# EAGLE schematic HFT-Core-Module_1V1 (EAGLE 7.7.0), part 1 of 2
Assembly variants: BAT-Charger_by_MCU

## Sheet 1 of 37: MCU
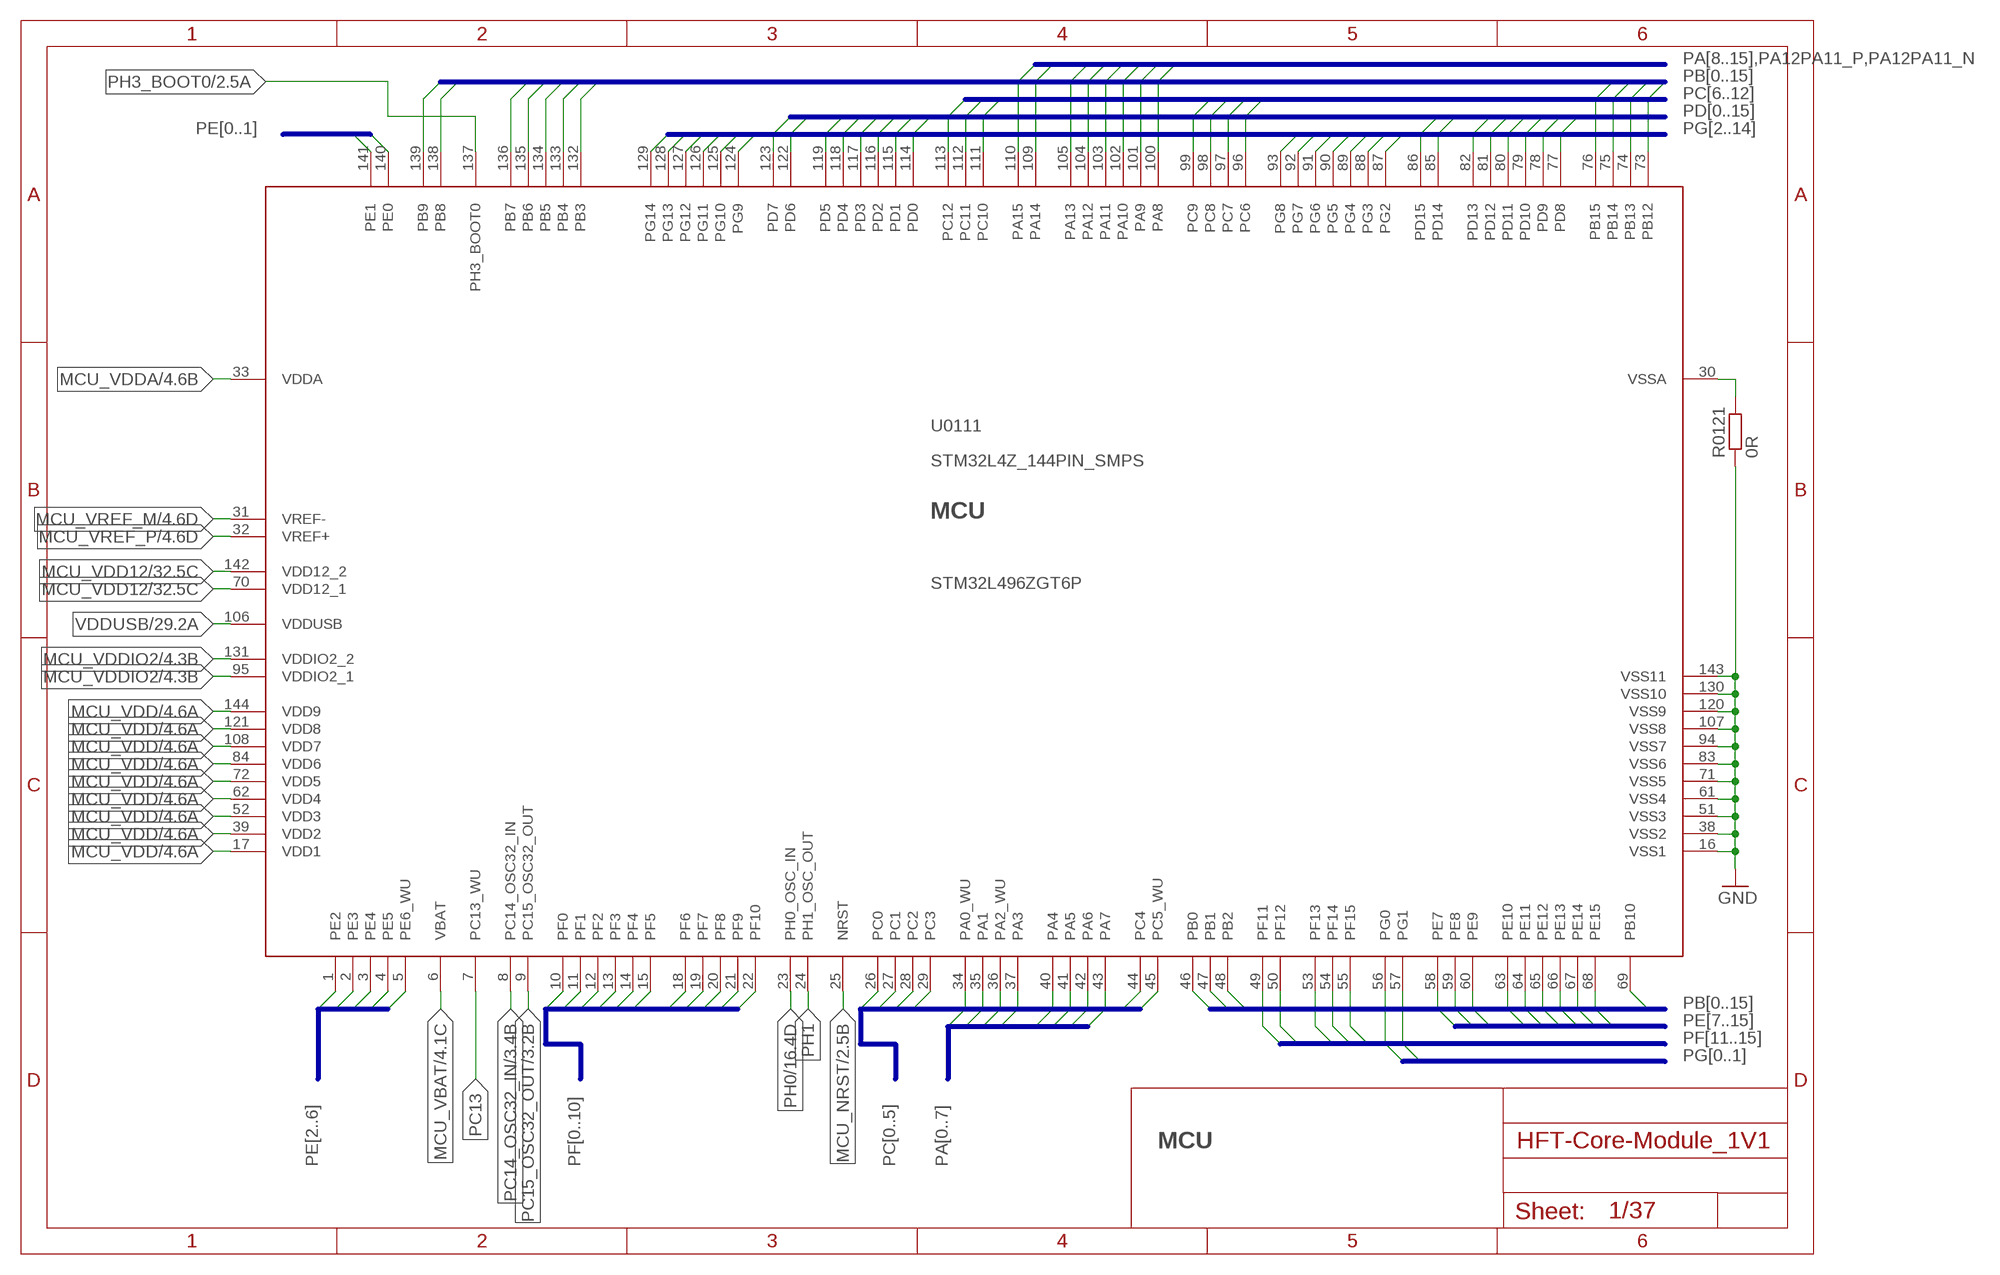
[diagram p0: schematic, sheet 1]

### Parts
R0121  0R  R-EU_R0402  [R0402]
U0111  STM32L4Z_144PIN_SMPS  [LQFP144]

### Nets
GND: R0121.1 U0111.16(VSS1) U0111.38(VSS2) U0111.51(VSS3) U0111.61(VSS4) U0111.71(VSS5) U0111.83(VSS6) U0111.94(VSS7) U0111.107(VSS8) U0111.120(VSS9) U0111.130(VSS10) U0111.143(VSS11) ; also sheet 2,3,4,5,6,7,8,9,10,11,12,13,14,15,16,17,18,19,21,22,23,24,25,26,27,28,29,30,31,32,33,34,35,36,37
MCU_NRST: U0111.25(NRST) ; also sheet 2
MCU_VBAT: U0111.6(VBAT) ; also sheet 4,19
MCU_VDD: U0111.17(VDD1) U0111.39(VDD2) U0111.52(VDD3) U0111.62(VDD4) U0111.72(VDD5) U0111.84(VDD6) U0111.108(VDD7) U0111.121(VDD8) U0111.144(VDD9) ; also sheet 4
MCU_VDD12: U0111.70(VDD12_1) U0111.142(VDD12_2) ; also sheet 32
MCU_VDDA: U0111.33(VDDA) ; also sheet 4
MCU_VDDIO2: U0111.95(VDDIO2_1) U0111.131(VDDIO2_2) ; also sheet 4
MCU_VREF_M: U0111.31(VREF-) ; also sheet 4
MCU_VREF_P: U0111.32(VREF+) ; also sheet 4
MCU_VSSA: R0121.2 U0111.30(VSSA)
PA0: U0111.34(PA0_WU) ; also sheet 26
PA1: U0111.35(PA1) ; also sheet 15
PA2: U0111.36(PA2_WU) ; also sheet 21
PA3: U0111.37(PA3) ; also sheet 25
PA4: U0111.40(PA4)
PA5: U0111.41(PA5) ; also sheet 25
PA6: U0111.42(PA6) ; also sheet 20
PA7: U0111.43(PA7) ; also sheet 11
PA8: U0111.100(PA8) ; also sheet 16
PA9: U0111.101(PA9) ; also sheet 33
PA10: U0111.102(PA10) ; also sheet 33
PA12PA11_N [usb_pair]: U0111.103(PA11) ; also sheet 33
PA12PA11_P [usb_pair]: U0111.104(PA12) ; also sheet 33
PA13: U0111.105(PA13) ; also sheet 2
PA14: U0111.109(PA14) ; also sheet 2
PA15: U0111.110(PA15)
PB0: U0111.46(PB0) ; also sheet 11
PB1: U0111.47(PB1) ; also sheet 21
PB2: U0111.48(PB2)
PB3: U0111.132(PB3) ; also sheet 36
PB4: U0111.133(PB4)
PB5: U0111.134(PB5) ; also sheet 36
PB6: U0111.135(PB6) ; also sheet 36
PB7: U0111.136(PB7) ; also sheet 36
PB8: U0111.138(PB8)
PB9: U0111.139(PB9)
PB10: U0111.69(PB10)
PB12: U0111.73(PB12)
PB13: U0111.74(PB13) ; also sheet 17,36
PB14: U0111.75(PB14)
PB15: U0111.76(PB15) ; also sheet 36
PC0: U0111.26(PC0) ; also sheet 20
PC1: U0111.27(PC1) ; also sheet 7
PC2: U0111.28(PC2) ; also sheet 7
PC3: U0111.29(PC3) ; also sheet 7
PC4: U0111.44(PC4)
PC5: U0111.45(PC5_WU) ; also sheet 13
PC6: U0111.96(PC6) ; also sheet 11
PC7: U0111.97(PC7) ; also sheet 20
PC8: U0111.98(PC8) ; also sheet 9
PC9: U0111.99(PC9) ; also sheet 16
PC10: U0111.111(PC10) ; also sheet 9
PC11: U0111.112(PC11) ; also sheet 13,22,23
PC12: U0111.113(PC12) ; also sheet 9
PC13: U0111.7(PC13_WU) ; also sheet 36
PC14_OSC32_IN: U0111.8(PC14_OSC32_IN) ; also sheet 3
PC15_OSC32_OUT: U0111.9(PC15_OSC32_OUT) ; also sheet 3
PD0: U0111.114(PD0)
PD1: U0111.115(PD1) ; also sheet 36
PD2: U0111.116(PD2) ; also sheet 17
PD3: U0111.117(PD3) ; also sheet 36
PD4: U0111.118(PD4)
PD5: U0111.119(PD5)
PD6: U0111.122(PD6)
PD7: U0111.123(PD7) ; also sheet 7
PD8: U0111.77(PD8) ; also sheet 22
PD9: U0111.78(PD9) ; also sheet 36
PD10: U0111.79(PD10) ; also sheet 36
PD11: U0111.80(PD11) ; also sheet 17,36
PD12: U0111.81(PD12) ; also sheet 17,36
PD13: U0111.82(PD13)
PD14: U0111.85(PD14) ; also sheet 36
PD15: U0111.86(PD15) ; also sheet 36
PE0: U0111.140(PE0)
PE1: U0111.141(PE1)
PE2: U0111.1(PE2)
PE3: U0111.2(PE3) ; also sheet 18,36
PE4: U0111.3(PE4) ; also sheet 26
PE5: U0111.4(PE5) ; also sheet 27
PE6: U0111.5(PE6_WU) ; also sheet 10
PE7: U0111.58(PE7) ; also sheet 23
PE8: U0111.59(PE8) ; also sheet 18,36
PE9: U0111.60(PE9) ; also sheet 18,36
PE10: U0111.63(PE10) ; also sheet 18,36
PE11: U0111.64(PE11) ; also sheet 7
PE12: U0111.65(PE12) ; also sheet 7
PE13: U0111.66(PE13) ; also sheet 7
PE14: U0111.67(PE14) ; also sheet 7
PE15: U0111.68(PE15) ; also sheet 7
PF0: U0111.10(PF0) ; also sheet 36
PF1: U0111.11(PF1) ; also sheet 36
PF2: U0111.12(PF2)
PF3: U0111.13(PF3) ; also sheet 5
PF4: U0111.14(PF4) ; also sheet 6
PF5: U0111.15(PF5) ; also sheet 29
PF6: U0111.18(PF6) ; also sheet 36
PF7: U0111.19(PF7) ; also sheet 26
PF8: U0111.20(PF8) ; also sheet 36
PF9: U0111.21(PF9) ; also sheet 20
PF10: U0111.22(PF10) ; also sheet 7
PF11: U0111.49(PF11) ; also sheet 13
PF12: U0111.50(PF12) ; also sheet 22
PF13: U0111.53(PF13) ; also sheet 13
PF14: U0111.54(PF14) ; also sheet 23
PF15: U0111.55(PF15) ; also sheet 22
PG0: U0111.56(PG0) ; also sheet 22
PG1: U0111.57(PG1) ; also sheet 22
PG2: U0111.87(PG2)
PG3: U0111.88(PG3) ; also sheet 9
PG4: U0111.89(PG4) ; also sheet 36
PG5: U0111.90(PG5) ; also sheet 9
PG6: U0111.91(PG6) ; also sheet 20
PG7: U0111.92(PG7) ; also sheet 21
PG8: U0111.93(PG8) ; also sheet 20
PG9: U0111.124(PG9) ; also sheet 36
PG10: U0111.125(PG10) ; also sheet 36
PG11: U0111.126(PG11) ; also sheet 36
PG12: U0111.127(PG12) ; also sheet 36
PG13: U0111.128(PG13) ; also sheet 8
PG14: U0111.129(PG14) ; also sheet 8
PH0: U0111.23(PH0_OSC_IN) ; also sheet 16
PH1: U0111.24(PH1_OSC_OUT)
PH3_BOOT0: U0111.137(PH3_BOOT0) ; also sheet 2
VDDUSB: U0111.106(VDDUSB) ; also sheet 29,33

### Buses
PF[0..10]
PE[2..6]
PC[0..5]
PA[0..7]
PE[7..15]
PF[11..15]
PG[0..1]
PB[0..15]
PA[8..15],PA12PA11_P,PA12PA11_N
PC[6..12]
PD[0..15]
PE[0..1]
PG[2..14]

### Notes on the sheet
- MCU
- STM32L496ZGT6P
- MCU

## Sheet 2 of 37: MCU Debug
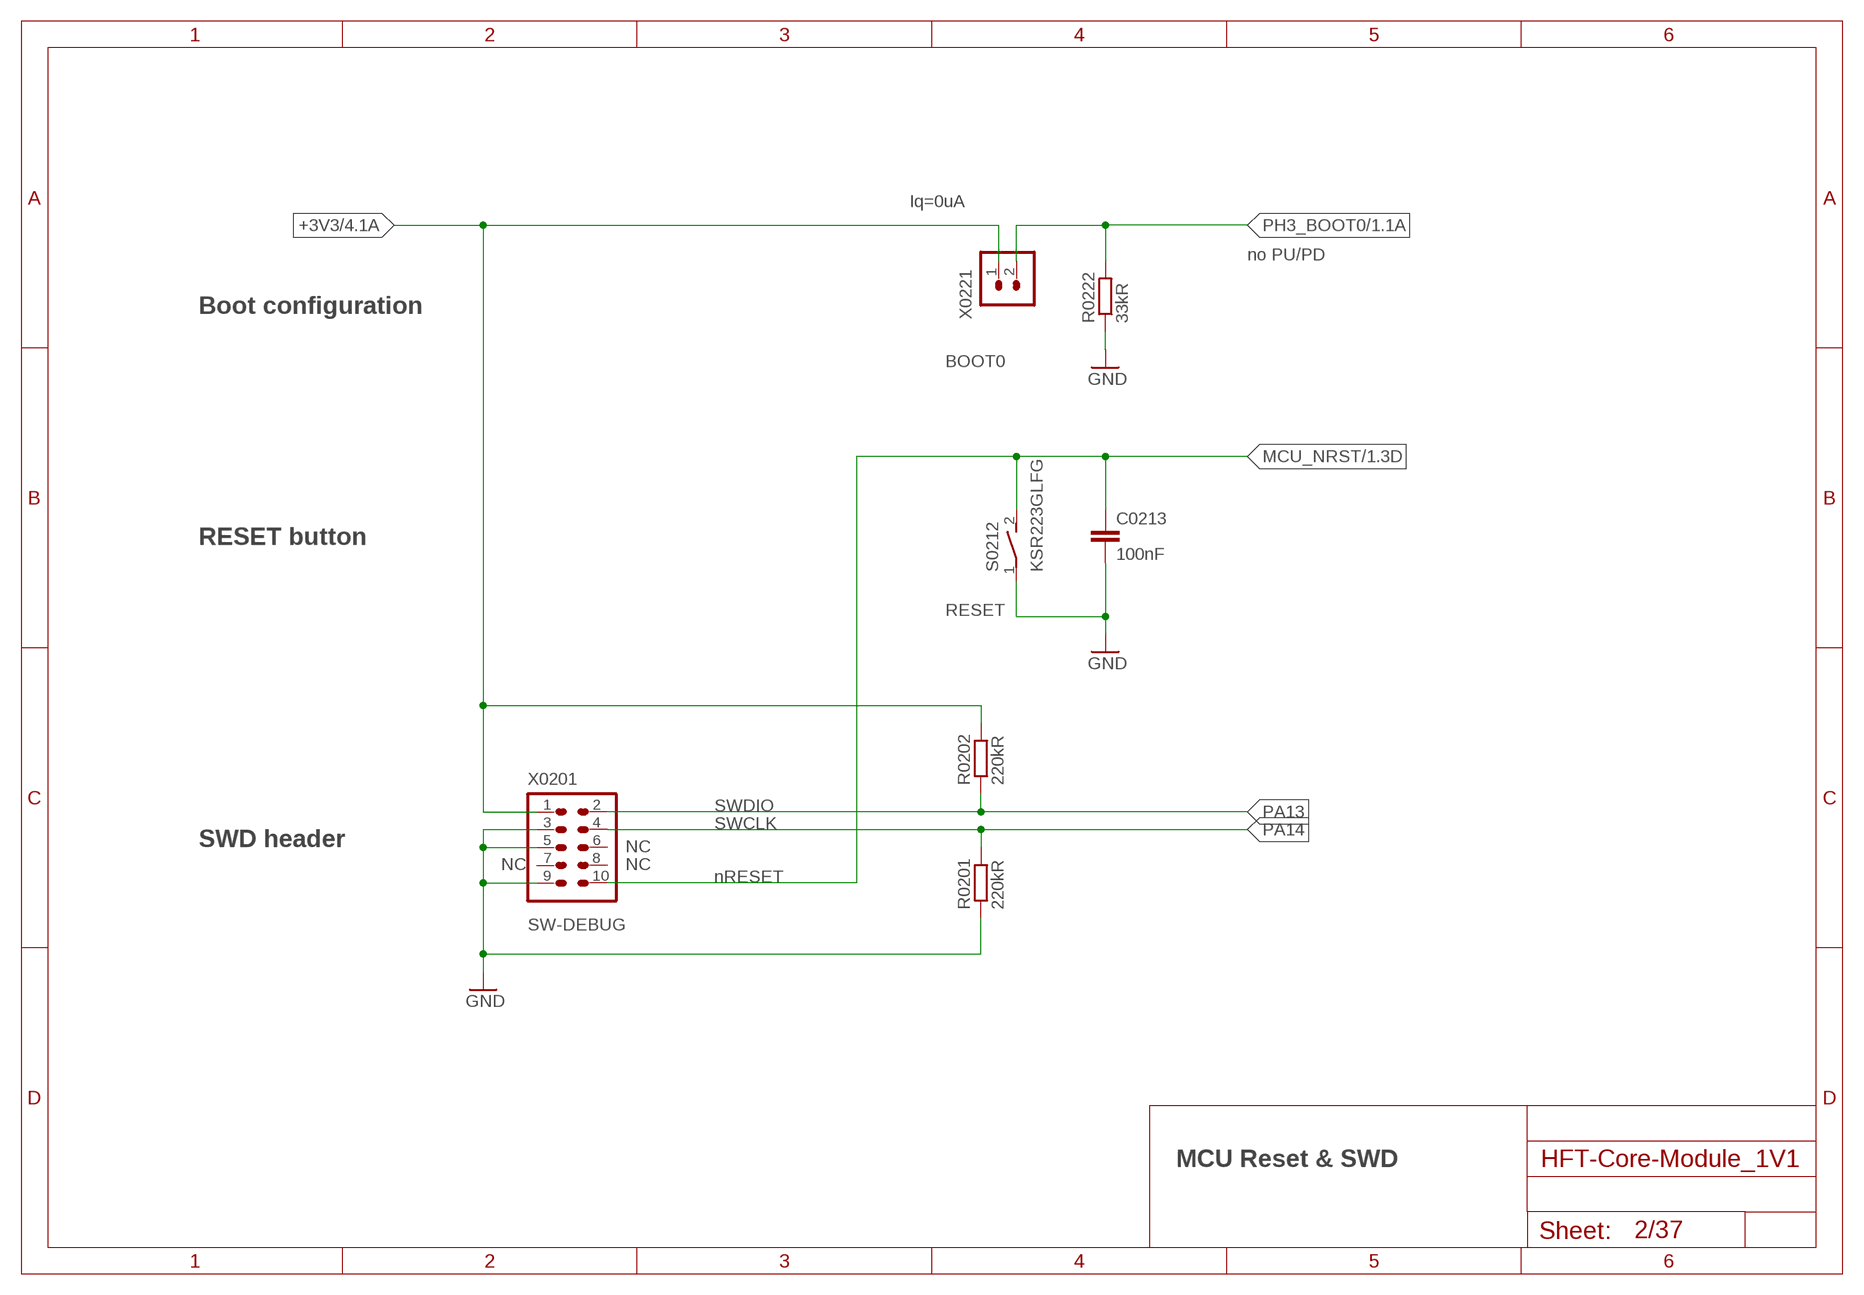
[diagram p1: schematic, sheet 2]

### Parts
C0213  100nF  C-EUC0402  [C0402]
R0201  220kR  R-EU_R0402  [R0402]
R0202  220kR  R-EU_R0402  [R0402]
R0222  33kR  R-EU_R0402  [R0402]
S0212  KSR223GLFG  KSR223G_SMD_1POL  [KSR223G_SMD_1POL]
X0201  2X05_1MM27_SHROUDED_CORTEX_JTAG_SWD"  [2X05_1MM27_SHROUDED_CORTEX_JTAG_SWD]
X0221  HEADER-1X2  [1X02]

### Nets
+3V3: R0202.2 X0201.1 X0221.1 ; also sheet 4,5,6,7,8,9,10,11,13,14,15,22,23,25,26,27,28,30,31,34,36
GND: C0213.2 R0201.1 R0222.1 S0212.1(P) X0201.3 X0201.5 X0201.9 ; also sheet 1,3,4,5,6,7,8,9,10,11,12,13,14,15,16,17,18,19,21,22,23,24,25,26,27,28,29,30,31,32,33,34,35,36,37
MCU_NRST: C0213.1 S0212.2(S) X0201.10 ; also sheet 1
PA13: R0202.1 X0201.2 ; also sheet 1
PA14: R0201.2 X0201.4 ; also sheet 1
PH3_BOOT0: R0222.2 X0221.2 ; also sheet 1
Unconnected: X0201.6 X0201.7 X0201.8

### Notes on the sheet
- Iq=0uA
- no PU/PD
- Boot configuration
- BOOT0
- RESET button
- RESET
- SWDIO
- SWCLK
- SWD header
- NC
- NC | NC
- nRESET
- SW-DEBUG
- MCU Reset & SWD

## Sheet 3 of 37: MCU LSE 32.768 kHz
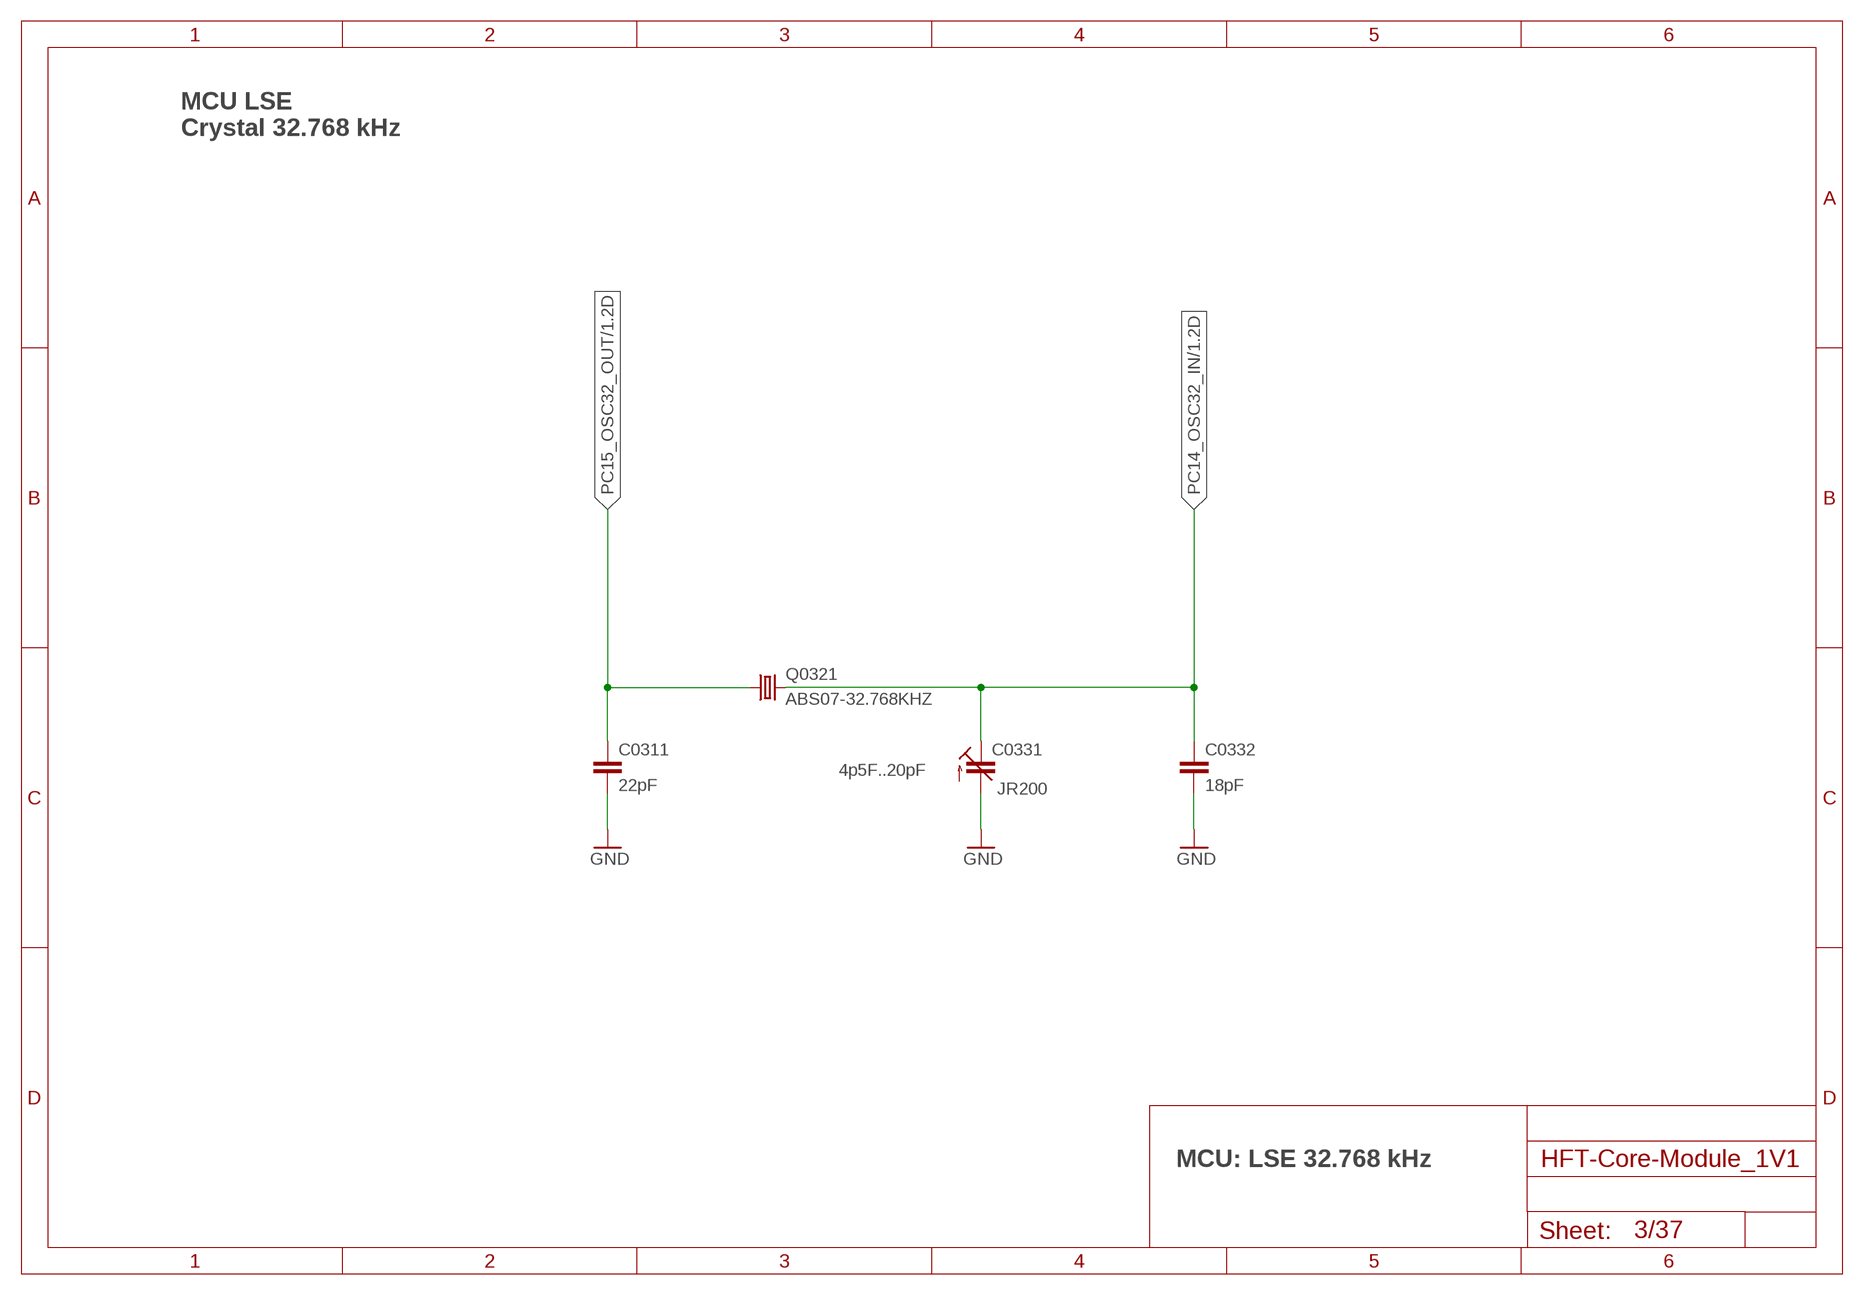
[diagram p2: schematic, sheet 3]

### Parts
C0311  22pF  C-EUC0402  [C0402]
C0331  JR200  C-TRIMM3MM2_2MM5  [3MM2_X_2MM5]
C0332  18pF  C-EUC0402  [C0402]
Q0321  ABS07-32.768KHZ  [ABS07]

### Nets
GND: C0311.2 C0331.+(A) C0332.2 ; also sheet 1,2,4,5,6,7,8,9,10,11,12,13,14,15,16,17,18,19,21,22,23,24,25,26,27,28,29,30,31,32,33,34,35,36,37
PC14_OSC32_IN: C0331.-(E) C0332.1 Q0321.2 ; also sheet 1
PC15_OSC32_OUT: C0311.1 Q0321.1 ; also sheet 1

### Notes on the sheet
- MCU LSE
  Crystal 32.768 kHz
- 4p5F..20pF
- MCU: LSE 32.768 kHz

## Sheet 4 of 37: MCU Power Distribution
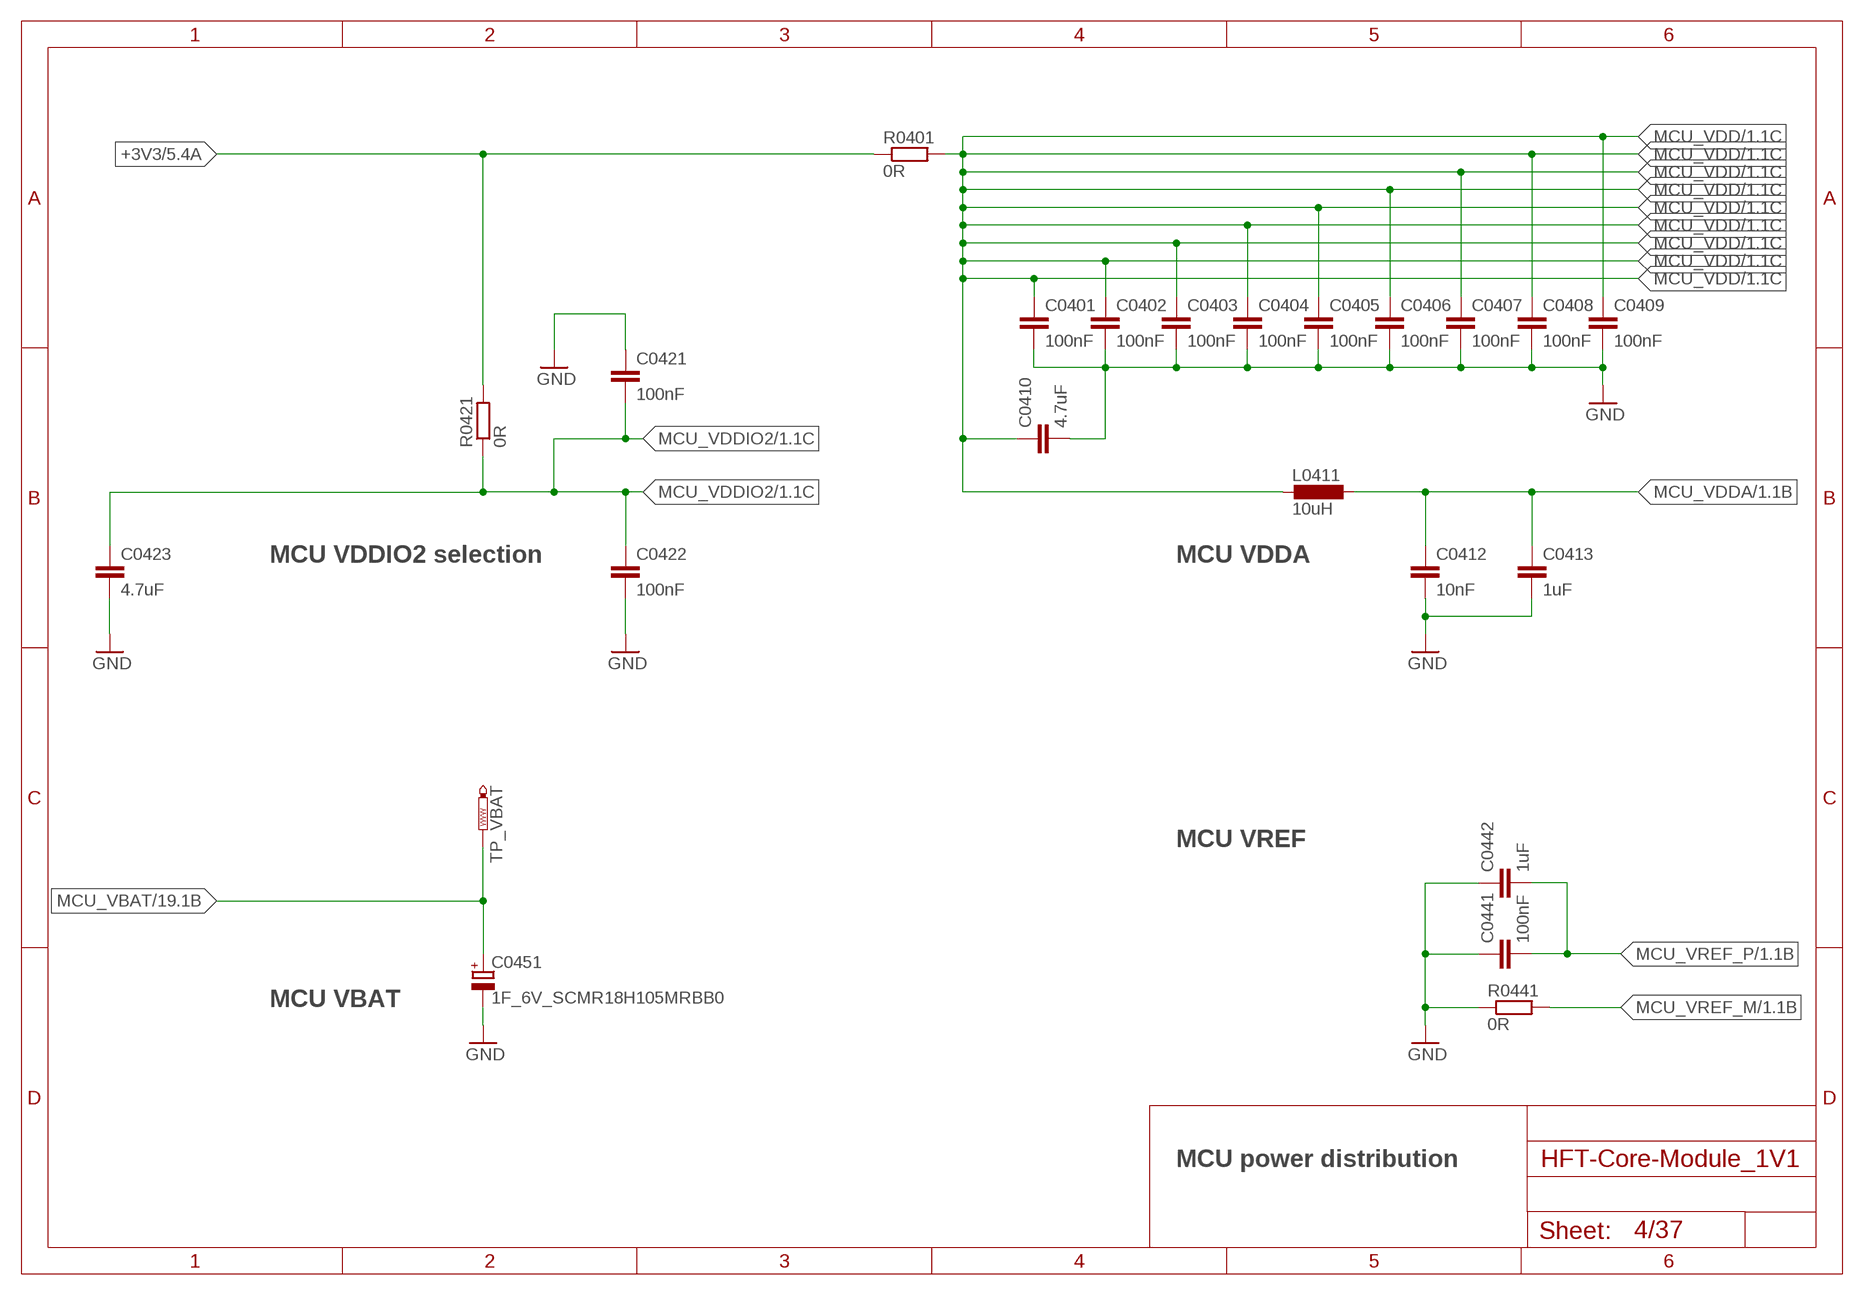
[diagram p3: schematic, sheet 4]

### Parts
C0401  100nF  C-EUC0402  [C0402]
C0402  100nF  C-EUC0402  [C0402]
C0403  100nF  C-EUC0402  [C0402]
C0404  100nF  C-EUC0402  [C0402]
C0405  100nF  C-EUC0402  [C0402]
C0406  100nF  C-EUC0402  [C0402]
C0407  100nF  C-EUC0402  [C0402]
C0408  100nF  C-EUC0402  [C0402]
C0409  100nF  C-EUC0402  [C0402]
C0410  4.7uF  C-EUC0402  [C0402]
C0412  10nF  C-EUC0402  [C0402]
C0413  1uF  C-EUC0402  [C0402]
C0421  100nF  C-EUC0402  [C0402]
C0422  100nF  C-EUC0402  [C0402]
C0423  4.7uF  C-EUC0402  [C0402]
C0441  100nF  C-EUC0402  [C0402]
C0442  1uF  C-EUC0402  [C0402]
C0451  1F_6V_SCMR18H105MRBB0  CPOL-EUC115-080X160_POL  [C115-080X160_POL]
L0411  10uH  L-EUL0603  [L0603]
R0401  0R  R-EU_R0402  [R0402]
R0421  0R  R-EU_R0402  [R0402]
R0441  0R  R-EU_R0402  [R0402]
TP_VBAT  PTR1B1,27  [B1,27]

### Nets
+3V3: R0401.1 R0421.2 ; also sheet 2,5,6,7,8,9,10,11,13,14,15,22,23,25,26,27,28,30,31,34,36
GND: C0401.2 C0402.2 C0403.2 C0404.2 C0405.2 C0406.2 C0407.2 C0408.2 C0409.2 C0410.2 C0412.2 C0413.2 C0421.1 C0422.2 C0423.2 C0441.1 C0442.1 C0451.- R0441.1 ; also sheet 1,2,3,5,6,7,8,9,10,11,12,13,14,15,16,17,18,19,21,22,23,24,25,26,27,28,29,30,31,32,33,34,35,36,37
MCU_VBAT: C0451.+ TP_VBAT.TP ; also sheet 1,19
MCU_VDD: C0401.1 C0402.1 C0403.1 C0404.1 C0405.1 C0406.1 C0407.1 C0408.1 C0409.1 C0410.1 L0411.1 R0401.2 ; also sheet 1
MCU_VDDA: C0412.1 C0413.1 L0411.2 ; also sheet 1
MCU_VDDIO2: C0421.2 C0422.1 C0423.1 R0421.1 ; also sheet 1
MCU_VREF_M: R0441.2 ; also sheet 1
MCU_VREF_P: C0441.2 C0442.2 ; also sheet 1

### Notes on the sheet
- MCU VDDIO2 selection | MCU VDDA
- MCU VREF
- MCU VBAT
- MCU power distribution

## Sheet 5 of 37: I2C1 - Port Expander-A
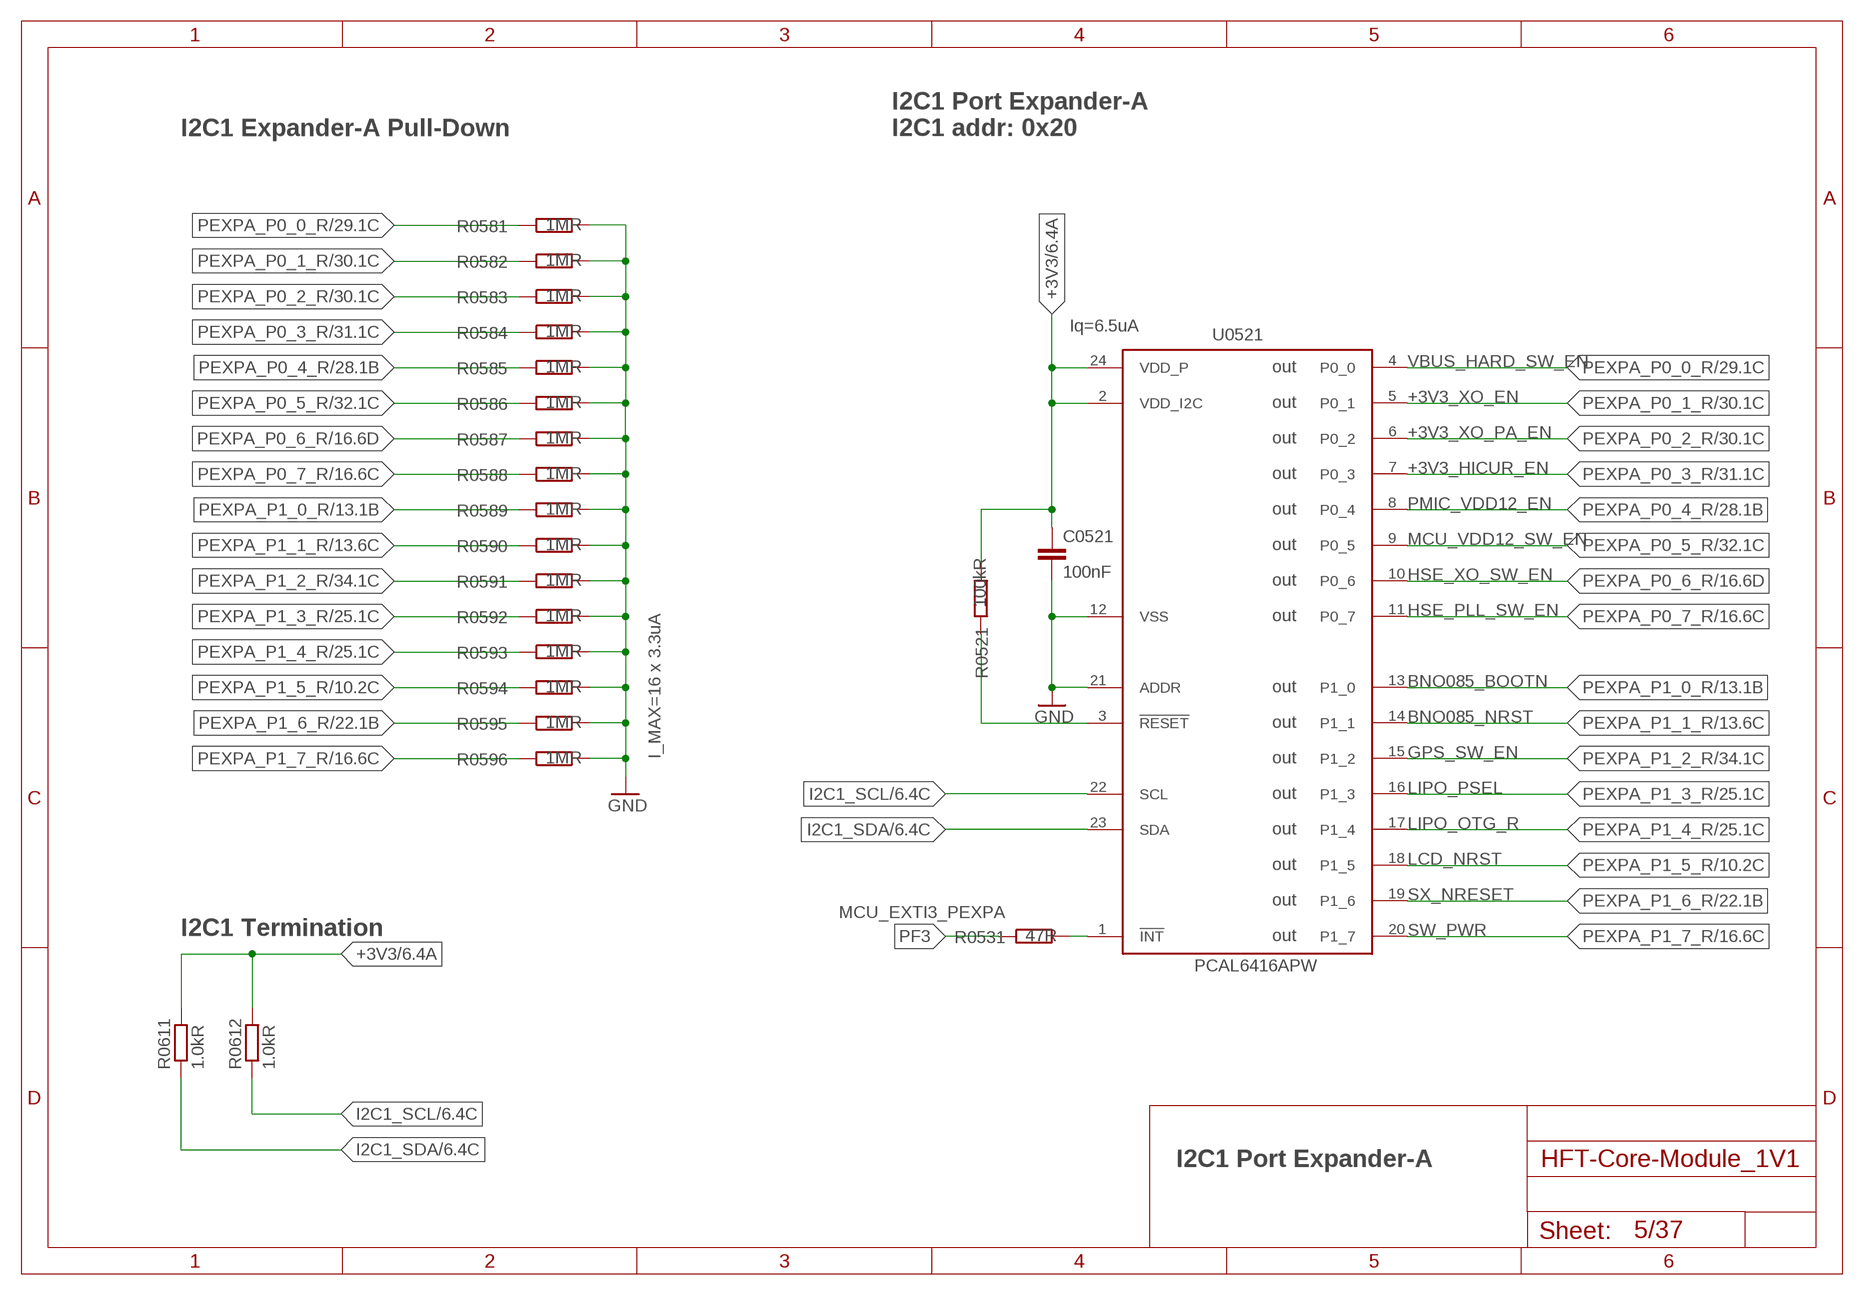
[diagram p4: schematic, sheet 5]

### Parts
C0521  100nF  C-EUC0402  [C0402]
R0521  100kR  R-EU_R0402  [R0402]
R0531  47R  R-EU_R0402  [R0402]
R0581  1MR  R-EU_R0402  [R0402]
R0582  1MR  R-EU_R0402  [R0402]
R0583  1MR  R-EU_R0402  [R0402]
R0584  1MR  R-EU_R0402  [R0402]
R0585  1MR  R-EU_R0402  [R0402]
R0586  1MR  R-EU_R0402  [R0402]
R0587  1MR  R-EU_R0402  [R0402]
R0588  1MR  R-EU_R0402  [R0402]
R0589  1MR  R-EU_R0402  [R0402]
R0590  1MR  R-EU_R0402  [R0402]
R0591  1MR  R-EU_R0402  [R0402]
R0592  1MR  R-EU_R0402  [R0402]
R0593  1MR  R-EU_R0402  [R0402]
R0594  1MR  R-EU_R0402  [R0402]
R0595  1MR  R-EU_R0402  [R0402]
R0596  1MR  R-EU_R0402  [R0402]
R0611  1.0kR  R-EU_R0402  [R0402]
R0612  1.0kR  R-EU_R0402  [R0402]
U0521  PCAL6416APW  [TSSOP24_SOT355-1]

### Nets
+3V3: C0521.1 R0521.2 R0611.2 R0612.2 U0521.2(VDD_I2C) U0521.24(VDD_P) ; also sheet 2,4,6,7,8,9,10,11,13,14,15,22,23,25,26,27,28,30,31,34,36
GND: C0521.2 R0581.2 R0582.2 R0583.2 R0584.2 R0585.2 R0586.2 R0587.2 R0588.2 R0589.2 R0590.2 R0591.2 R0592.2 R0593.2 R0594.2 R0595.2 R0596.2 U0521.12(VSS) U0521.21(ADDR) ; also sheet 1,2,3,4,6,7,8,9,10,11,12,13,14,15,16,17,18,19,21,22,23,24,25,26,27,28,29,30,31,32,33,34,35,36,37
I2C1_SCL: R0612.1 U0521.22(SCL) ; also sheet 6,8,10,14,15,16,17,18,25
I2C1_SDA: R0611.1 U0521.23(SDA) ; also sheet 6,8,10,14,15,16,17,18,25
PEXPA_INTN: R0531.2 U0521.1(!INT)
PEXPA_P0_0_R: R0581.1 U0521.4(P0_0) ; also sheet 29
PEXPA_P0_1_R: R0582.1 U0521.5(P0_1) ; also sheet 30
PEXPA_P0_2_R: R0583.1 U0521.6(P0_2) ; also sheet 30
PEXPA_P0_3_R: R0584.1 U0521.7(P0_3) ; also sheet 31
PEXPA_P0_4_R: R0585.1 U0521.8(P0_4) ; also sheet 28
PEXPA_P0_5_R: R0586.1 U0521.9(P0_5) ; also sheet 32
PEXPA_P0_6_R: R0587.1 U0521.10(P0_6) ; also sheet 16
PEXPA_P0_7_R: R0588.1 U0521.11(P0_7) ; also sheet 16
PEXPA_P1_0_R: R0589.1 U0521.13(P1_0) ; also sheet 13
PEXPA_P1_1_R: R0590.1 U0521.14(P1_1) ; also sheet 13
PEXPA_P1_2_R: R0591.1 U0521.15(P1_2) ; also sheet 34
PEXPA_P1_3_R: R0592.1 U0521.16(P1_3) ; also sheet 25
PEXPA_P1_4_R: R0593.1 U0521.17(P1_4) ; also sheet 25
PEXPA_P1_5_R: R0594.1 U0521.18(P1_5) ; also sheet 10
PEXPA_P1_6_R: R0595.1 U0521.19(P1_6) ; also sheet 22
PEXPA_P1_7_R: R0596.1 U0521.20(P1_7) ; also sheet 16,30,31,32,34
PEXPA_RESET: R0521.1 U0521.3(!RESET)
PF3: R0531.1 ; also sheet 1

### Notes on the sheet
- I2C1 Expander-A Pull-Down
- I2C1 Port Expander-A
  I2C1 addr: 0x20
- Iq=6.5uA
- VBUS_HARD_SW_EN
- out
- +3V3_XO_EN
- out
- +3V3_XO_PA_EN
- out
- +3V3_HICUR_EN
- out
- PMIC_VDD12_EN
- out
- MCU_VDD12_SW_EN
- out
- HSE_XO_SW_EN
- out
- HSE_PLL_SW_EN
- out
- BNO085_BOOTN
- out
- BNO085_NRST
- out
- I_MAX=16 x 3.3uA | GPS_SW_EN
- out
- LIPO_PSEL
- out
- LIPO_OTG_R
- out
- LCD_NRST
- out
- SX_NRESET
- out
- MCU_EXTI3_PEXPA
- I2C1 Termination | SW_PWR
- out
- I2C1 Port Expander-A

## Sheet 6 of 37: I2C1 - Port Expander-B
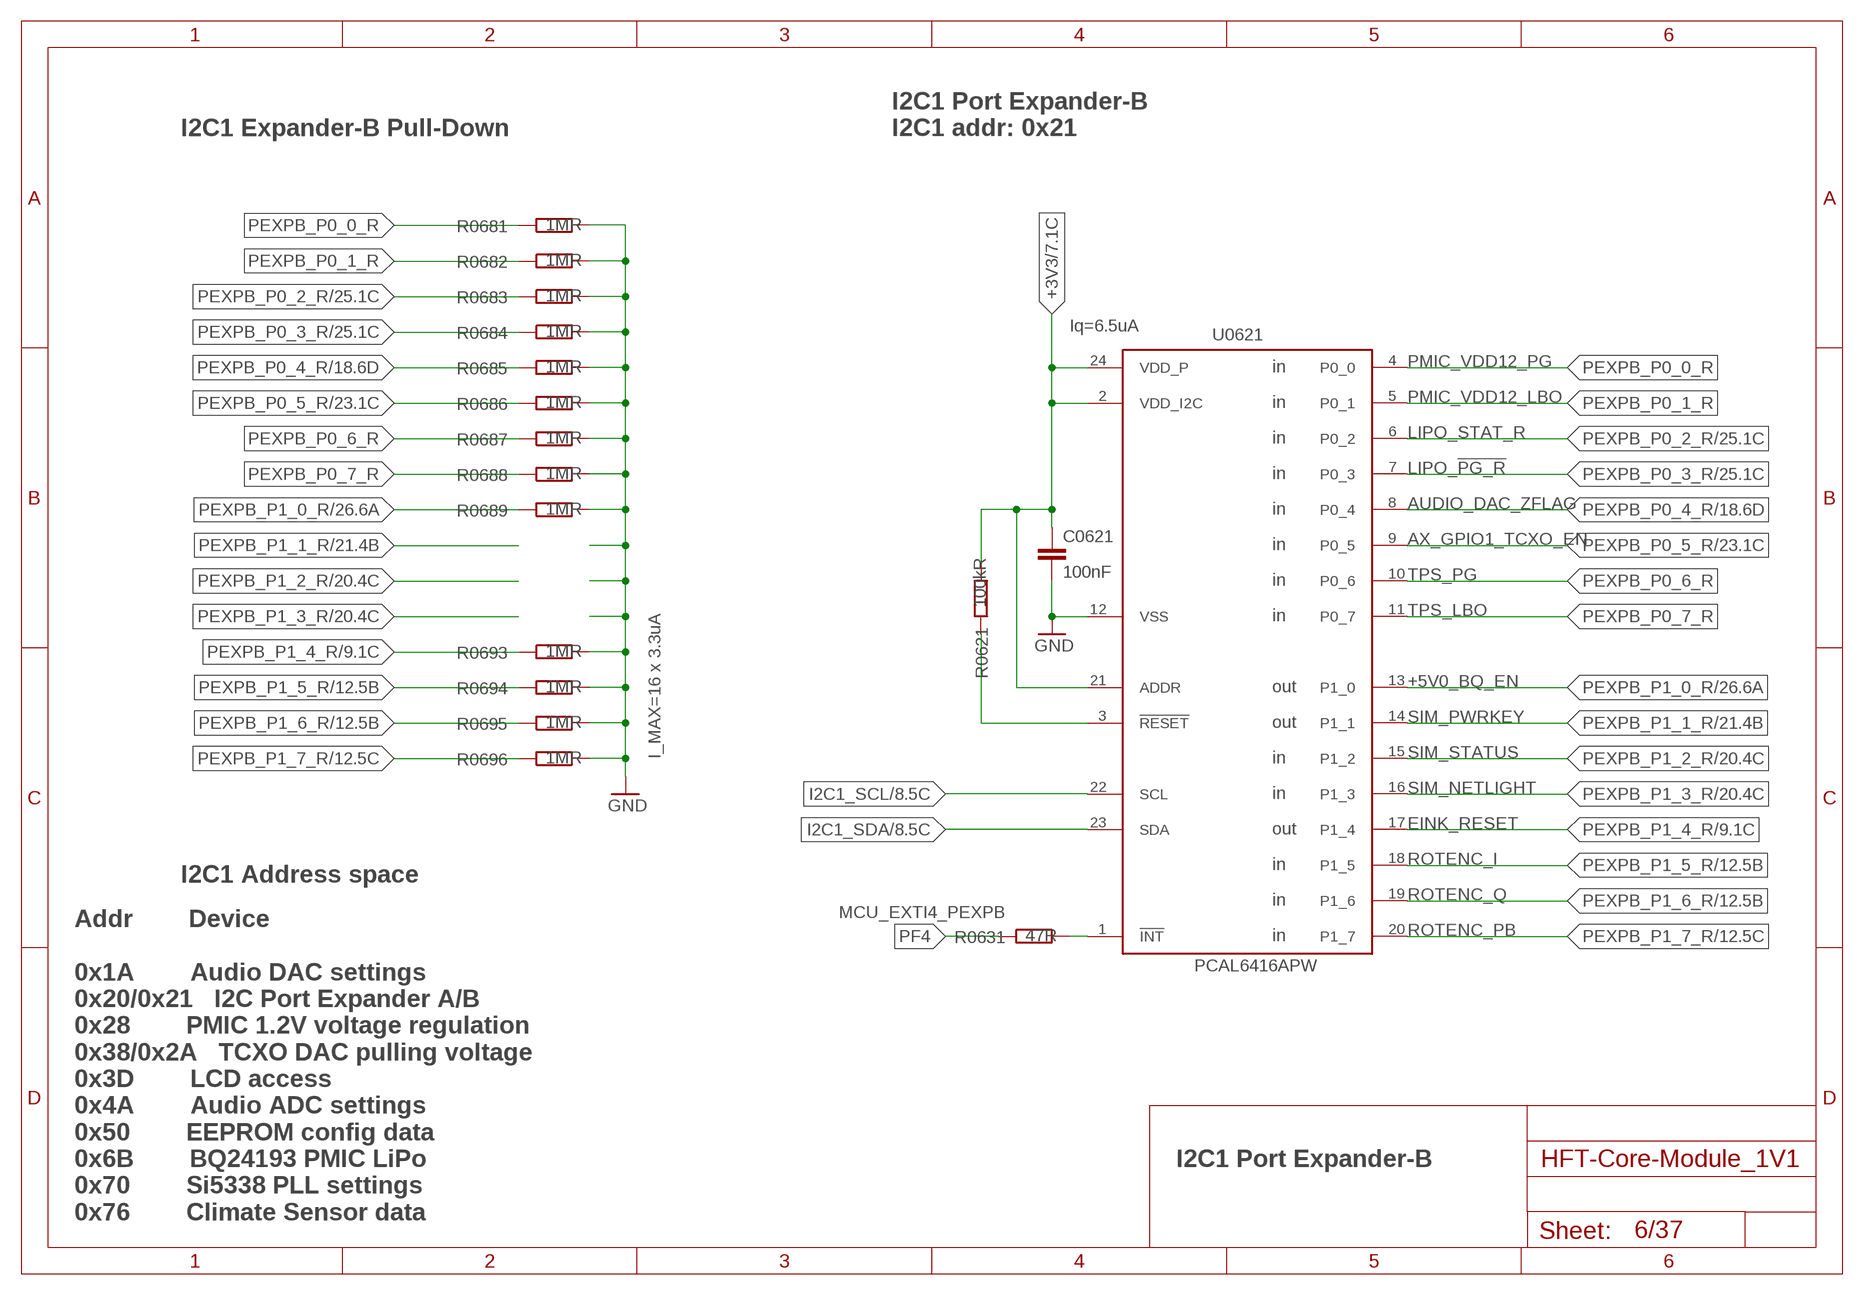
[diagram p5: schematic, sheet 6]

### Parts
C0621  100nF  C-EUC0402  [C0402]
R0621  100kR  R-EU_R0402  [R0402]
R0631  47R  R-EU_R0402  [R0402]
R0681  1MR  R-EU_R0402  [R0402]
R0682  1MR  R-EU_R0402  [R0402]
R0683  1MR  R-EU_R0402  [R0402]
R0684  1MR  R-EU_R0402  [R0402]
R0685  1MR  R-EU_R0402  [R0402]
R0686  1MR  R-EU_R0402  [R0402]
R0687  1MR  R-EU_R0402  [R0402]
R0688  1MR  R-EU_R0402  [R0402]
R0689  1MR  R-EU_R0402  [R0402]
R0693  1MR  R-EU_R0402  [R0402]
R0694  1MR  R-EU_R0402  [R0402]
R0695  1MR  R-EU_R0402  [R0402]
R0696  1MR  R-EU_R0402  [R0402]
U0621  PCAL6416APW  [TSSOP24_SOT355-1]

### Nets
+3V3: C0621.1 R0621.2 U0621.2(VDD_I2C) U0621.21(ADDR) U0621.24(VDD_P) ; also sheet 2,4,5,7,8,9,10,11,13,14,15,22,23,25,26,27,28,30,31,34,36
GND: C0621.2 R0681.2 R0682.2 R0683.2 R0684.2 R0685.2 R0686.2 R0687.2 R0688.2 R0689.2 R0693.2 R0694.2 R0695.2 R0696.2 U0621.12(VSS) ; also sheet 1,2,3,4,5,7,8,9,10,11,12,13,14,15,16,17,18,19,21,22,23,24,25,26,27,28,29,30,31,32,33,34,35,36,37
I2C1_SCL: U0621.22(SCL) ; also sheet 5,8,10,14,15,16,17,18,25
I2C1_SDA: U0621.23(SDA) ; also sheet 5,8,10,14,15,16,17,18,25
PEXPB_INTN: R0631.2 U0621.1(!INT)
PEXPB_P0_0_R: R0681.1 U0621.4(P0_0)
PEXPB_P0_1_R: R0682.1 U0621.5(P0_1)
PEXPB_P0_2_R: R0683.1 U0621.6(P0_2) ; also sheet 25
PEXPB_P0_3_R: R0684.1 U0621.7(P0_3) ; also sheet 25
PEXPB_P0_4_R: R0685.1 U0621.8(P0_4) ; also sheet 18
PEXPB_P0_5_R: R0686.1 U0621.9(P0_5) ; also sheet 23
PEXPB_P0_6_R: R0687.1 U0621.10(P0_6)
PEXPB_P0_7_R: R0688.1 U0621.11(P0_7)
PEXPB_P1_0_R: R0689.1 U0621.13(P1_0) ; also sheet 26
PEXPB_P1_1_R: U0621.14(P1_1) ; also sheet 21
PEXPB_P1_2_R: U0621.15(P1_2) ; also sheet 20
PEXPB_P1_3_R: U0621.16(P1_3) ; also sheet 20
PEXPB_P1_4_R: R0693.1 U0621.17(P1_4) ; also sheet 9
PEXPB_P1_5_R: R0694.1 U0621.18(P1_5) ; also sheet 12
PEXPB_P1_6_R: R0695.1 U0621.19(P1_6) ; also sheet 12
PEXPB_P1_7_R: R0696.1 U0621.20(P1_7) ; also sheet 12
PEXPB_RESET: R0621.1 U0621.3(!RESET)
PF4: R0631.1 ; also sheet 1

### Notes on the sheet
- I2C1 Expander-B Pull-Down
- I2C1 Port Expander-B
  I2C1 addr: 0x21
- Iq=6.5uA
- PMIC_VDD12_PG
- in
- PMIC_VDD12_LBO
- in
- LIPO_STAT_R
- in
- LIPO_!PG_R
- in
- AUDIO_DAC_ZFLAG
- in
- AX_GPIO1_TCXO_EN
- in
- TPS_PG
- in
- TPS_LBO
- in
- +5V0_BQ_EN
- out
- SIM_PWRKEY
- out
- I_MAX=16 x 3.3uA | SIM_STATUS
- in
- SIM_NETLIGHT
- in
- EINK_RESET
- out
- ROTENC_I
- in
- I2C1 Address space
- ROTENC_Q
- in
- MCU_EXTI4_PEXPB
- ROTENC_PB
- in
- I2C1 Port Expander-B
- Addr        Device
  
  0x1A        Audio DAC settings
  0x20/0x21   I2C Port Expander A/B
  0x28        PMIC 1.2V voltage regulation
  0x38/0x2A   TCXO DAC pulling voltage
  0x3D        LCD access
  0x4A        Audio ADC settings
  0x50        EEPROM config data
  0x6B        BQ24193 PMIC LiPo
  0x70        Si5338 PLL settings
  0x76        Climate Sensor data

## Sheet 7 of 37: SPIQ - MCU FLASH
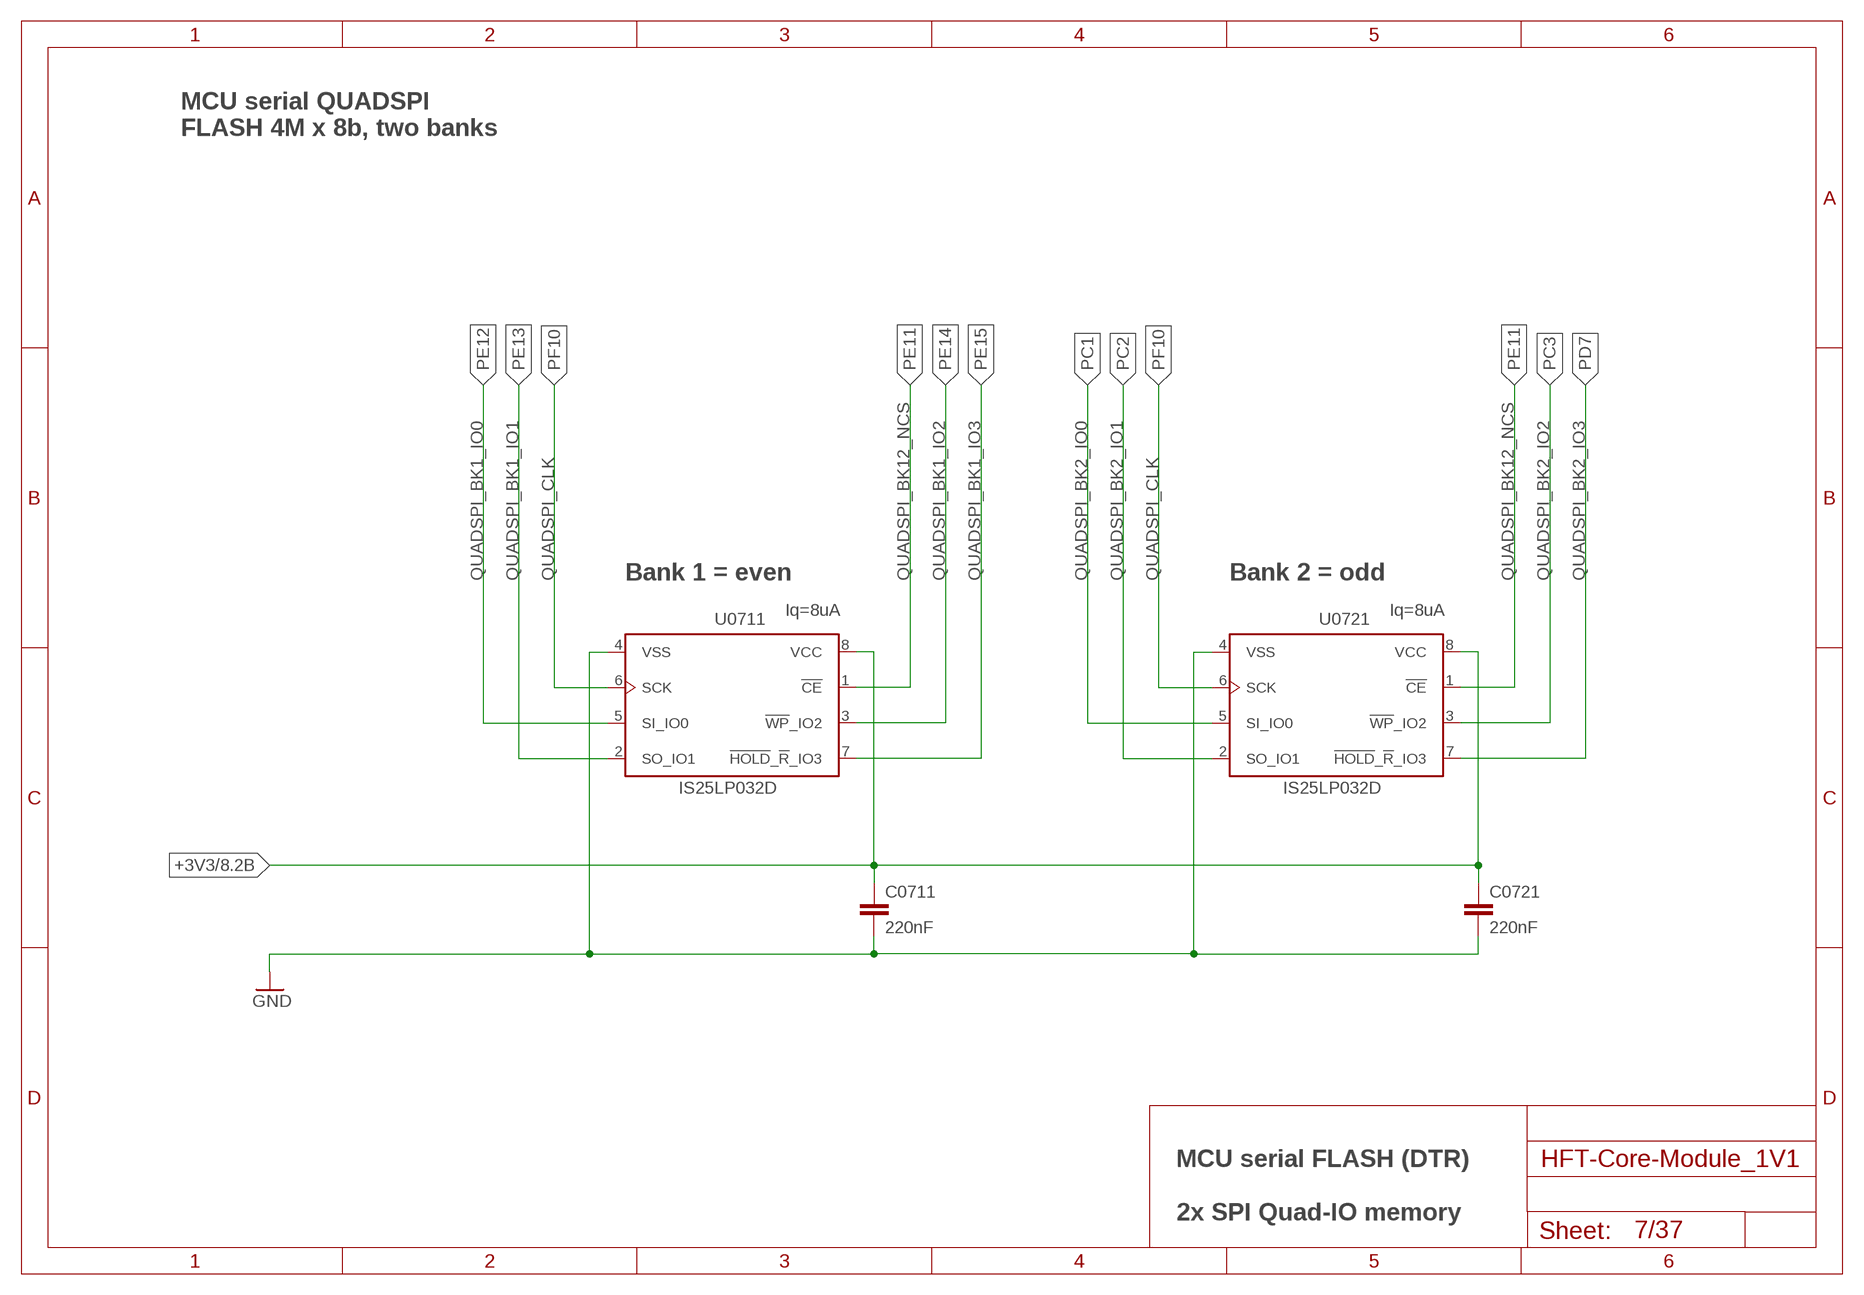
[diagram p6: schematic, sheet 7]

### Parts
C0711  220nF  C-EUC0402  [C0402]
C0721  220nF  C-EUC0402  [C0402]
U0711  IS25LP032D  [SOIC8_150MIL]
U0721  IS25LP032D  [SOIC8_150MIL]

### Nets
+3V3: C0711.1 C0721.1 U0711.8(VCC) U0721.8(VCC) ; also sheet 2,4,5,6,8,9,10,11,13,14,15,22,23,25,26,27,28,30,31,34,36
GND: C0711.2 C0721.2 U0711.4(VSS) U0721.4(VSS) ; also sheet 1,2,3,4,5,6,8,9,10,11,12,13,14,15,16,17,18,19,21,22,23,24,25,26,27,28,29,30,31,32,33,34,35,36,37
PC1: U0721.5(SI_IO0) ; also sheet 1
PC2: U0721.2(SO_IO1) ; also sheet 1
PC3: U0721.3(!WP!_IO2) ; also sheet 1
PD7: U0721.7(!HOLD!_!R!_IO3) ; also sheet 1
PE11: U0711.1(!CE) U0721.1(!CE) ; also sheet 1
PE12: U0711.5(SI_IO0) ; also sheet 1
PE13: U0711.2(SO_IO1) ; also sheet 1
PE14: U0711.3(!WP!_IO2) ; also sheet 1
PE15: U0711.7(!HOLD!_!R!_IO3) ; also sheet 1
PF10: U0711.6(SCK) U0721.6(SCK) ; also sheet 1

### Notes on the sheet
- MCU serial QUADSPI
  FLASH 4M x 8b, two banks
- QUADSPI_BK1_IO0 | QUADSPI_BK1_IO1 | QUADSPI_CLK | Bank 1 = even | QUADSPI_BK12_NCS | QUADSPI_BK1_IO2 | QUADSPI_BK1_IO3 | QUADSPI_BK2_IO0 | QUADSPI_BK2_IO1 | QUADSPI_CLK | Bank 2 = odd | QUADSPI_BK12_NCS | QUADSPI_BK2_IO2 | QUADSPI_BK2_IO3
- Iq=8uA | Iq=8uA
- MCU serial FLASH (DTR)
  
  2x SPI Quad-IO memory

## Sheet 8 of 37: I2C1 - MCU EEPROM 8k x 8Bit
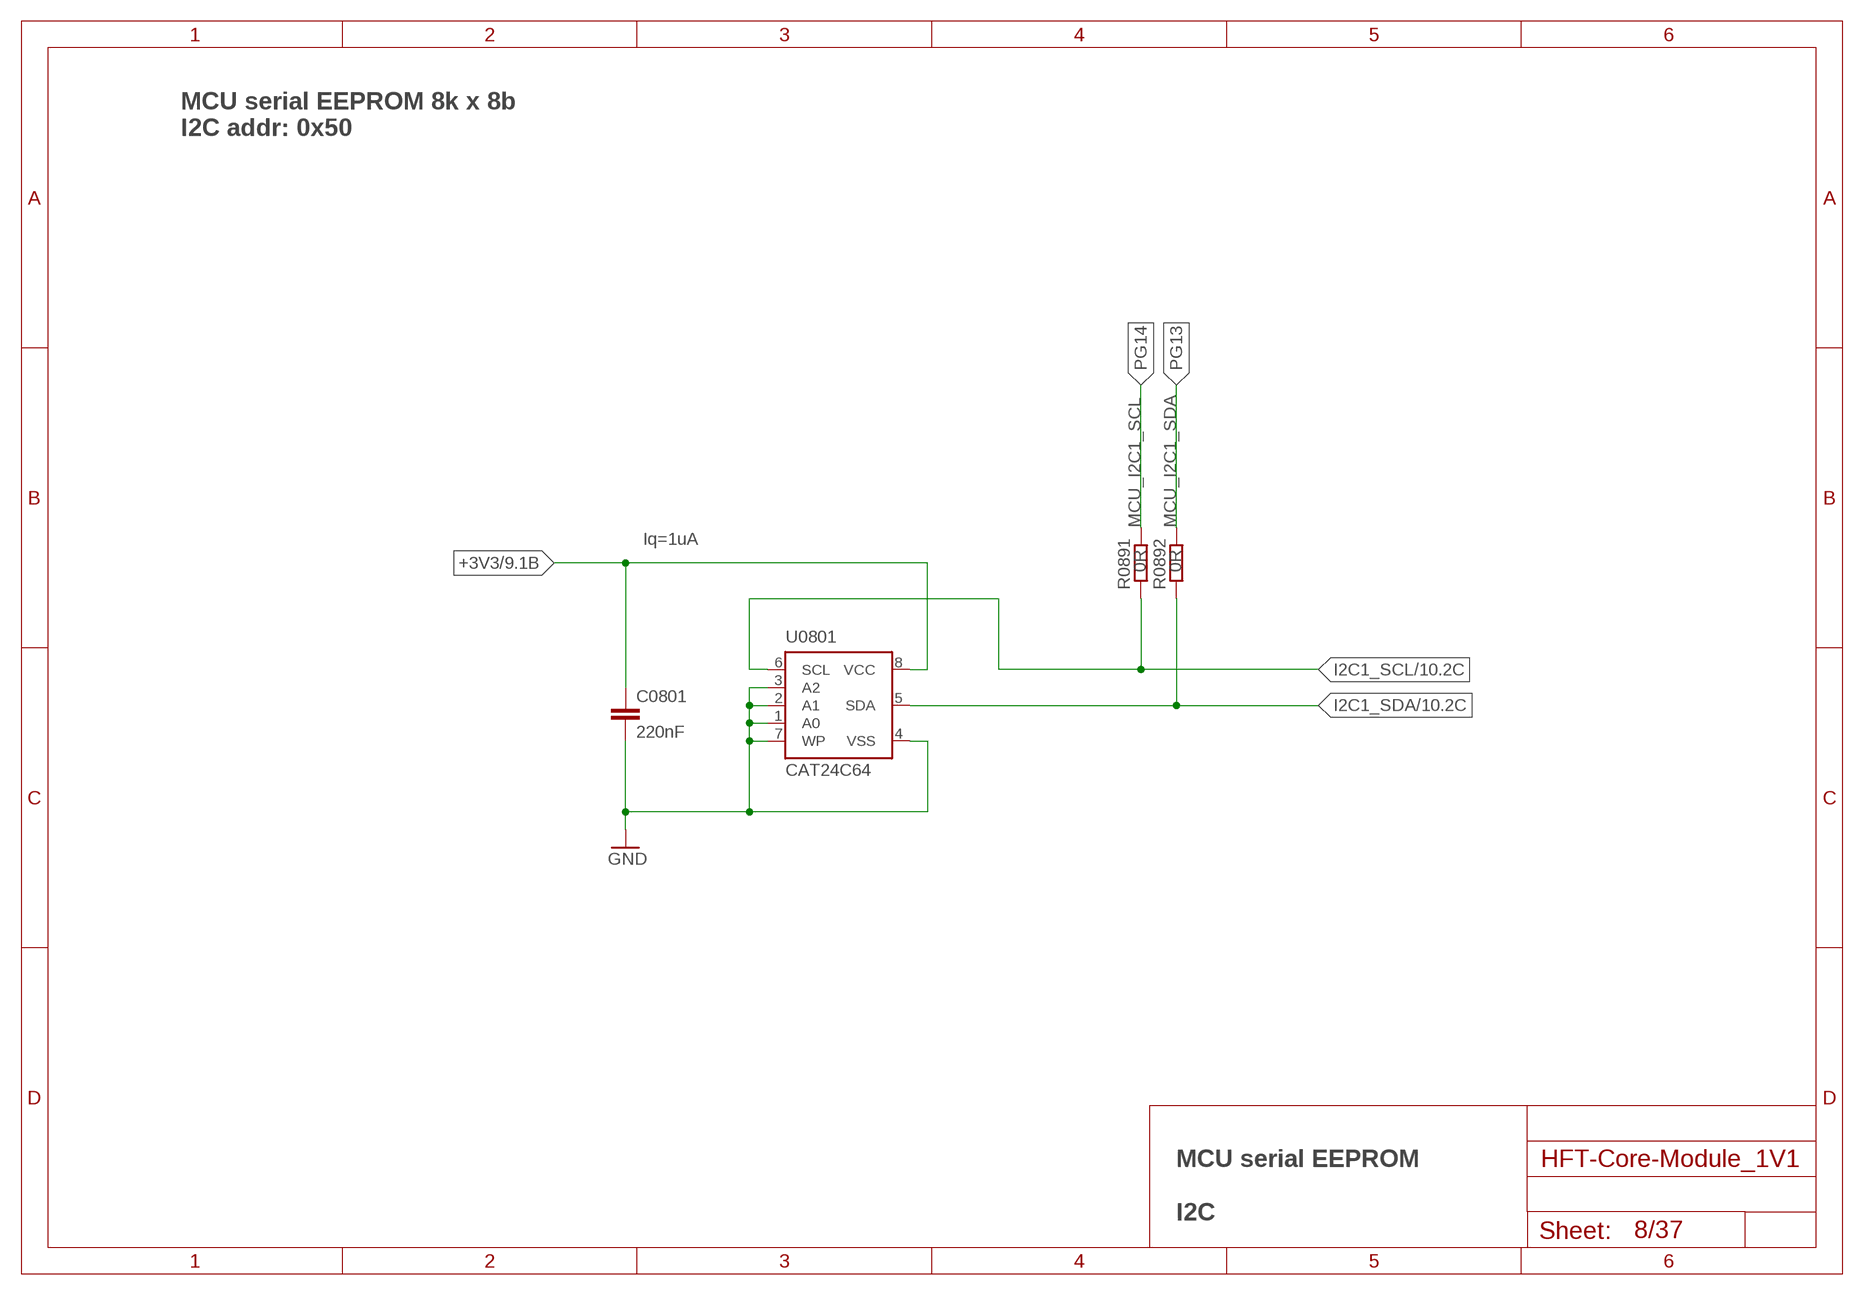
[diagram p7: schematic, sheet 8]

### Parts
C0801  220nF  C-EUC0402  [C0402]
R0891  0R  R-EU_R0402  [R0402]
R0892  0R  R-EU_R0402  [R0402]
U0801  CAT24C64  [SOIC8_150MIL]

### Nets
+3V3: C0801.1 U0801.8(VCC) ; also sheet 2,4,5,6,7,9,10,11,13,14,15,22,23,25,26,27,28,30,31,34,36
GND: C0801.2 U0801.1(A0) U0801.2(A1) U0801.3(A2) U0801.4(VSS) U0801.7(WP) ; also sheet 1,2,3,4,5,6,7,9,10,11,12,13,14,15,16,17,18,19,21,22,23,24,25,26,27,28,29,30,31,32,33,34,35,36,37
I2C1_SCL: R0891.1 U0801.6(SCL) ; also sheet 5,6,10,14,15,16,17,18,25
I2C1_SDA: R0892.1 U0801.5(SDA) ; also sheet 5,6,10,14,15,16,17,18,25
PG13: R0892.2 ; also sheet 1
PG14: R0891.2 ; also sheet 1

### Notes on the sheet
- MCU serial EEPROM 8k x 8b
  I2C addr: 0x50
- MCU_I2C1_SCL | MCU_I2C1_SDA
- Iq=1uA
- MCU serial EEPROM
  
  I2C

## Sheet 9 of 37: SPI3 - E-Ink-Display
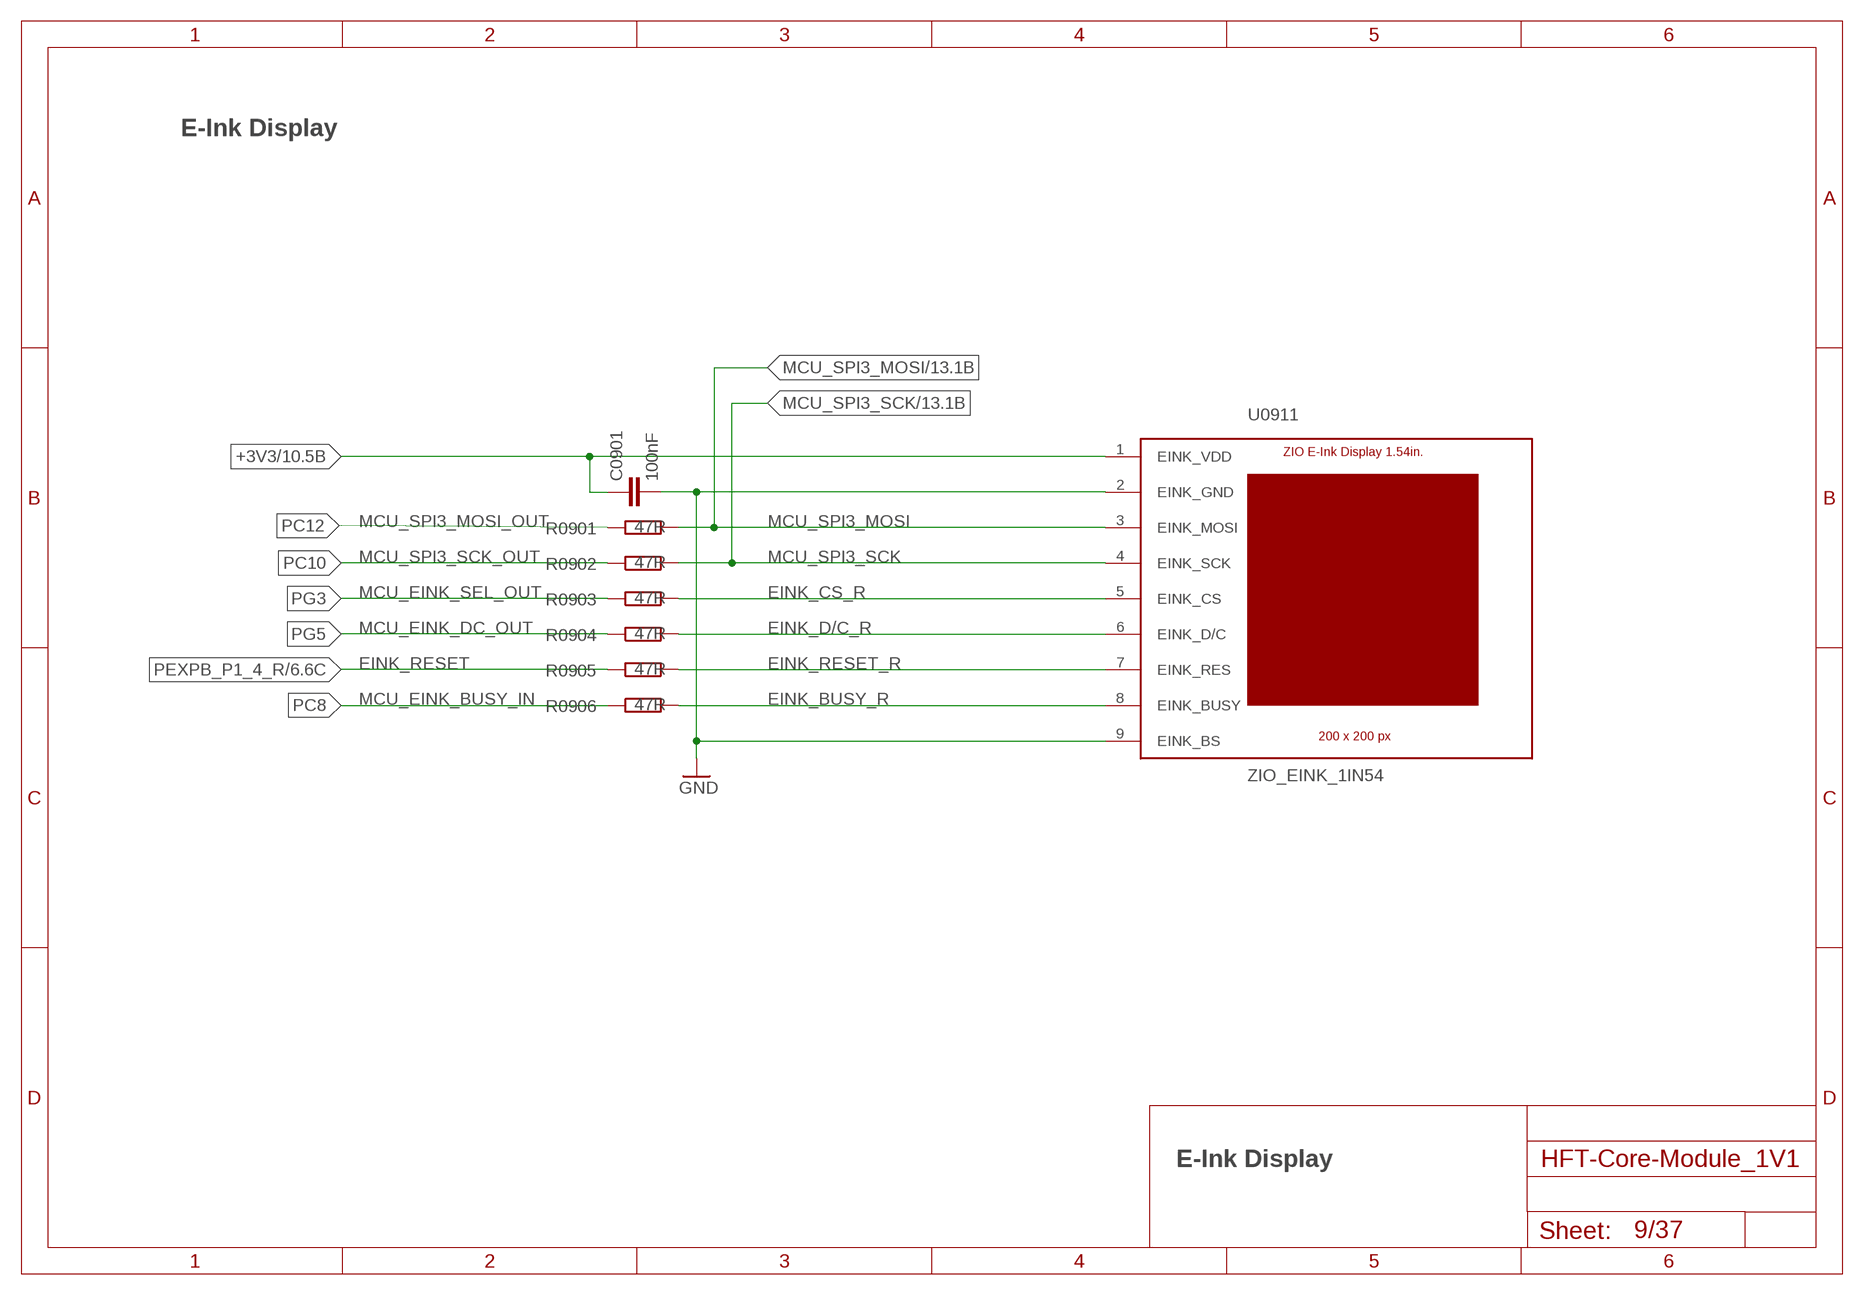
[diagram p8: schematic, sheet 9]

### Parts
C0901  100nF  C-EUC0402  [C0402]
R0901  47R  R-EU_R0402  [R0402]
R0902  47R  R-EU_R0402  [R0402]
R0903  47R  R-EU_R0402  [R0402]
R0904  47R  R-EU_R0402  [R0402]
R0905  47R  R-EU_R0402  [R0402]
R0906  47R  R-EU_R0402  [R0402]
U0911  ZIO_EINK_1IN54  [ZIO_EINK_1IN54]

### Nets
+3V3: C0901.1 U0911.1(EINK_VDD) ; also sheet 2,4,5,6,7,8,10,11,13,14,15,22,23,25,26,27,28,30,31,34,36
EINK_BUSY_R: R0906.2 U0911.8(EINK_BUSY)
EINK_CS_R: R0903.2 U0911.5(EINK_CS)
EINK_D/C_R: R0904.2 U0911.6(EINK_D/C)
EINK_RESET_R: R0905.2 U0911.7(EINK_RES)
GND: C0901.2 U0911.2(EINK_GND) U0911.9(EINK_BS) ; also sheet 1,2,3,4,5,6,7,8,10,11,12,13,14,15,16,17,18,19,21,22,23,24,25,26,27,28,29,30,31,32,33,34,35,36,37
MCU_SPI3_MOSI: R0901.2 U0911.3(EINK_MOSI) ; also sheet 13,22,23
MCU_SPI3_SCK: R0902.2 U0911.4(EINK_SCK) ; also sheet 13,22,23
PC8: R0906.1 ; also sheet 1
PC10: R0902.1 ; also sheet 1
PC12: R0901.1 ; also sheet 1
PEXPB_P1_4_R: R0905.1 ; also sheet 6
PG3: R0903.1 ; also sheet 1
PG5: R0904.1 ; also sheet 1

### Notes on the sheet
- E-Ink Display
- MCU_SPI3_MOSI_OUT | MCU_SPI3_MOSI
- MCU_SPI3_SCK_OUT | MCU_SPI3_SCK
- MCU_EINK_SEL_OUT
- MCU_EINK_DC_OUT
- EINK_RESET
- MCU_EINK_BUSY_IN
- E-Ink Display

## Sheet 10 of 37: I2C1 - LCD
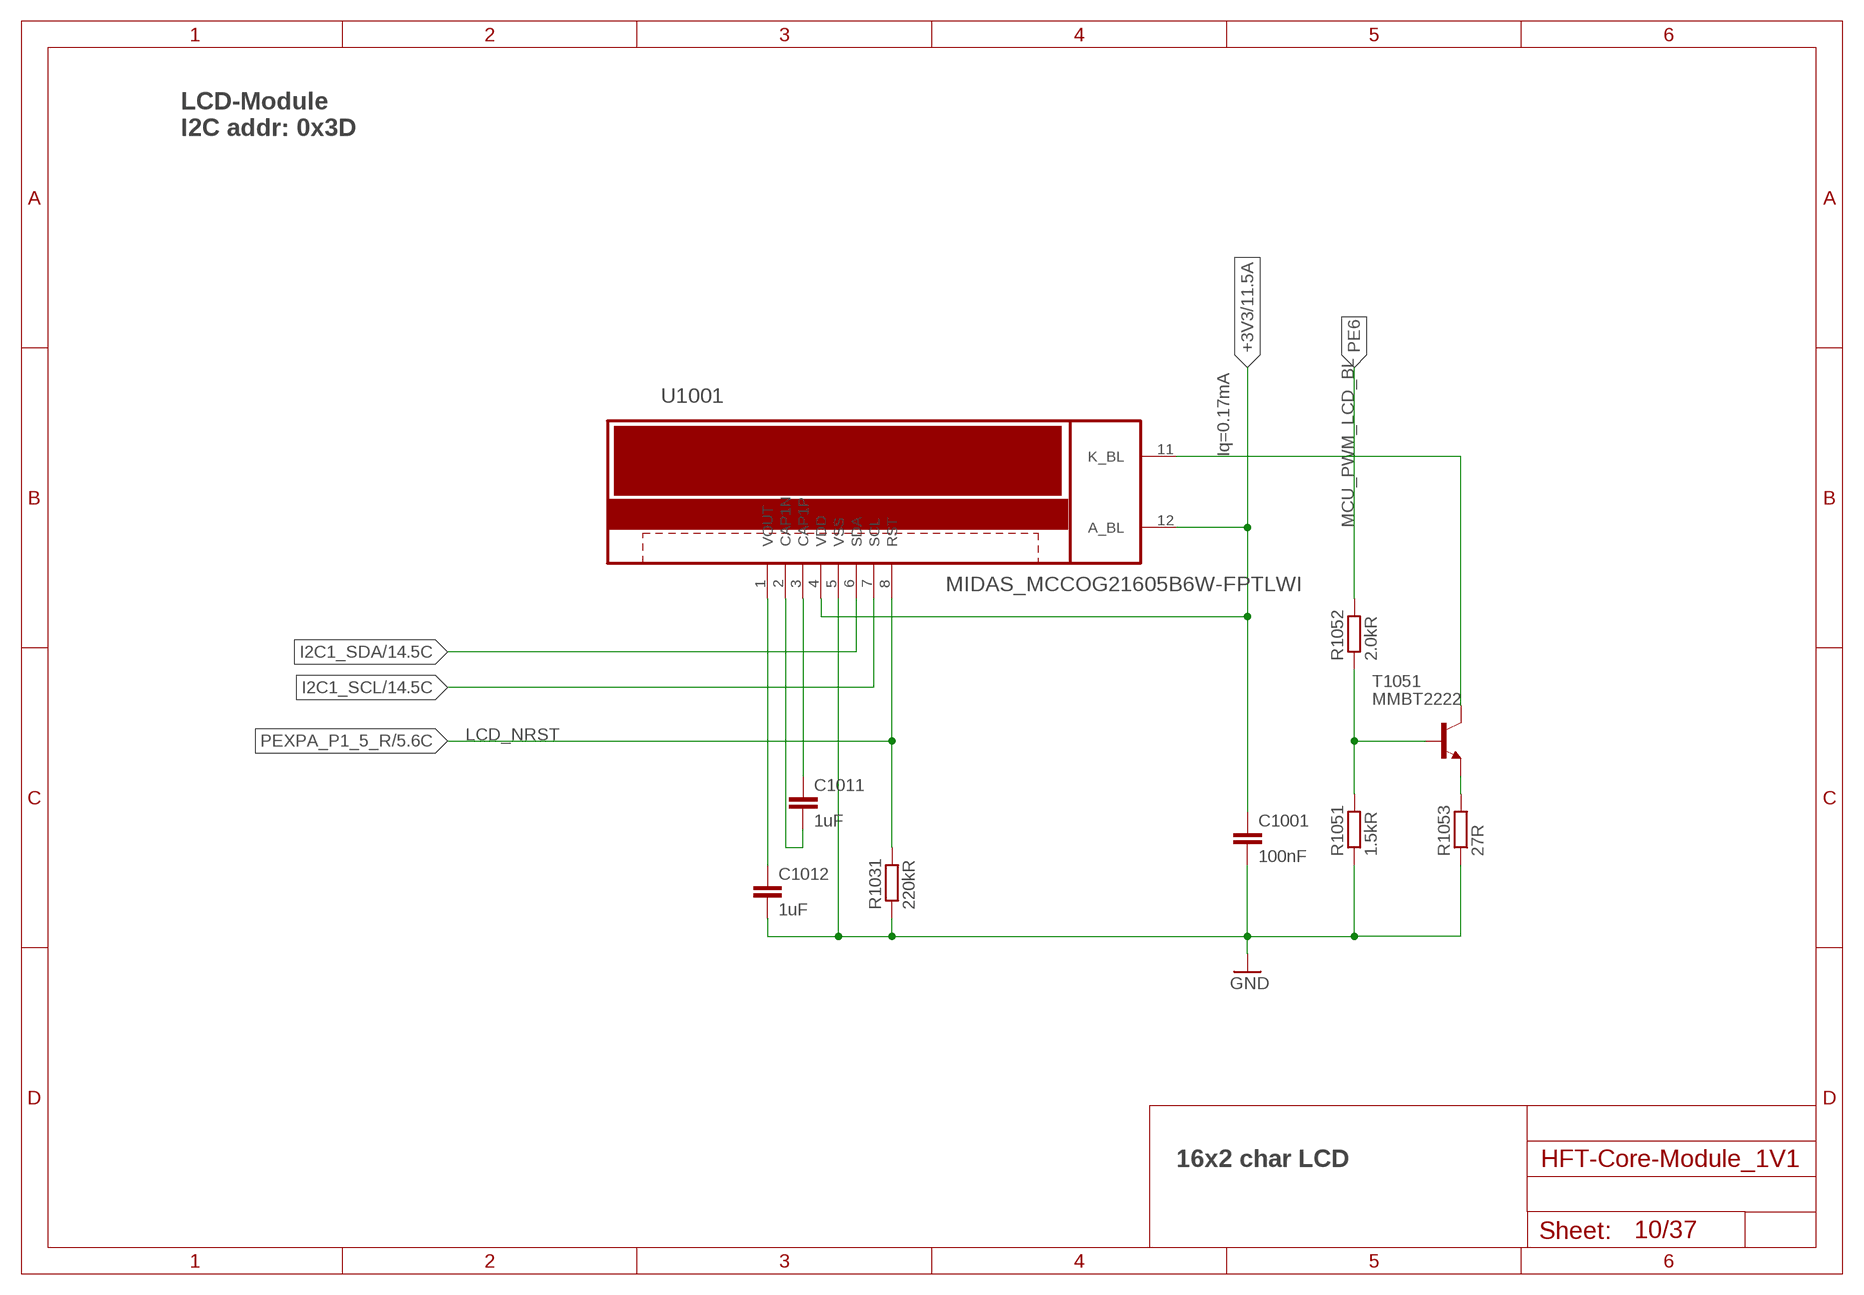
[diagram p9: schematic, sheet 10]

### Parts
C1001  100nF  C-EUC0402  [C0402]
C1011  1uF  C-EUC0402  [C0402]
C1012  1uF  C-EUC0402  [C0402]
R1031  220kR  R-EU_R0402  [R0402]
R1051  1.5kR  R-EU_R0402  [R0402]
R1052  2.0kR  R-EU_R0402  [R0402]
R1053  27R  R-EU_R0402  [R0402]
T1051  MMBT2222  BC846  [SOT23]
U1001  MIDAS_MCCOG21605B6W-FPTLWI  [MIDAS_MCCOG21605B6W-FPTLWI]

### Nets
+3V3: C1001.1 U1001.4(VDD) U1001.12(A_BL) ; also sheet 2,4,5,6,7,8,9,11,13,14,15,22,23,25,26,27,28,30,31,34,36
GND: C1001.2 C1012.2 R1031.1 R1051.1 R1053.1 U1001.5(VSS) ; also sheet 1,2,3,4,5,6,7,8,9,11,12,13,14,15,16,17,18,19,21,22,23,24,25,26,27,28,29,30,31,32,33,34,35,36,37
I2C1_SCL: U1001.7(SCL) ; also sheet 5,6,8,14,15,16,17,18,25
I2C1_SDA: U1001.6(SDA) ; also sheet 5,6,8,14,15,16,17,18,25
LCD_BL_K: T1051.3(C) U1001.11(K_BL)
LCD_CAP1N: C1011.2 U1001.2(CAP1N)
LCD_CAP1P: C1011.1 U1001.3(CAP1P)
LCD_VOUT: C1012.1 U1001.1(VOUT)
LED_B_B: R1051.2 R1052.1 T1051.1(B)
LED_B_E: R1053.2 T1051.2(E)
PE6: R1052.2 ; also sheet 1
PEXPA_P1_5_R: R1031.2 U1001.8(RST) ; also sheet 5

### Notes on the sheet
- LCD-Module
  I2C addr: 0x3D
- Iq=0.17mA
- MCU_PWM_LCD_BL
- LCD_NRST
- 16x2 char LCD

## Sheet 11 of 37: PWM - RGB-LED
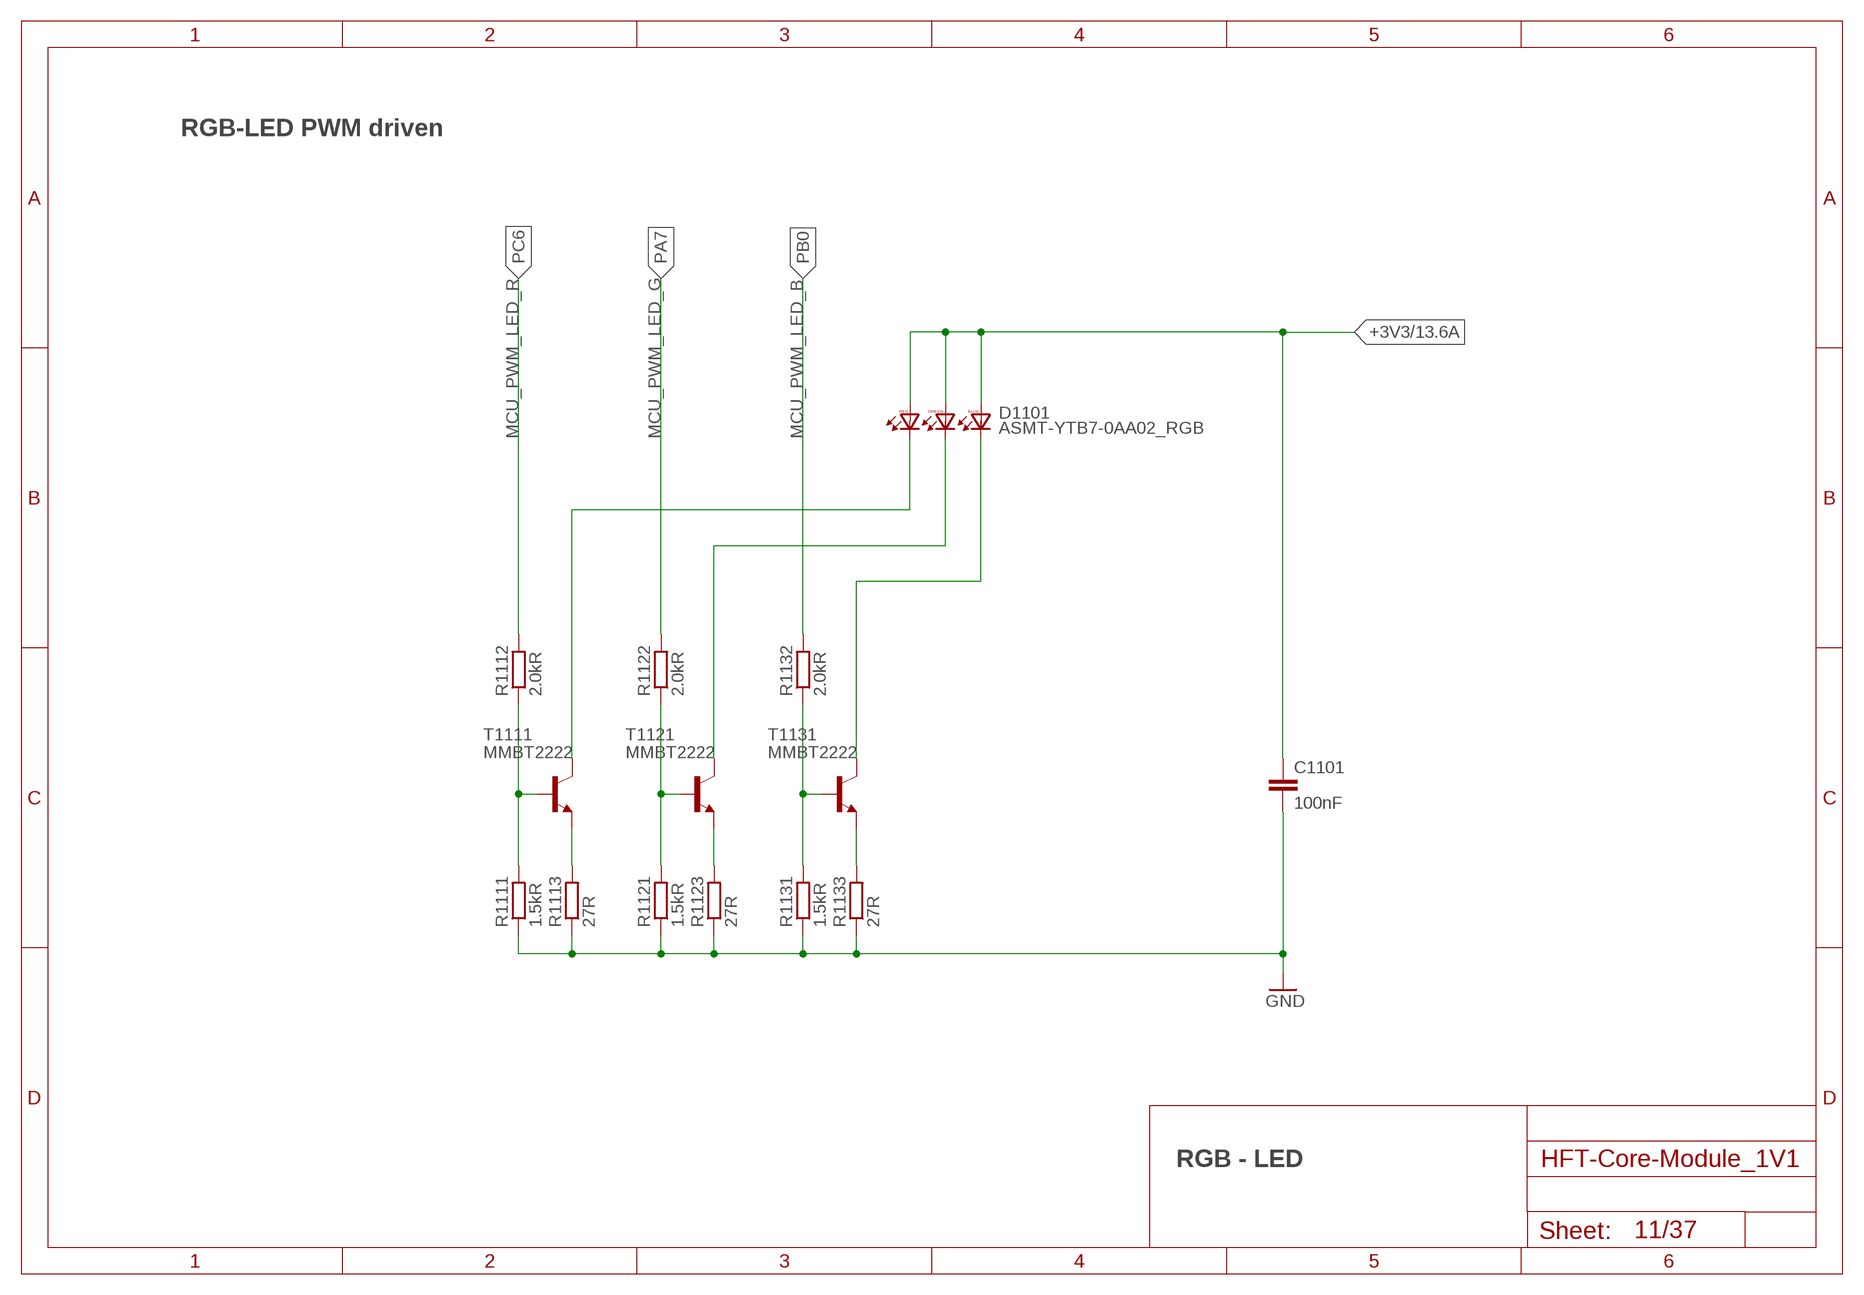
[diagram p10: schematic, sheet 11]

### Parts
C1101  100nF  C-EUC0402  [C0402]
D1101  ASMT-YTB7-0AA02_RGB  [ASMT-YTB7_0AA02_RGB]
R1111  1.5kR  R-EU_R0402  [R0402]
R1112  2.0kR  R-EU_R0402  [R0402]
R1113  27R  R-EU_R0805  [R0805]
R1121  1.5kR  R-EU_R0402  [R0402]
R1122  2.0kR  R-EU_R0402  [R0402]
R1123  27R  R-EU_R0805  [R0805]
R1131  1.5kR  R-EU_R0402  [R0402]
R1132  2.0kR  R-EU_R0402  [R0402]
R1133  27R  R-EU_R0805  [R0805]
T1111  MMBT2222  BC846  [SOT23]
T1121  MMBT2222  BC846  [SOT23]
T1131  MMBT2222  BC846  [SOT23]

### Nets
+3V3: C1101.1 D1101.4(RA) D1101.5(GA) D1101.6(BA) ; also sheet 2,4,5,6,7,8,9,10,13,14,15,22,23,25,26,27,28,30,31,34,36
GND: C1101.2 R1111.1 R1113.1 R1121.1 R1123.1 R1131.1 R1133.1 ; also sheet 1,2,3,4,5,6,7,8,9,10,12,13,14,15,16,17,18,19,21,22,23,24,25,26,27,28,29,30,31,32,33,34,35,36,37
LED_B_B1: R1131.2 R1132.1 T1131.1(B)
LED_B_E1: R1133.2 T1131.2(E)
LED_B_K1: D1101.1(BC) T1131.3(C)
LED_G_B1: R1121.2 R1122.1 T1121.1(B)
LED_G_E1: R1123.2 T1121.2(E)
LED_G_K1: D1101.2(GC) T1121.3(C)
LED_R_B1: R1111.2 R1112.1 T1111.1(B)
LED_R_E1: R1113.2 T1111.2(E)
LED_R_K1: D1101.3(RC) T1111.3(C)
PA7: R1122.2 ; also sheet 1
PB0: R1132.2 ; also sheet 1
PC6: R1112.2 ; also sheet 1

### Notes on the sheet
- RGB-LED PWM driven
- MCU_PWM_LED_R | MCU_PWM_LED_G | MCU_PWM_LED_B
- RGB - LED

## Sheet 12 of 37: Rotary encoder - I/Q
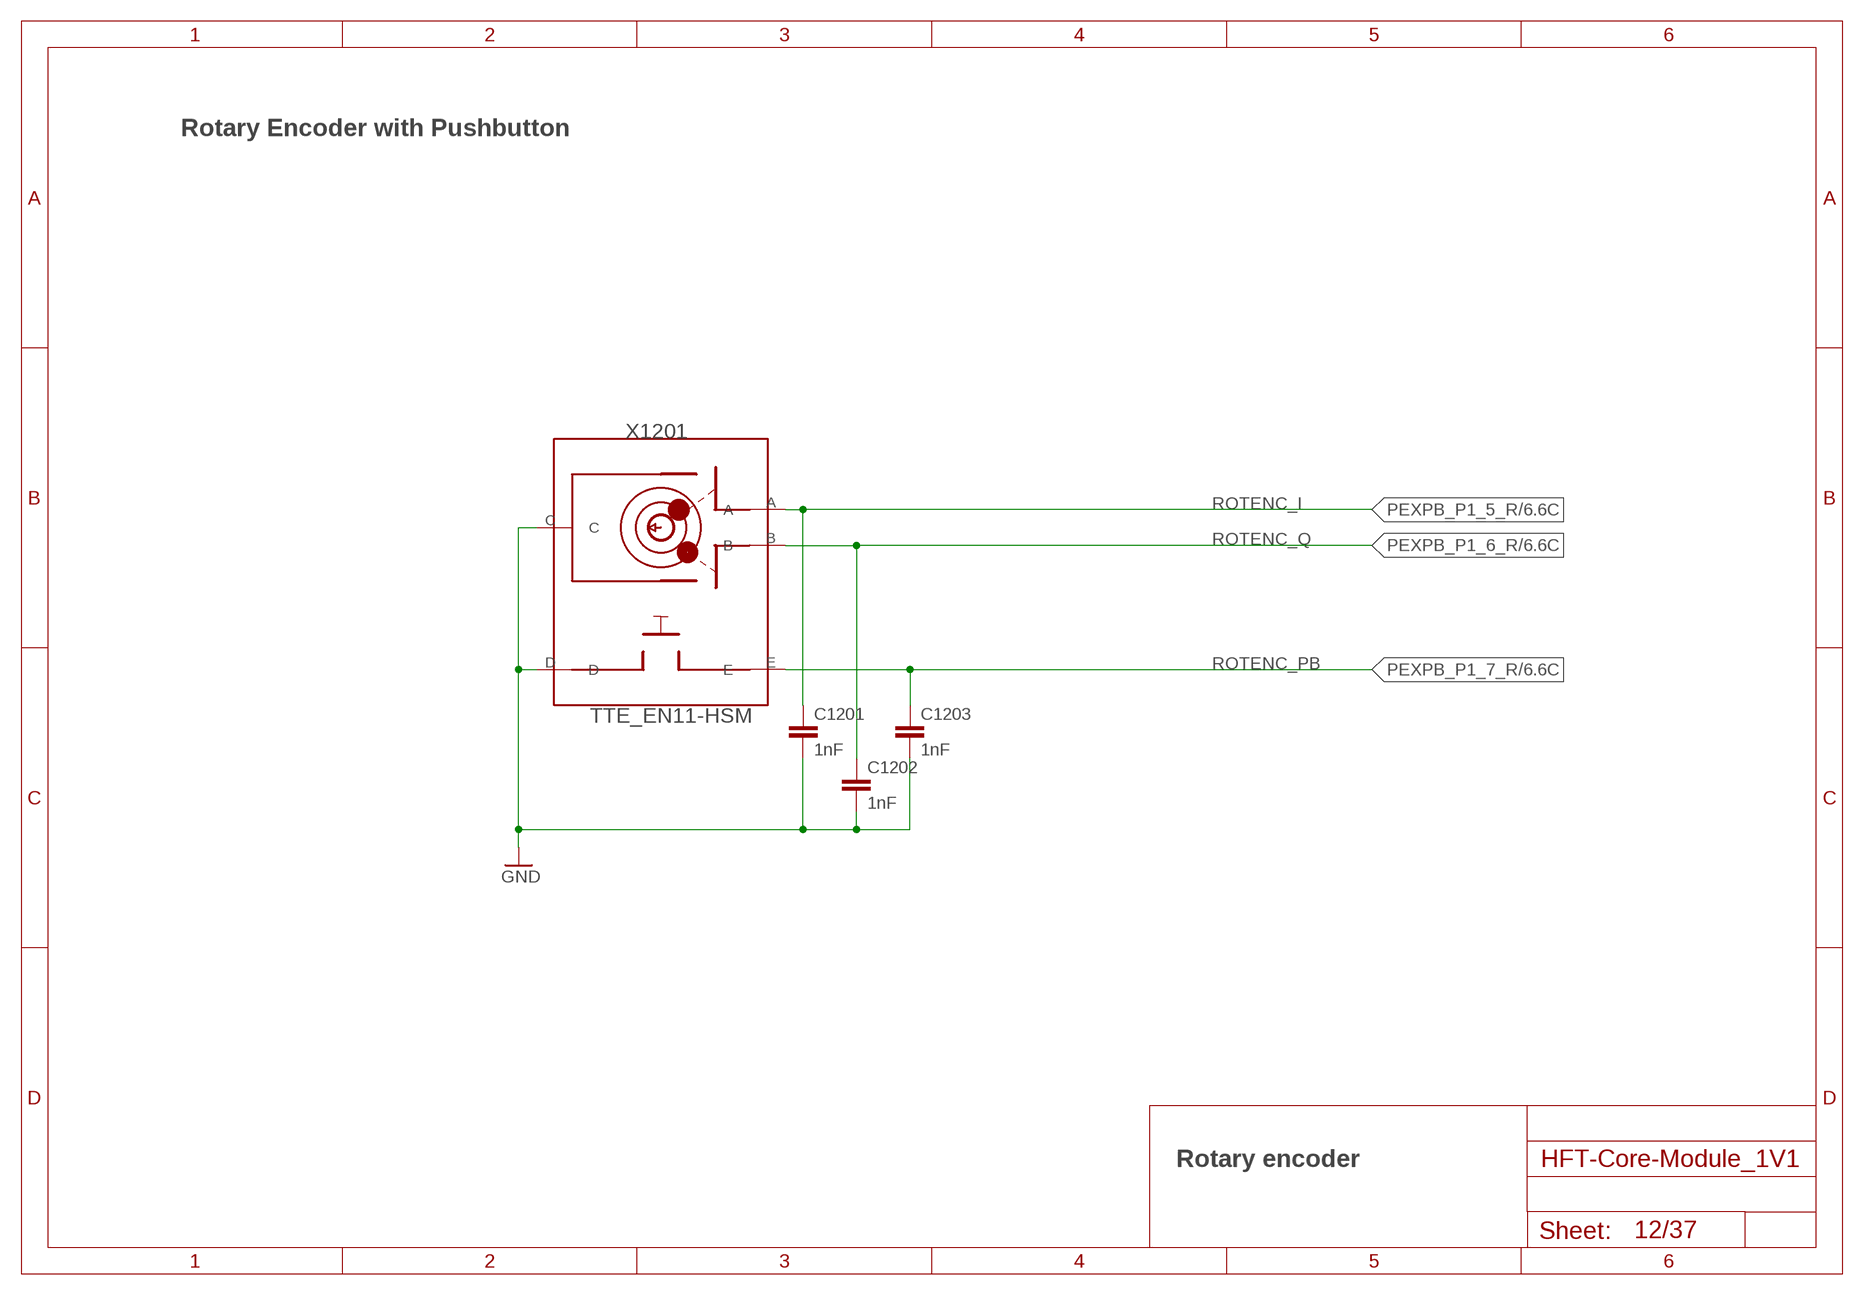
[diagram p11: schematic, sheet 12]

### Parts
C1201  1nF  C-EUC0402  [C0402]
C1202  1nF  C-EUC0402  [C0402]
C1203  1nF  C-EUC0402  [C0402]
X1201  TTE_EN11-HSM  [TTE_EN11-HSM]

### Nets
GND: C1201.2 C1202.2 C1203.2 X1201.C X1201.D ; also sheet 1,2,3,4,5,6,7,8,9,10,11,13,14,15,16,17,18,19,21,22,23,24,25,26,27,28,29,30,31,32,33,34,35,36,37
PEXPB_P1_5_R: C1201.1 X1201.A ; also sheet 6
PEXPB_P1_6_R: C1202.1 X1201.B ; also sheet 6
PEXPB_P1_7_R: C1203.1 X1201.E ; also sheet 6

### Notes on the sheet
- Rotary Encoder with Pushbutton
- ROTENC_I
- ROTENC_Q
- ROTENC_PB
- Rotary encoder

## Sheet 13 of 37: SPI3 - Position tracking
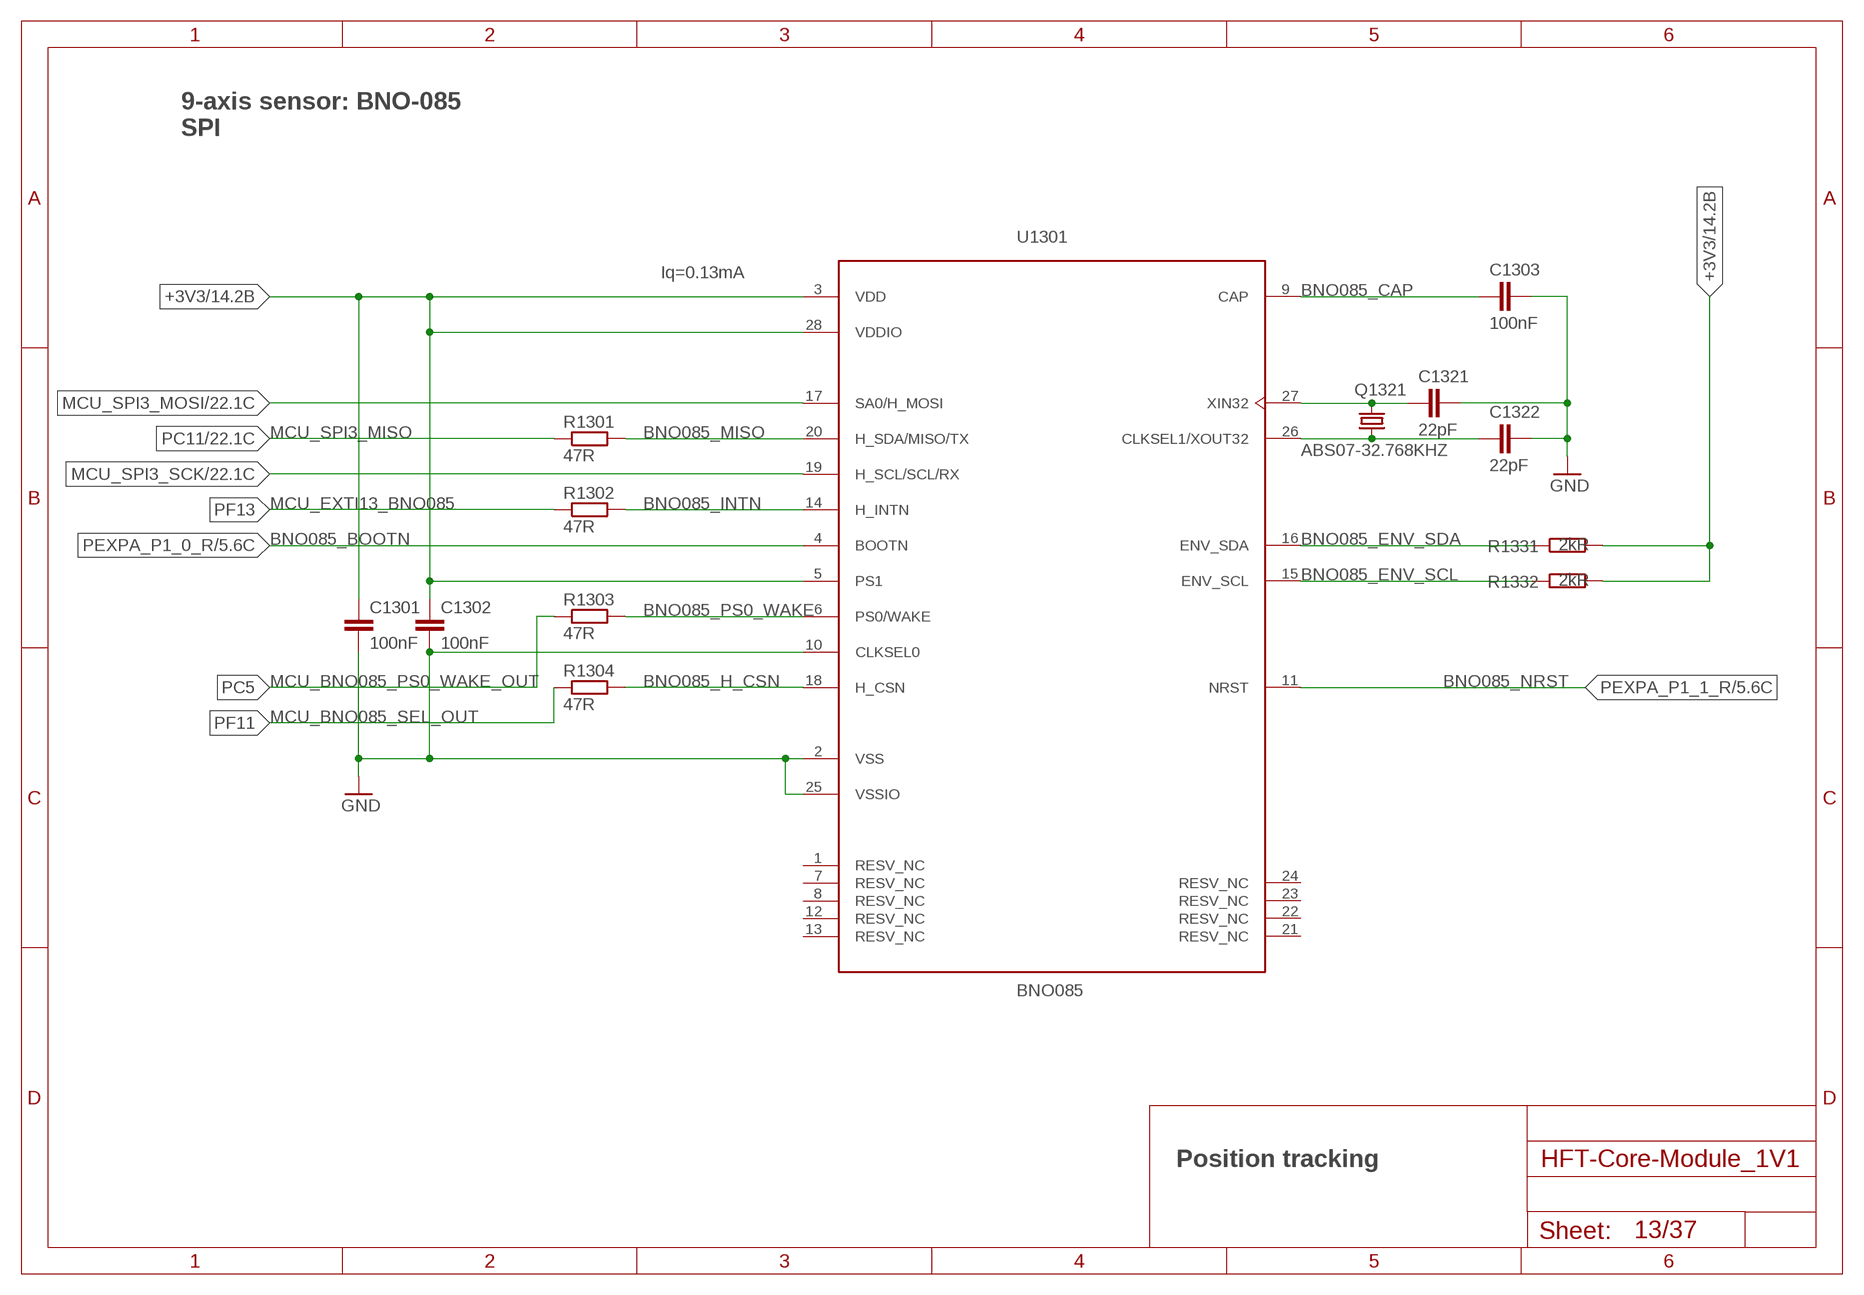
[diagram p12: schematic, sheet 13]

### Parts
C1301  100nF  C-EUC0402  [C0402]
C1302  100nF  C-EUC0402  [C0402]
C1303  100nF  C-EUC0402  [C0402]
C1321  22pF  C-EUC0402  [C0402]
C1322  22pF  C-EUC0402  [C0402]
Q1321  ABS07-32.768KHZ  [ABS07]
R1301  47R  R-EU_R0402  [R0402]
R1302  47R  R-EU_R0402  [R0402]
R1303  47R  R-EU_R0402  [R0402]
R1304  47R  R-EU_R0402  [R0402]
R1331  2kR  R-EU_R0402  [R0402]
R1332  2kR  R-EU_R0402  [R0402]
U1301  BNO085  [BNO085_LGA28]

### Nets
+3V3: C1301.1 C1302.1 R1331.2 R1332.2 U1301.3(VDD) U1301.5(PS1) U1301.28(VDDIO) ; also sheet 2,4,5,6,7,8,9,10,11,14,15,22,23,25,26,27,28,30,31,34,36
BNO085_CAP: C1303.1 U1301.9(CAP)
BNO085_CLKSEL1_XOUT32: C1322.1 Q1321.1 U1301.26(CLKSEL1/XOUT32)
BNO085_ENV_SCL: R1332.1 U1301.15(ENV_SCL)
BNO085_ENV_SDA: R1331.1 U1301.16(ENV_SDA)
BNO085_H_CSN: R1304.2 U1301.18(H_CSN)
BNO085_INTN: R1302.2 U1301.14(H_INTN)
BNO085_MISO: R1301.2 U1301.20(H_SDA/MISO/TX)
BNO085_PS0_WAKE: R1303.2 U1301.6(PS0/WAKE)
BNO085_XIN32: C1321.1 Q1321.2 U1301.27(XIN32)
GND: C1301.2 C1302.2 C1303.2 C1321.2 C1322.2 U1301.2(VSS) U1301.10(CLKSEL0) U1301.25(VSSIO) ; also sheet 1,2,3,4,5,6,7,8,9,10,11,12,14,15,16,17,18,19,21,22,23,24,25,26,27,28,29,30,31,32,33,34,35,36,37
MCU_SPI3_MOSI: U1301.17(SA0/H_MOSI) ; also sheet 9,22,23
MCU_SPI3_SCK: U1301.19(H_SCL/SCL/RX) ; also sheet 9,22,23
PC5: R1303.1 ; also sheet 1
PC11: R1301.1 ; also sheet 1,22,23
PEXPA_P1_0_R: U1301.4(BOOTN) ; also sheet 5
PEXPA_P1_1_R: U1301.11(NRST) ; also sheet 5
PF11: R1304.1 ; also sheet 1
PF13: R1302.1 ; also sheet 1
Unconnected: U1301.1(RESV_NC) U1301.7(RESV_NC) U1301.8(RESV_NC) U1301.12(RESV_NC) U1301.13(RESV_NC) U1301.21(RESV_NC) U1301.22(RESV_NC) U1301.23(RESV_NC) U1301.24(RESV_NC)

### Notes on the sheet
- 9-axis sensor: BNO-085
  SPI
- Iq=0.13mA
- MCU_SPI3_MISO
- MCU_EXTI13_BNO085
- BNO085_BOOTN
- MCU_BNO085_PS0_WAKE_OUT | BNO085_NRST
- MCU_BNO085_SEL_OUT
- Position tracking

## Sheet 14 of 37: I2C1 - Climate sensor
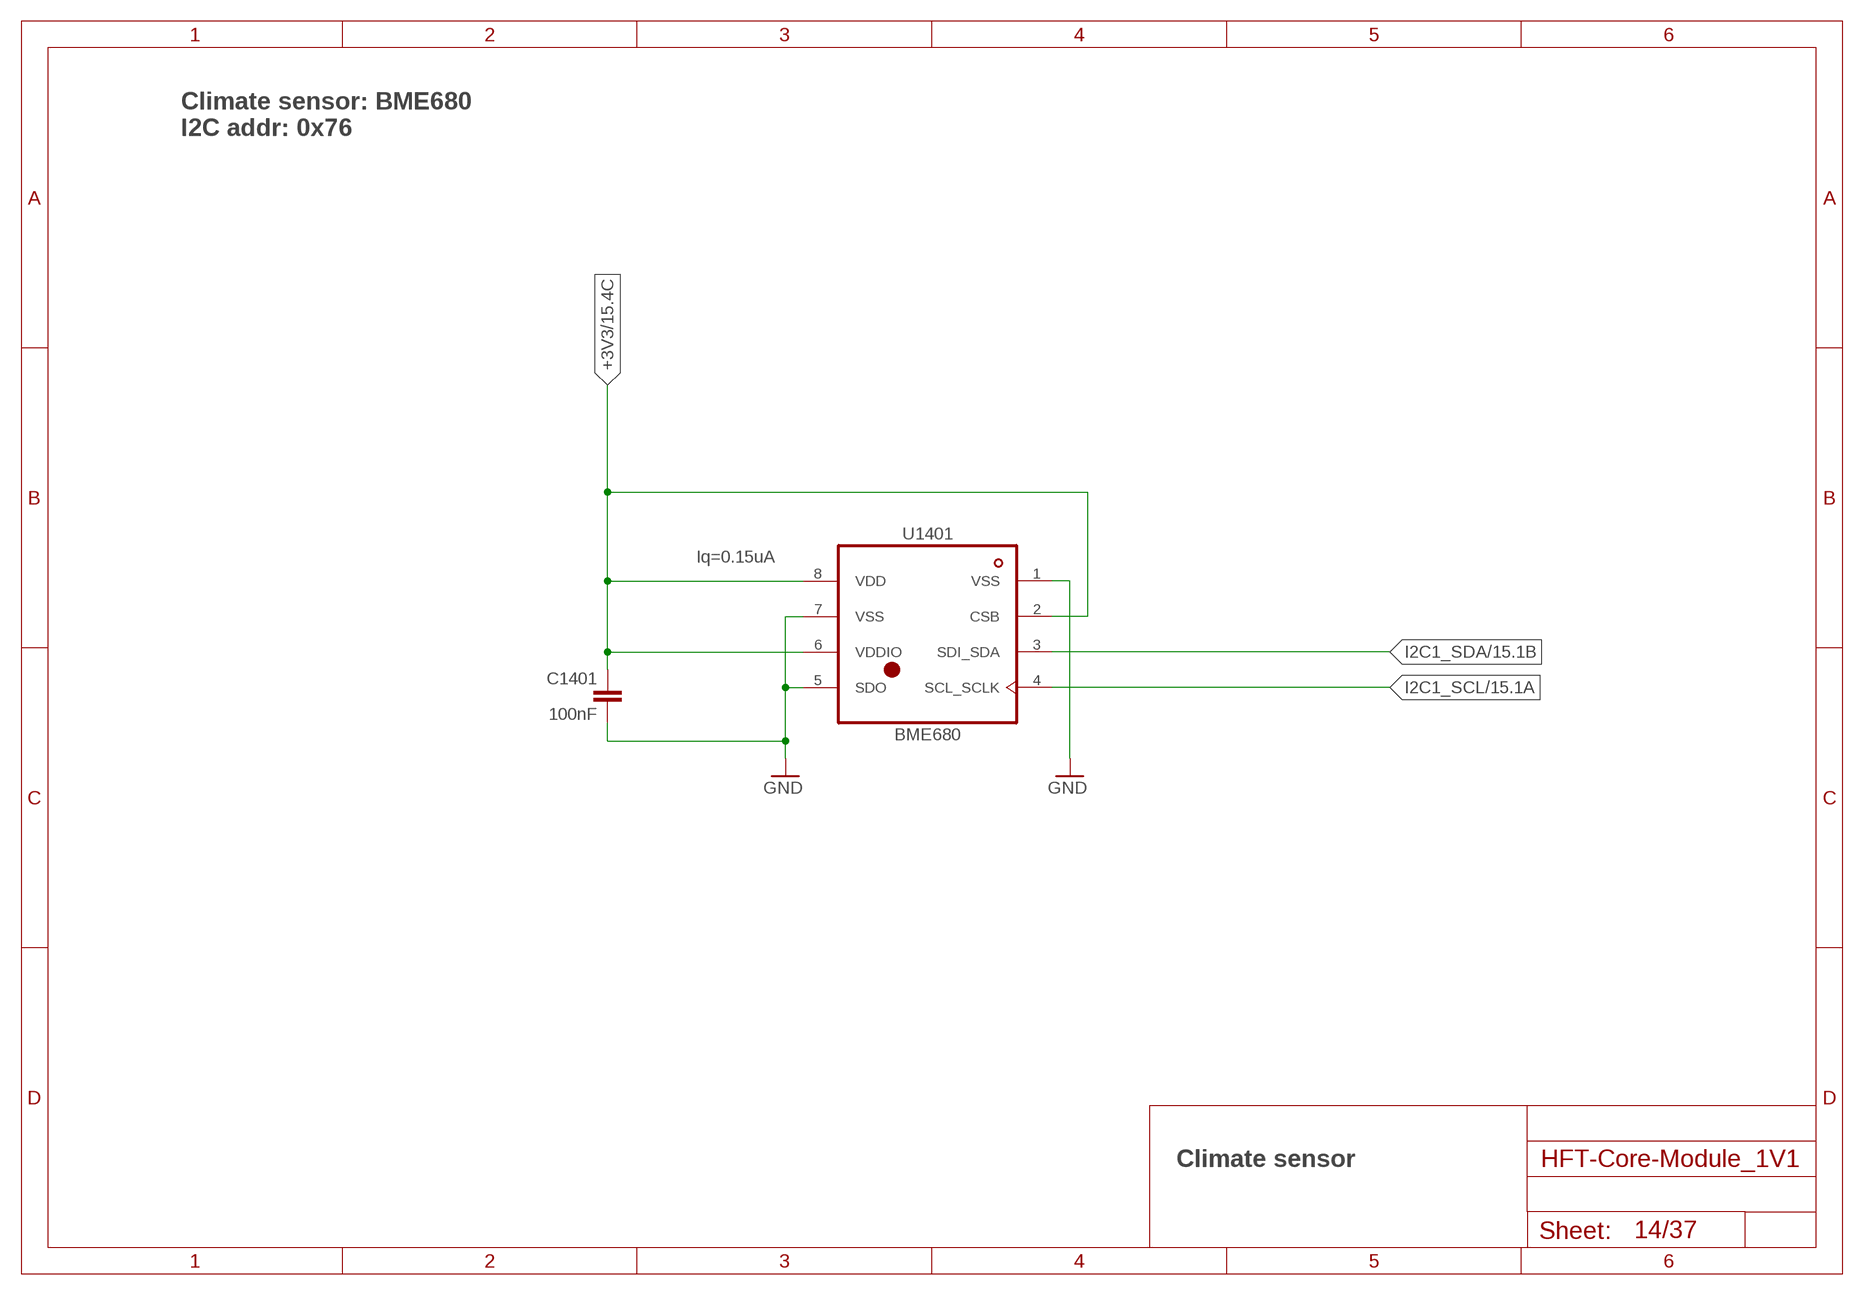
[diagram p13: schematic, sheet 14]

### Parts
C1401  100nF  C-EUC0402  [C0402]
U1401  BME680  [BME680]

### Nets
+3V3: C1401.1 U1401.2(CSB) U1401.6(VDDIO) U1401.8(VDD) ; also sheet 2,4,5,6,7,8,9,10,11,13,15,22,23,25,26,27,28,30,31,34,36
GND: C1401.2 U1401.1(VSS) U1401.5(SDO) U1401.7(VSS) ; also sheet 1,2,3,4,5,6,7,8,9,10,11,12,13,15,16,17,18,19,21,22,23,24,25,26,27,28,29,30,31,32,33,34,35,36,37
I2C1_SCL: U1401.4(SCL_SCLK) ; also sheet 5,6,8,10,15,16,17,18,25
I2C1_SDA: U1401.3(SDI_SDA) ; also sheet 5,6,8,10,15,16,17,18,25

### Notes on the sheet
- Climate sensor: BME680
  I2C addr: 0x76
- Iq=0.15uA
- Climate sensor

## Sheet 15 of 37: I2C1 - VCTCXO
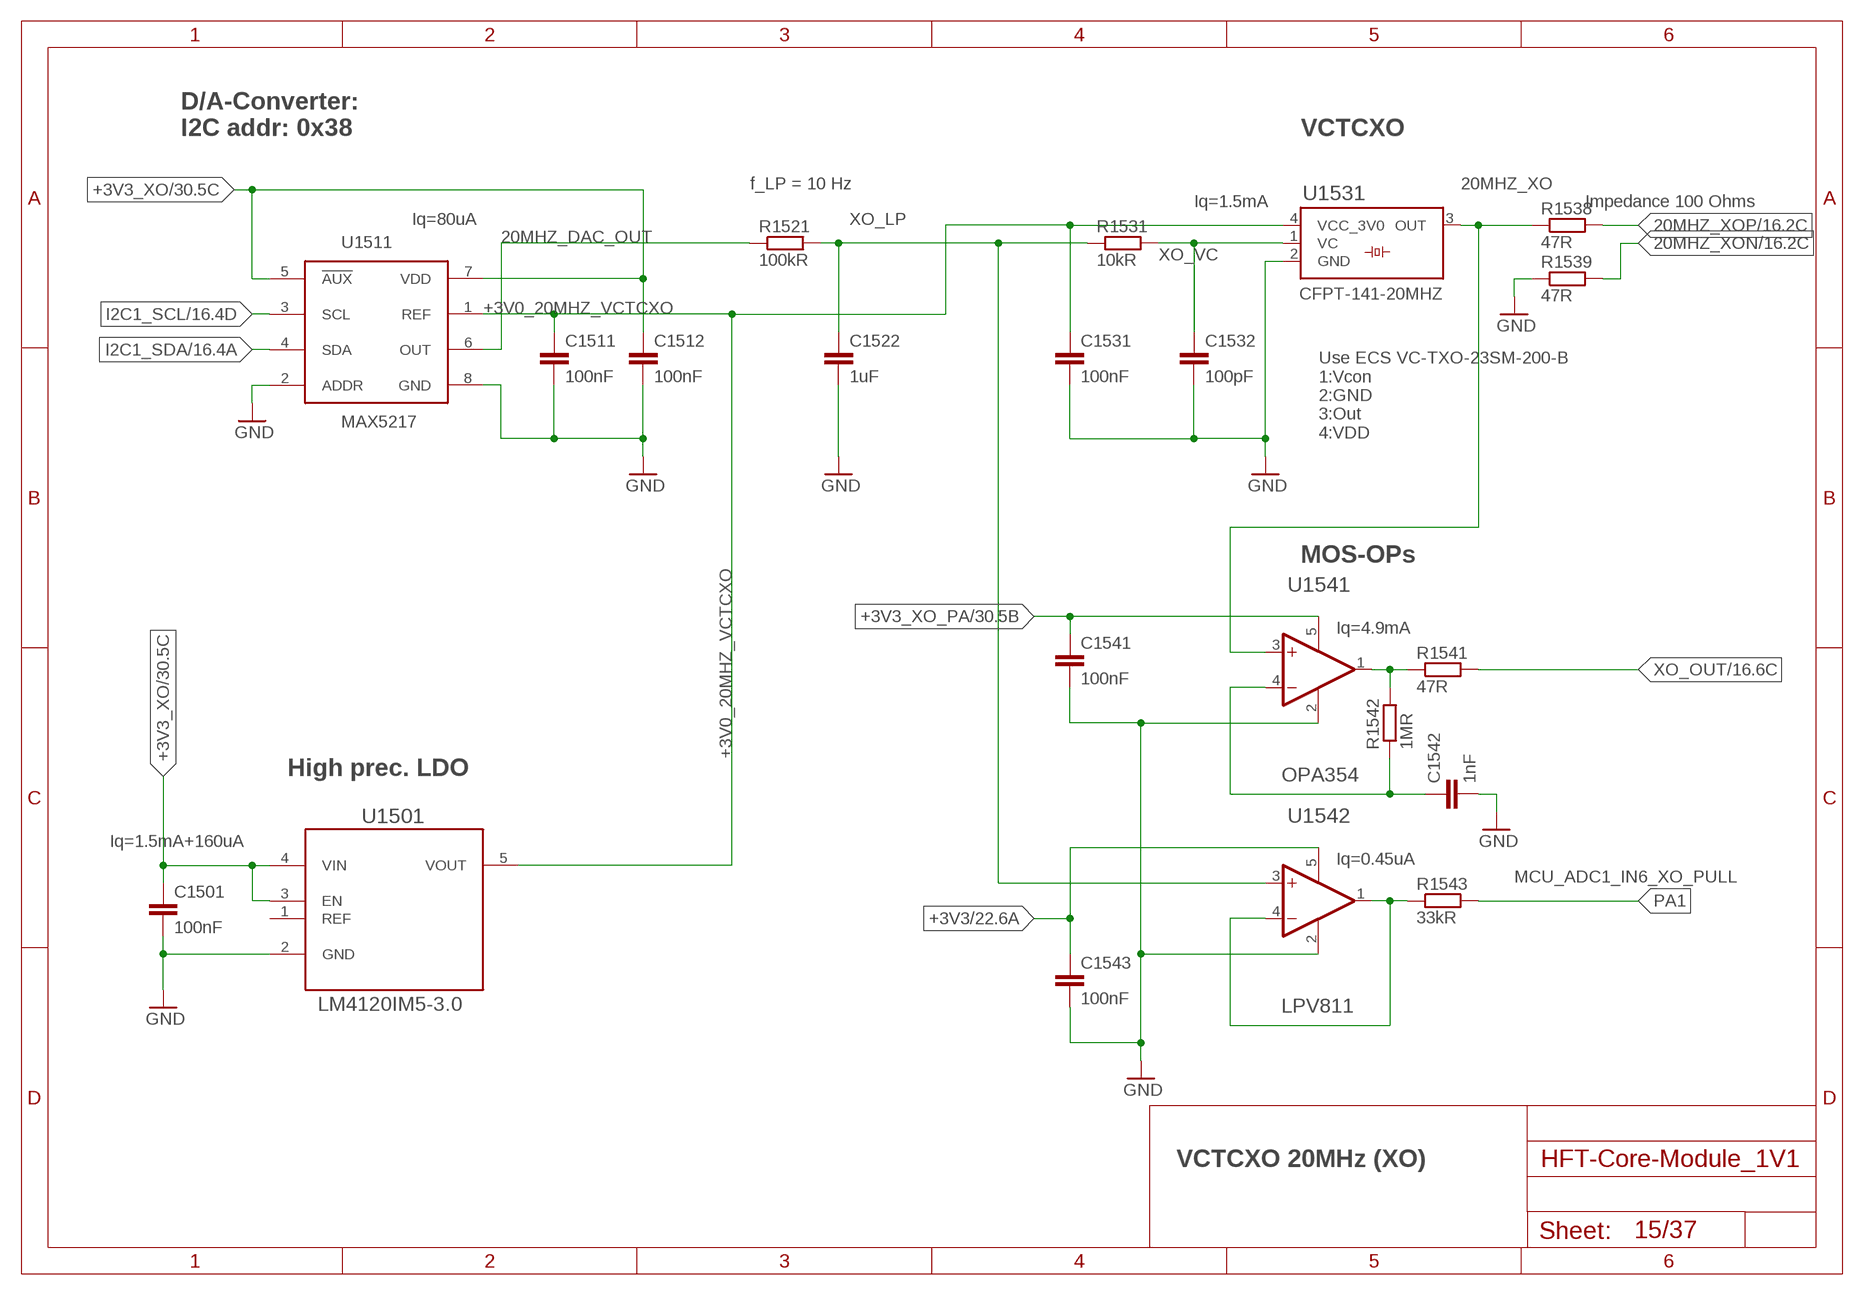
[diagram p14: schematic, sheet 15]

### Parts
C1501  100nF  C-EUC0402  [C0402]
C1511  100nF  C-EUC0402  [C0402]
C1512  100nF  C-EUC0402  [C0402]
C1522  1uF  C-EUC0402  [C0402]
C1531  100nF  C-EUC0402  [C0402]
C1532  100pF  C-EUC0402  [C0402]
C1541  100nF  C-EUC0402  [C0402]
C1542  1nF  C-EUC0402  [C0402]
C1543  100nF  C-EUC0402  [C0402]
R1521  100kR  R-EU_R0402  [R0402]
R1531  10kR  R-EU_R0402  [R0402]
R1538  47R  R-EU_R0402  [R0402]
R1539  47R  R-EU_R0402  [R0402]
R1541  47R  R-EU_R0402  [R0402]
R1542  1MR  R-EU_R0402  [R0402]
R1543  33kR  R-EU_R0402  [R0402]
U1501  LM4120IM5-3.0  [SOT95P285X120-5N]
U1511  MAX5217  [µMAX8]
U1531  CFPT-141-20MHZ  [CFPT-141]
U1541  OPA354  [SOT-23-5]
U1542  LPV811  [SOT-23-5]

### Nets
20MHZ_DAC_OUT: R1521.1 U1511.6(OUT)
20MHZ_XO: R1538.1 U1531.3(OUT) U1541.3(+IN)
20MHZ_XON: R1539.2 ; also sheet 16
20MHZ_XOP: R1538.2 ; also sheet 16
+3V0_20MHZ_VCTCXO: C1511.1 C1531.1 U1501.5(VOUT) U1511.1(REF) U1531.4(VCC_3V0)
+3V3: C1543.1 U1542.5(V+) ; also sheet 2,4,5,6,7,8,9,10,11,13,14,22,23,25,26,27,28,30,31,34,36
+3V3_XO: C1501.1 C1512.1 U1501.3(EN) U1501.4(VIN) U1511.5(!AUX) U1511.7(VDD) ; also sheet 30
+3V3_XO_PA: C1541.1 U1541.5(V+) ; also sheet 30
AD_VCTCXO1: R1543.1 U1542.1(OUT) U1542.4(-IN)
GND: C1501.2 C1511.2 C1512.2 C1522.2 C1531.2 C1532.2 C1541.2 C1542.2 C1543.2 R1539.1 U1501.2(GND) U1511.2(ADDR) U1511.8(GND) U1531.2(GND) U1541.2(V-) U1542.2(V-) ; also sheet 1,2,3,4,5,6,7,8,9,10,11,12,13,14,16,17,18,19,21,22,23,24,25,26,27,28,29,30,31,32,33,34,35,36,37
I2C1_SCL: U1511.3(SCL) ; also sheet 5,6,8,10,14,16,17,18,25
I2C1_SDA: U1511.4(SDA) ; also sheet 5,6,8,10,14,16,17,18,25
PA1: R1543.2 ; also sheet 1
VCTCXO_PA_N: C1542.1 R1542.1 U1541.4(-IN)
VCTCXO_PA_O: R1541.1 R1542.2 U1541.1(OUT)
XO_LP: C1522.1 R1521.2 R1531.1 U1542.3(+IN)
XO_OUT: R1541.2 ; also sheet 16
XO_VC: C1532.1 R1531.2 U1531.1(VC)
Unconnected: U1501.1(REF)

### Notes on the sheet
- D/A-Converter:
  I2C addr: 0x38
- VCTCXO
- f_LP = 10 Hz
- Iq=1.5mA | Impedance 100 Ohms
- Iq=80uA
- Use ECS VC-TXO-23SM-200-B
  1:Vcon
  2:GND
  3:Out
  4:VDD
- MOS-OPs
- Iq=4.9mA
- High prec. LDO
- Iq=1.5mA+160uA
- Iq=0.45uA
- MCU_ADC1_IN6_XO_PULL
- VCTCXO 20MHz (XO)

## Sheet 16 of 37: I2C1 - PLL Si5338
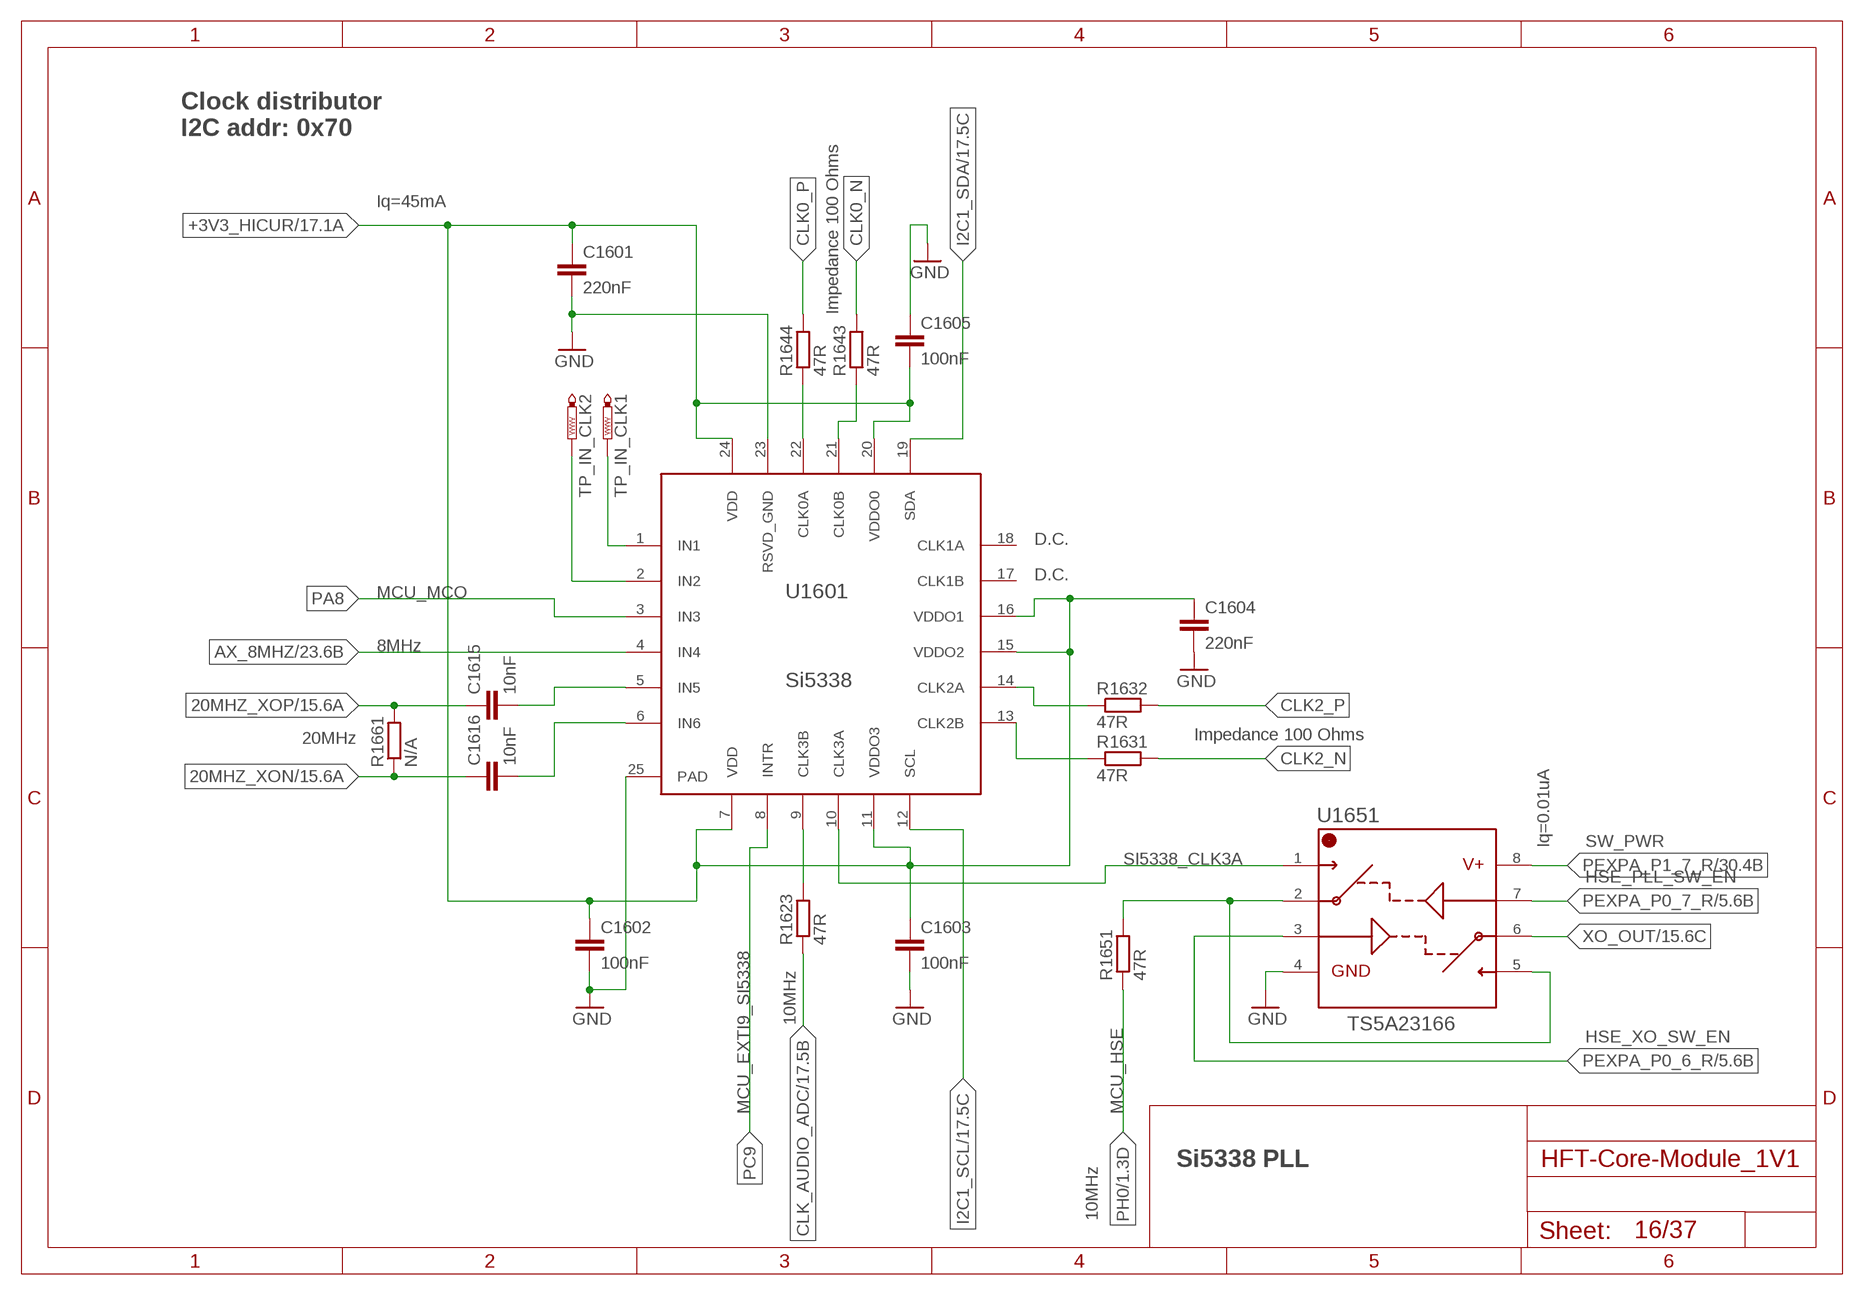
[diagram p15: schematic, sheet 16]

### Parts
C1601  220nF  C-EUC0402  [C0402]
C1602  100nF  C-EUC0402  [C0402]
C1603  100nF  C-EUC0402  [C0402]
C1604  220nF  C-EUC0402  [C0402]
C1605  100nF  C-EUC0402  [C0402]
C1615  10nF  C-EUC0402  [C0402]
C1616  10nF  C-EUC0402  [C0402]
R1623  47R  R-EU_R0402  [R0402]
R1631  47R  R-EU_R0402  [R0402]
R1632  47R  R-EU_R0402  [R0402]
R1643  47R  R-EU_R0402  [R0402]
R1644  47R  R-EU_R0402  [R0402]
R1651  47R  R-EU_R0402  [R0402]
R1661  N/A  R-EU_R0402  [R0402]
TP_IN_CLK1  PTR1B1,27  [B1,27]
TP_IN_CLK2  PTR1B1,27  [B1,27]
U1601  Si5338  SI5338  [QFN24_P0MM5_CTRPAD]
U1651  TS5A23166  [R-PDSO-G8]

### Nets
20MHZ_XON: C1616.1 R1661.1 ; also sheet 15
20MHZ_XOP: C1615.1 R1661.2 ; also sheet 15
+3V3_HICUR: C1601.1 C1602.1 C1603.1 C1604.1 C1605.2 U1601.7(VDD) U1601.11(VDDO3) U1601.15(VDDO2) U1601.16(VDDO1) U1601.20(VDDO0) U1601.24(VDD) ; also sheet 17,18,31
AX_8MHZ: U1601.4(IN4) ; also sheet 23
CLK0_N: R1643.2 ; also sheet 36
CLK0_P: R1644.2 ; also sheet 36
CLK2_N: R1631.2 ; also sheet 36
CLK2_P: R1632.2 ; also sheet 36
CLK_AUDIO_ADC: R1623.1 ; also sheet 17
GND: C1601.2 C1602.2 C1603.2 C1604.2 C1605.1 U1601.23(RSVD_GND) U1601.25(PAD) U1651.4 ; also sheet 1,2,3,4,5,6,7,8,9,10,11,12,13,14,15,17,18,19,21,22,23,24,25,26,27,28,29,30,31,32,33,34,35,36,37
I2C1_SCL: U1601.12(SCL) ; also sheet 5,6,8,10,14,15,17,18,25
I2C1_SDA: U1601.19(SDA) ; also sheet 5,6,8,10,14,15,17,18,25
MCU_HSE_R: R1651.2 U1651.2 U1651.5
PA8: U1601.3(IN3) ; also sheet 1
PC9: U1601.8(INTR) ; also sheet 1
PEXPA_P0_6_R: U1651.3 ; also sheet 5
PEXPA_P0_7_R: U1651.7 ; also sheet 5
PEXPA_P1_7_R: U1651.8 ; also sheet 5,30,31,32,34
PH0: R1651.1 ; also sheet 1
SI5338_CLK0A: R1644.1 U1601.22(CLK0A)
SI5338_CLK0B: R1643.1 U1601.21(CLK0B)
SI5338_CLK2A: R1632.1 U1601.14(CLK2A)
SI5338_CLK2B: R1631.1 U1601.13(CLK2B)
SI5338_CLK3A: U1601.10(CLK3A) U1651.1
SI5338_CLK3B: R1623.2 U1601.9(CLK3B)
SI5338_IN5: C1615.2 U1601.5(IN5)
SI5338_IN6: C1616.2 U1601.6(IN6)
SI5338_IN_CLK1_R: TP_IN_CLK1.TP U1601.1(IN1)
SI5338_IN_CLK2_R: TP_IN_CLK2.TP U1601.2(IN2)
XO_OUT: U1651.6 ; also sheet 15
Unconnected: U1601.17(CLK1B) U1601.18(CLK1A)

### Notes on the sheet
- Clock distributor
  I2C addr: 0x70
- Iq=45mA
- Impedance 100 Ohms
- D.C.
- D.C.
- MCU_MCO
- 8MHz
- 20MHz | Impedance 100 Ohms
- Iq=0.01uA | SW_PWR
- HSE_PLL_SW_EN
- 10MHz
- HSE_XO_SW_EN
- MCU_EXTI9_SI5338 | MCU_HSE
- Si5338 PLL
- 10MHz

## Sheet 17 of 37: I2C1 - I2S audio ADC
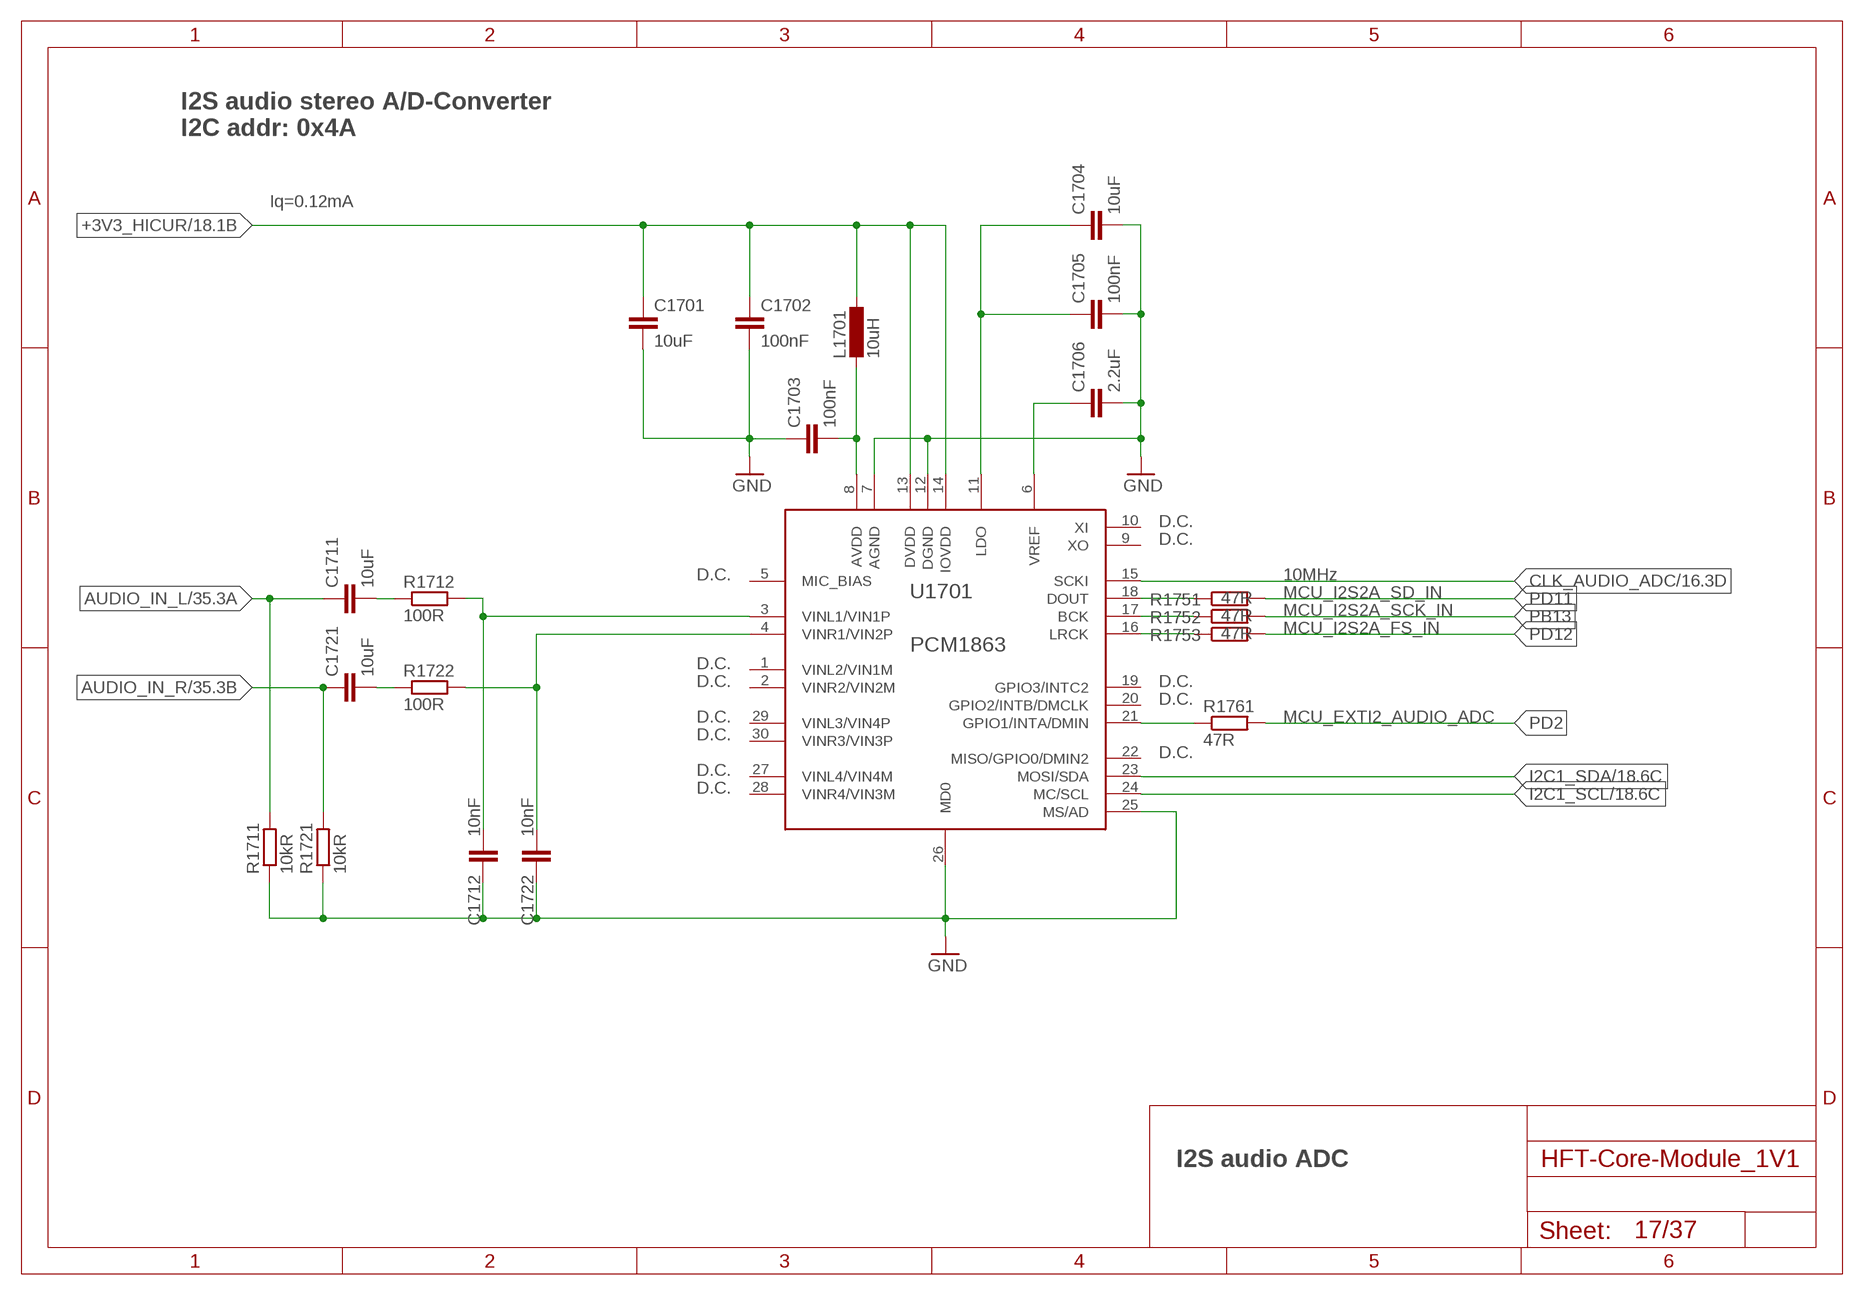
[diagram p16: schematic, sheet 17]

### Parts
C1701  10uF  C-EUC0402  [C0402]
C1702  100nF  C-EUC0402  [C0402]
C1703  100nF  C-EUC0402  [C0402]
C1704  10uF  C-EUC0402  [C0402]
C1705  100nF  C-EUC0402  [C0402]
C1706  2.2uF  C-EUC0402  [C0402]
C1711  10uF  C-EUC0402  [C0402]
C1712  10nF  C-EUC0402  [C0402]
C1721  10uF  C-EUC0402  [C0402]
C1722  10nF  C-EUC0402  [C0402]
L1701  10uH  L-EUL0603  [L0603]
R1711  10kR  R-EU_R0402  [R0402]
R1712  100R  R-EU_R0402  [R0402]
R1721  10kR  R-EU_R0402  [R0402]
R1722  100R  R-EU_R0402  [R0402]
R1751  47R  R-EU_R0402  [R0402]
R1752  47R  R-EU_R0402  [R0402]
R1753  47R  R-EU_R0402  [R0402]
R1761  47R  R-EU_R0402  [R0402]
U1701  PCM1863  [R-PDSO-G30]

### Nets
+3V3_HICUR: C1701.1 C1702.1 L1701.2 U1701.13(DVDD) U1701.14(IOVDD) ; also sheet 16,18,31
AUDIO_IN_L: C1711.1 R1711.2 ; also sheet 35
AUDIO_IN_R: C1721.1 R1721.2 ; also sheet 35
AUDIOADC_AVDD: C1703.2 L1701.1 U1701.8(AVDD)
AUDIOADC_BCK: R1752.1 U1701.17(BCK)
AUDIOADC_DOUT: R1751.1 U1701.18(DOUT)
AUDIOADC_INTA: R1761.1 U1701.21(GPIO1/INTA/DMIN)
AUDIOADC_LDO: C1704.1 C1705.1 U1701.11(LDO)
AUDIOADC_LRCK: R1753.1 U1701.16(LRCK)
AUDIOADC_VINL1: C1712.1 R1712.2 U1701.3(VINL1/VIN1P)
AUDIOADC_VINL1_R: C1711.2 R1712.1
AUDIOADC_VINR1: C1722.1 R1722.2 U1701.4(VINR1/VIN2P)
AUDIOADC_VINR1_R: C1721.2 R1722.1
AUDIOADC_VREF: C1706.1 U1701.6(VREF)
CLK_AUDIO_ADC: U1701.15(SCKI) ; also sheet 16
GND: C1701.2 C1702.2 C1703.1 C1704.2 C1705.2 C1706.2 C1712.2 C1722.2 R1711.1 R1721.1 U1701.7(AGND) U1701.12(DGND) U1701.25(MS/AD) U1701.26(MD0) ; also sheet 1,2,3,4,5,6,7,8,9,10,11,12,13,14,15,16,18,19,21,22,23,24,25,26,27,28,29,30,31,32,33,34,35,36,37
I2C1_SCL: U1701.24(MC/SCL) ; also sheet 5,6,8,10,14,15,16,18,25
I2C1_SDA: U1701.23(MOSI/SDA) ; also sheet 5,6,8,10,14,15,16,18,25
PB13: R1752.2 ; also sheet 1,36
PD2: R1761.2 ; also sheet 1
PD11: R1751.2 ; also sheet 1,36
PD12: R1753.2 ; also sheet 1,36
Unconnected: U1701.1(VINL2/VIN1M) U1701.2(VINR2/VIN2M) U1701.5(MIC_BIAS) U1701.9(XO) U1701.10(XI) U1701.19(GPIO3/INTC2) U1701.20(GPIO2/INTB/DMCLK) U1701.22(MISO/GPIO0/DMIN2) U1701.27(VINL4/VIN4M) U1701.28(VINR4/VIN3M) U1701.29(VINL3/VIN4P) U1701.30(VINR3/VIN3P)

### Notes on the sheet
- I2S audio stereo A/D-Converter
  I2C addr: 0x4A
- Iq=0.12mA
- D.C.
- D.C.
- D.C. | 10MHz
- MCU_I2S2A_SD_IN
- MCU_I2S2A_SCK_IN
- MCU_I2S2A_FS_IN
- D.C.
- D.C. | D.C.
- D.C.
- D.C. | MCU_EXTI2_AUDIO_ADC
- D.C.
- D.C.
- D.C.
- D.C.
- I2S audio ADC

## Sheet 18 of 37: I2C1 - I2S audio DAC
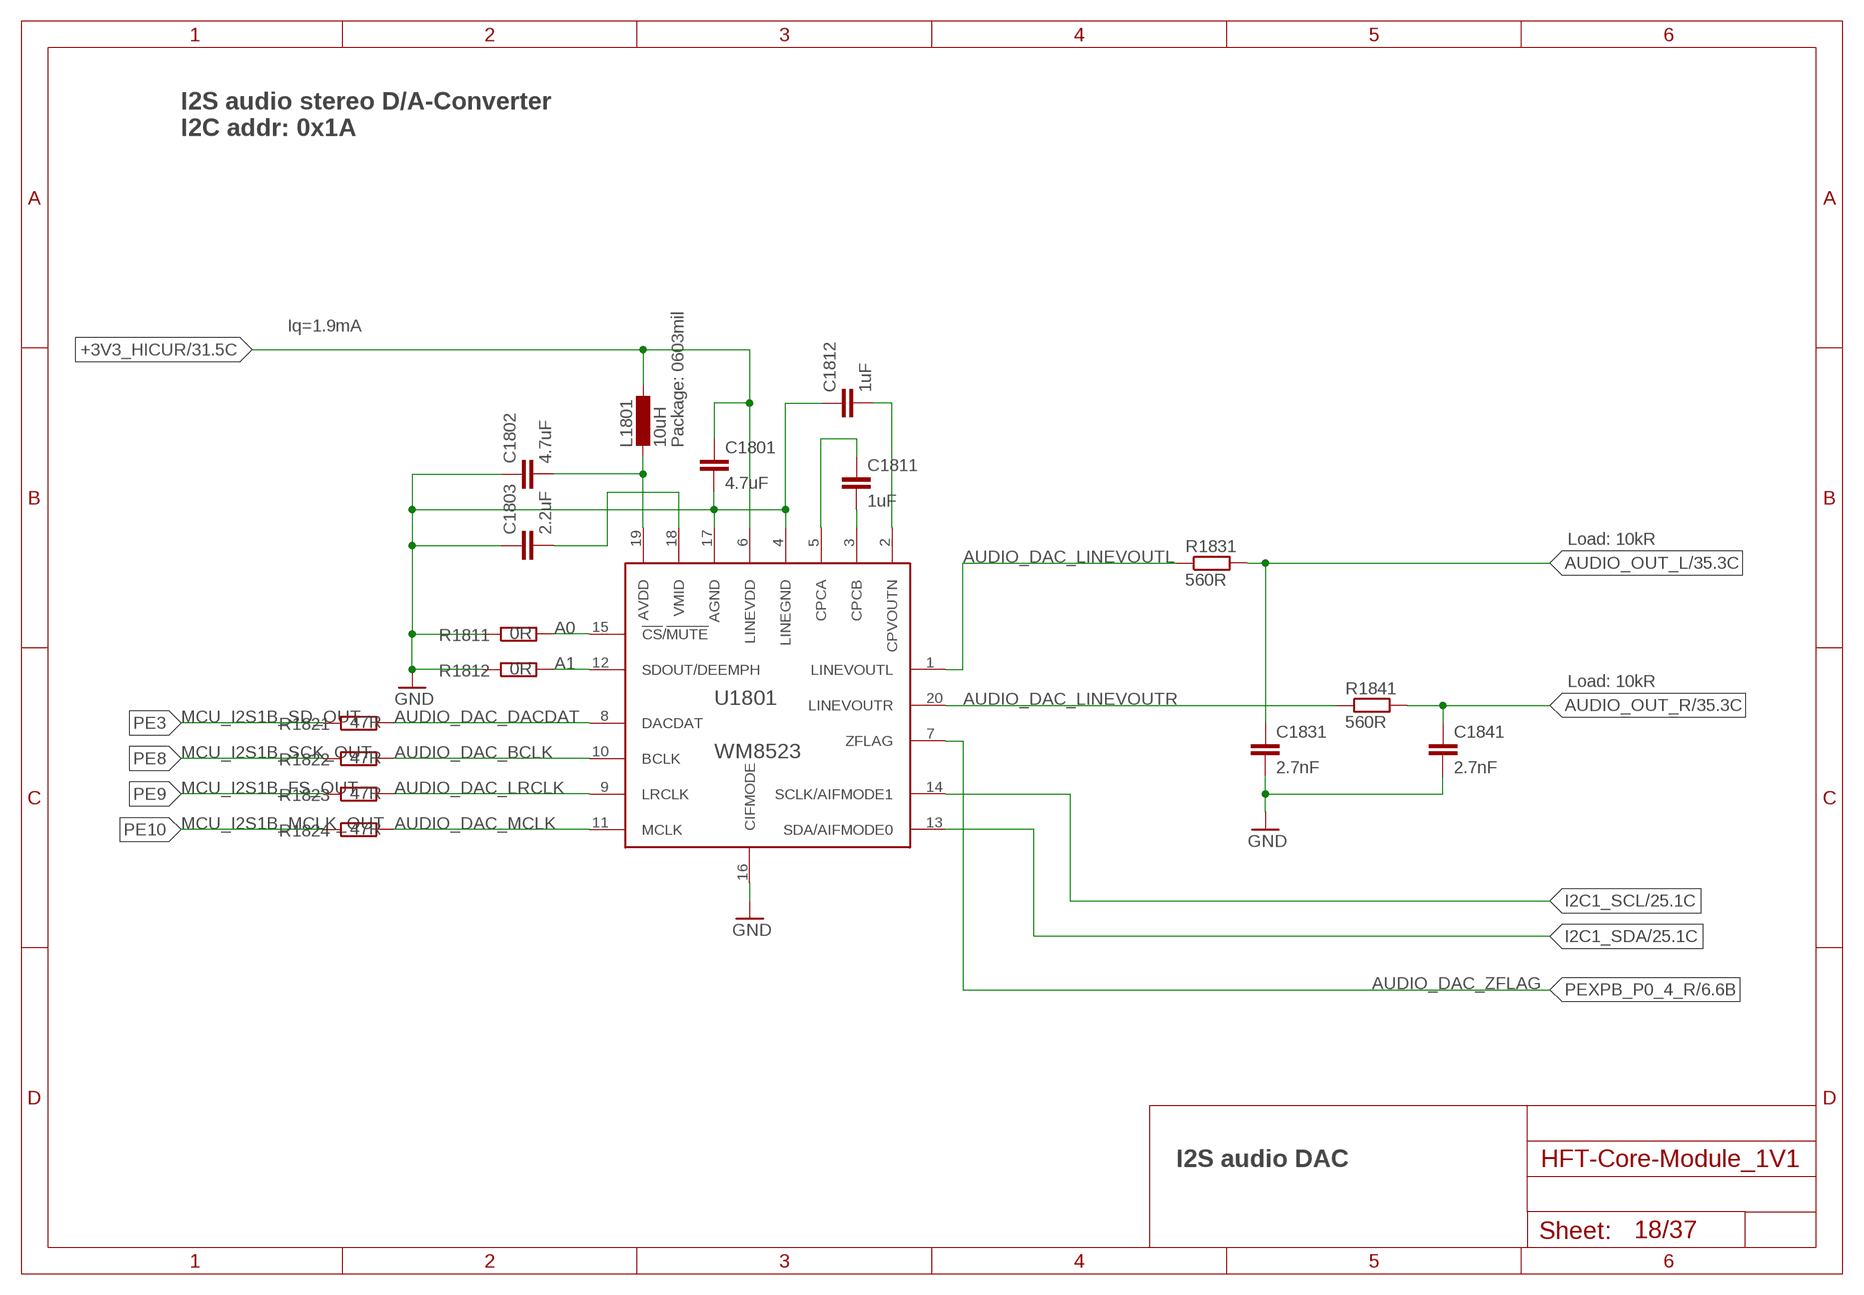
[diagram p17: schematic, sheet 18]

### Parts
C1801  4.7uF  C-EUC0402  [C0402]
C1802  4.7uF  C-EUC0402  [C0402]
C1803  2.2uF  C-EUC0402  [C0402]
C1811  1uF  C-EUC0402  [C0402]
C1812  1uF  C-EUC0402  [C0402]
C1831  2.7nF  C-EUC0402  [C0402]
C1841  2.7nF  C-EUC0402  [C0402]
L1801  10uH  L-EUL0603  [L0603]
R1811  0R  R-EU_R0402  [R0402]
R1812  0R  R-EU_R0402  [R0402]
R1821  47R  R-EU_R0402  [R0402]
R1822  47R  R-EU_R0402  [R0402]
R1823  47R  R-EU_R0402  [R0402]
R1824  47R  R-EU_R0402  [R0402]
R1831  560R  R-EU_R0402  [R0402]
R1841  560R  R-EU_R0402  [R0402]
U1801  WM8523  [TSSOP20]

### Nets
+3V3_HICUR: C1801.1 L1801.2 U1801.6(LINEVDD) ; also sheet 16,17,31
AUDIO_DAC_A0: R1811.2 U1801.15(!CS!/!MUTE)
AUDIO_DAC_A1: R1812.2 U1801.12(SDOUT/DEEMPH)
AUDIO_DAC_AVDD: C1802.2 L1801.1 U1801.19(AVDD)
AUDIO_DAC_BCLK: R1822.2 U1801.10(BCLK)
AUDIO_DAC_CPCA: C1811.1 U1801.5(CPCA)
AUDIO_DAC_CPCB: C1811.2 U1801.3(CPCB)
AUDIO_DAC_CPVOUTN: C1812.2 U1801.2(CPVOUTN)
AUDIO_DAC_DACDAT: R1821.2 U1801.8(DACDAT)
AUDIO_DAC_LINEVOUTL: R1831.1 U1801.1(LINEVOUTL)
AUDIO_DAC_LINEVOUTR: R1841.1 U1801.20(LINEVOUTR)
AUDIO_DAC_LRCLK: R1823.2 U1801.9(LRCLK)
AUDIO_DAC_MCLK: R1824.2 U1801.11(MCLK)
AUDIO_DAC_VMID: C1803.2 U1801.18(VMID)
AUDIO_OUT_L: C1831.1 R1831.2 ; also sheet 35
AUDIO_OUT_R: C1841.1 R1841.2 ; also sheet 35
GND: C1801.2 C1802.1 C1803.1 C1812.1 C1831.2 C1841.2 R1811.1 R1812.1 U1801.4(LINEGND) U1801.16(CIFMODE) U1801.17(AGND) ; also sheet 1,2,3,4,5,6,7,8,9,10,11,12,13,14,15,16,17,19,21,22,23,24,25,26,27,28,29,30,31,32,33,34,35,36,37
I2C1_SCL: U1801.14(SCLK/AIFMODE1) ; also sheet 5,6,8,10,14,15,16,17,25
I2C1_SDA: U1801.13(SDA/AIFMODE0) ; also sheet 5,6,8,10,14,15,16,17,25
PE3: R1821.1 ; also sheet 1,36
PE8: R1822.1 ; also sheet 1,36
PE9: R1823.1 ; also sheet 1,36
PE10: R1824.1 ; also sheet 1,36
PEXPB_P0_4_R: U1801.7(ZFLAG) ; also sheet 6

### Notes on the sheet
- I2S audio stereo D/A-Converter
  I2C addr: 0x1A
- Iq=1.9mA
- Package: 0603mil
- Load: 10kR
- A0
- A1
- Load: 10kR
- MCU_I2S1B_SD_OUT
- MCU_I2S1B_SCK_OUT
- MCU_I2S1B_FS_OUT
- MCU_I2S1B_MCLK_OUT
- AUDIO_DAC_ZFLAG
- I2S audio DAC

## Sheet 19 of 37: UART1 - SIM868 GSM/GPRS/GNSS
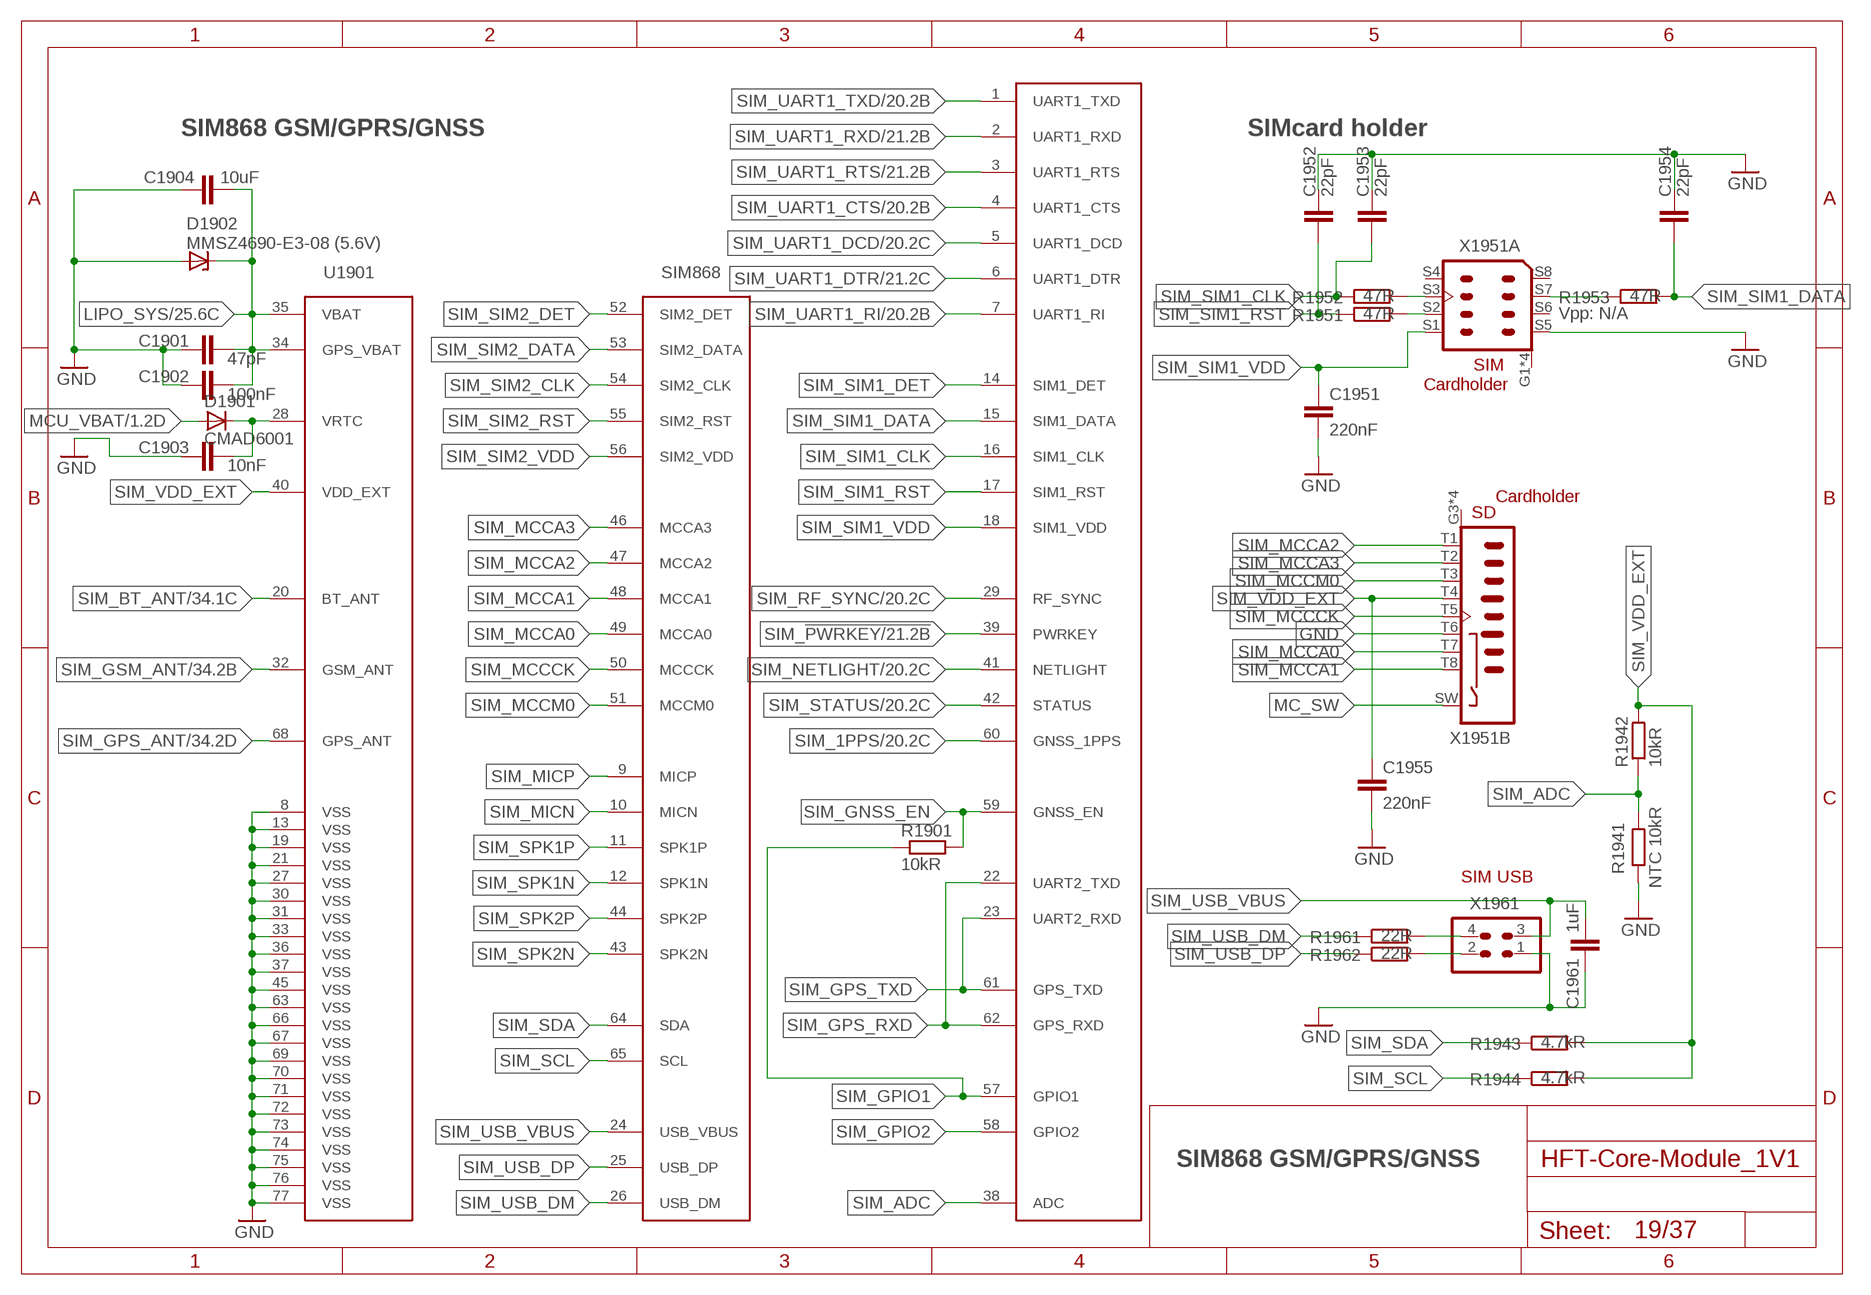
[diagram p18: schematic, sheet 19]

### Parts
C1901  47pF  C-EUC0402  [C0402]
C1902  100nF  C-EUC0402  [C0402]
C1903  10nF  C-EUC0402  [C0402]
C1904  10uF  C-EUC0402  [C0402]
C1951  220nF  C-EUC0402  [C0402]
C1952  22pF  C-EUC0402  [C0402]
C1953  22pF  C-EUC0402  [C0402]
C1954  22pF  C-EUC0402  [C0402]
C1955  220nF  C-EUC0402  [C0402]
C1961  1uF  C-EUC0402  [C0402]
D1901  CMAD6001  D_SOD923  [SOD923]
D1902  MMSZ4690-E3-08 (5.6V)  ZENER-DIODESOD123  [SOD123]
R1901  10kR  R-EU_R0402  [R0402]
R1941  NTC 10kR  R-EU_R0402  [R0402]
R1942  10kR  R-EU_R0402  [R0402]
R1943  4.7kR  R-EU_R0402  [R0402]
R1944  4.7kR  R-EU_R0402  [R0402]
R1951  47R  R-EU_R0402  [R0402]
R1952  47R  R-EU_R0402  [R0402]
R1953  47R  R-EU_R0402  [R0402]
R1961  22R  R-EU_R0402  [R0402]
R1962  22R  R-EU_R0402  [R0402]
U1901  SIM868  [SIM868]
X1951  MICROSIM-8P_SDCARD-8P_MOLEX-104642-1610  [MICROSIM-8P_SDCARD-8P_MOLEX-104642-1610]
X1961  HEADER-2X2  [2X02]

### Nets
GND: C1901.1 C1902.1 C1903.1 C1904.1 C1951.2 C1952.1 C1953.1 C1954.1 C1955.2 C1961.1 D1902.A R1941.1 U1901.8(VSS) U1901.13(VSS) U1901.19(VSS) U1901.21(VSS) U1901.27(VSS) U1901.30(VSS) U1901.31(VSS) U1901.33(VSS) U1901.36(VSS) U1901.37(VSS) U1901.45(VSS) U1901.63(VSS) U1901.66(VSS) U1901.67(VSS) U1901.69(VSS) U1901.70(VSS) U1901.71(VSS) U1901.72(VSS) U1901.73(VSS) U1901.74(VSS) U1901.75(VSS) U1901.76(VSS) U1901.77(VSS) X1951.S5(A:S5) X1951.T6(B:T6) X1961.1 ; also sheet 1,2,3,4,5,6,7,8,9,10,11,12,13,14,15,16,17,18,21,22,23,24,25,26,27,28,29,30,31,32,33,34,35,36,37
LIPO_SYS: C1901.2 C1902.2 C1904.2 D1902.C U1901.34(GPS_VBAT) U1901.35(VBAT) ; also sheet 25
MC_SW: X1951.SW(B:SW)
MCU_VBAT: D1901.A ; also sheet 1,4
SC_2: R1951.2 X1951.S2(A:S2)
SC_3: R1952.2 X1951.S3(A:S3)
SC_7: R1953.1 X1951.S7(A:S7)
SIM_1PPS: U1901.60(GNSS_1PPS) ; also sheet 20
SIM_!PWRKEY: U1901.39(PWRKEY) ; also sheet 21
SIM_ADC: R1941.2 R1942.1 U1901.38(ADC)
SIM_BT_ANT [single50R_1-2_15-16]: U1901.20(BT_ANT) ; also sheet 34
SIM_GNSS_EN: R1901.2 U1901.59(GNSS_EN)
SIM_GPIO1: R1901.1 U1901.57(GPIO1)
SIM_GPIO2: U1901.58(GPIO2)
SIM_GPS_ANT [single50R_1-2_15-16]: U1901.68(GPS_ANT) ; also sheet 34
SIM_GPS_RXD: U1901.22(UART2_TXD) U1901.62(GPS_RXD)
SIM_GPS_TXD: U1901.23(UART2_RXD) U1901.61(GPS_TXD)
SIM_GSM_ANT [single50R_1-2_15-16]: U1901.32(GSM_ANT) ; also sheet 34
SIM_MCCA0: U1901.49(MCCA0) X1951.T7(B:T7)
SIM_MCCA1: U1901.48(MCCA1) X1951.T8(B:T8)
SIM_MCCA2: U1901.47(MCCA2) X1951.T1(B:T1)
SIM_MCCA3: U1901.46(MCCA3) X1951.T2(B:T2)
SIM_MCCCK: U1901.50(MCCCK) X1951.T5(B:T5)
SIM_MCCM0: U1901.51(MCCM0) X1951.T3(B:T3)
SIM_MICN: U1901.10(MICN)
SIM_MICP: U1901.9(MICP)
SIM_NETLIGHT: U1901.41(NETLIGHT) ; also sheet 20
SIM_RF_SYNC: U1901.29(RF_SYNC) ; also sheet 20
SIM_SCL: R1944.1 U1901.65(SCL)
SIM_SDA: R1943.1 U1901.64(SDA)
SIM_SIM1_CLK: C1953.2 R1952.1 U1901.16(SIM1_CLK)
SIM_SIM1_DATA: C1954.2 R1953.2 U1901.15(SIM1_DATA)
SIM_SIM1_DET: U1901.14(SIM1_DET)
SIM_SIM1_RST: C1952.2 R1951.1 U1901.17(SIM1_RST)
SIM_SIM1_VDD: C1951.1 U1901.18(SIM1_VDD) X1951.S1(A:S1)
SIM_SIM2_CLK: U1901.54(SIM2_CLK)
SIM_SIM2_DATA: U1901.53(SIM2_DATA)
SIM_SIM2_DET: U1901.52(SIM2_DET)
SIM_SIM2_RST: U1901.55(SIM2_RST)
SIM_SIM2_VDD: U1901.56(SIM2_VDD)
SIM_SPK1N: U1901.12(SPK1N)
SIM_SPK1P: U1901.11(SPK1P)
SIM_SPK2N: U1901.43(SPK2N)
SIM_SPK2P: U1901.44(SPK2P)
SIM_STATUS: U1901.42(STATUS) ; also sheet 20
SIM_UART1_CTS: U1901.4(UART1_CTS) ; also sheet 20
SIM_UART1_DCD: U1901.5(UART1_DCD) ; also sheet 20
SIM_UART1_DTR: U1901.6(UART1_DTR) ; also sheet 21
SIM_UART1_RI: U1901.7(UART1_RI) ; also sheet 20
SIM_UART1_RTS: U1901.3(UART1_RTS) ; also sheet 21
SIM_UART1_RXD: U1901.2(UART1_RXD) ; also sheet 21
SIM_UART1_TXD: U1901.1(UART1_TXD) ; also sheet 20
SIM_USB_DM: R1961.1 U1901.26(USB_DM)
SIM_USB_DP: R1962.1 U1901.25(USB_DP)
SIM_USB_VBUS: C1961.2 U1901.24(USB_VBUS) X1961.3
SIM_USBCON_DM: R1961.2 X1961.4
SIM_USBCON_DP: R1962.2 X1961.2
SIM_VDD_EXT: C1955.1 R1942.2 R1943.2 R1944.2 U1901.40(VDD_EXT) X1951.T4(B:T4)
SIM_VRTC: C1903.2 D1901.C U1901.28(VRTC)
Unconnected: X1951.G1(A:SHIELD) X1951.G2(A:SHIELD) X1951.G3(B:SHIELD) X1951.G4(B:SHIELD) X1951.G5(B:SHIELD) X1951.G6(B:SHIELD) X1951.G7(A:SHIELD) X1951.G8(A:SHIELD) X1951.S4(A:S4) X1951.S8(A:S8)

### Notes on the sheet
- SIM868 GSM/GPRS/GNSS | SIMcard holder
- Vpp: N/A
- SIM USB
- SIM868 GSM/GPRS/GNSS

## Sheet 20 of 37: SIM868 Level-Shifter A
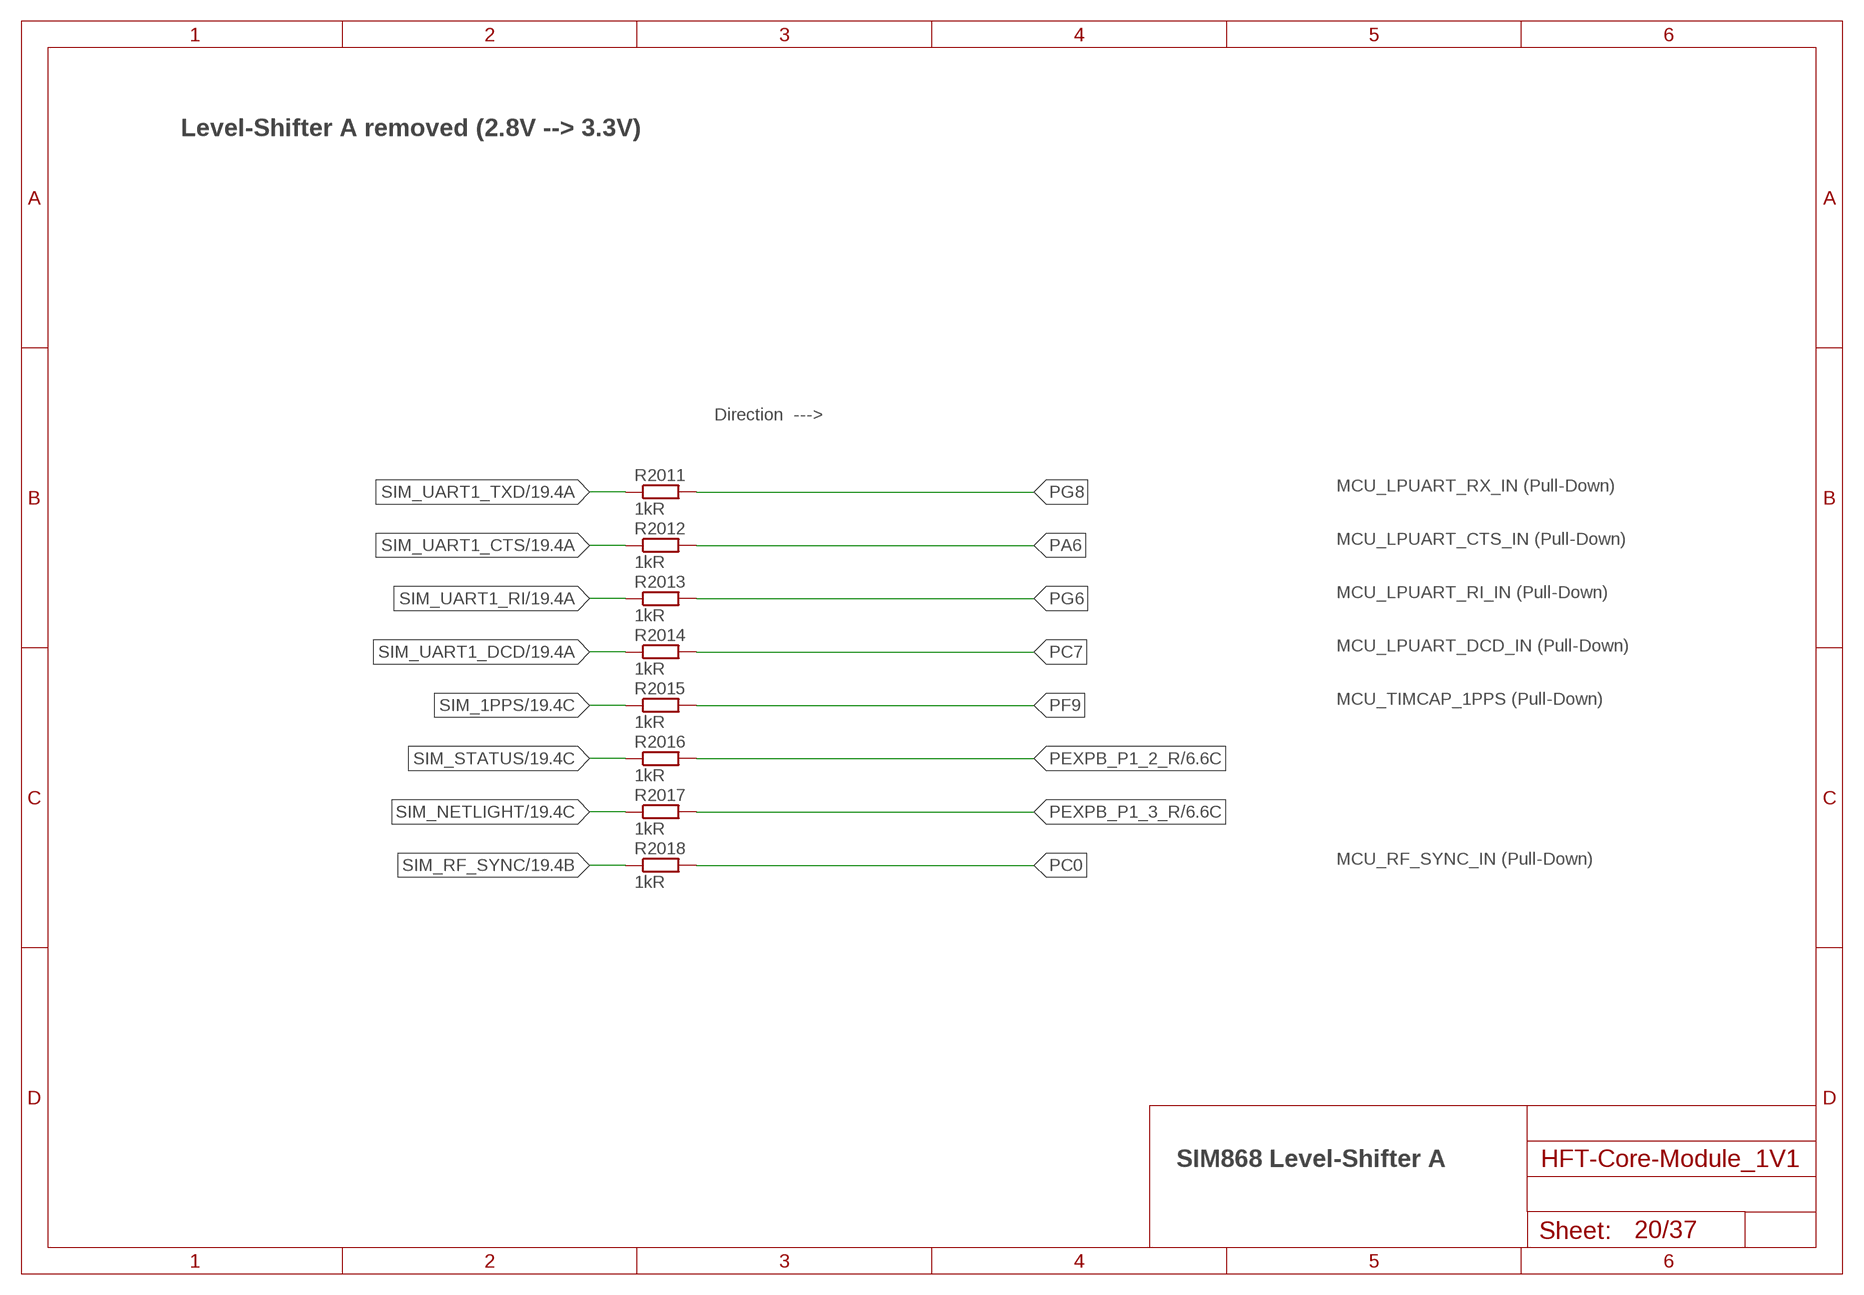
[diagram p19: schematic, sheet 20]

### Parts
R2011  1kR  R-EU_R0402  [R0402]
R2012  1kR  R-EU_R0402  [R0402]
R2013  1kR  R-EU_R0402  [R0402]
R2014  1kR  R-EU_R0402  [R0402]
R2015  1kR  R-EU_R0402  [R0402]
R2016  1kR  R-EU_R0402  [R0402]
R2017  1kR  R-EU_R0402  [R0402]
R2018  1kR  R-EU_R0402  [R0402]

### Nets
PA6: R2012.2 ; also sheet 1
PC0: R2018.2 ; also sheet 1
PC7: R2014.2 ; also sheet 1
PEXPB_P1_2_R: R2016.2 ; also sheet 6
PEXPB_P1_3_R: R2017.2 ; also sheet 6
PF9: R2015.2 ; also sheet 1
PG6: R2013.2 ; also sheet 1
PG8: R2011.2 ; also sheet 1
SIM_1PPS: R2015.1 ; also sheet 19
SIM_NETLIGHT: R2017.1 ; also sheet 19
SIM_RF_SYNC: R2018.1 ; also sheet 19
SIM_STATUS: R2016.1 ; also sheet 19
SIM_UART1_CTS: R2012.1 ; also sheet 19
SIM_UART1_DCD: R2014.1 ; also sheet 19
SIM_UART1_RI: R2013.1 ; also sheet 19
SIM_UART1_TXD: R2011.1 ; also sheet 19

### Notes on the sheet
- Level-Shifter A removed (2.8V --> 3.3V)
- Direction  --->
- MCU_LPUART_RX_IN (Pull-Down)
- MCU_LPUART_CTS_IN (Pull-Down)
- MCU_LPUART_RI_IN (Pull-Down)
- MCU_LPUART_DCD_IN (Pull-Down)
- MCU_TIMCAP_1PPS (Pull-Down)
- MCU_RF_SYNC_IN (Pull-Down)
- SIM868 Level-Shifter A

## Sheet 21 of 37: SIM868 Level-Shifter B
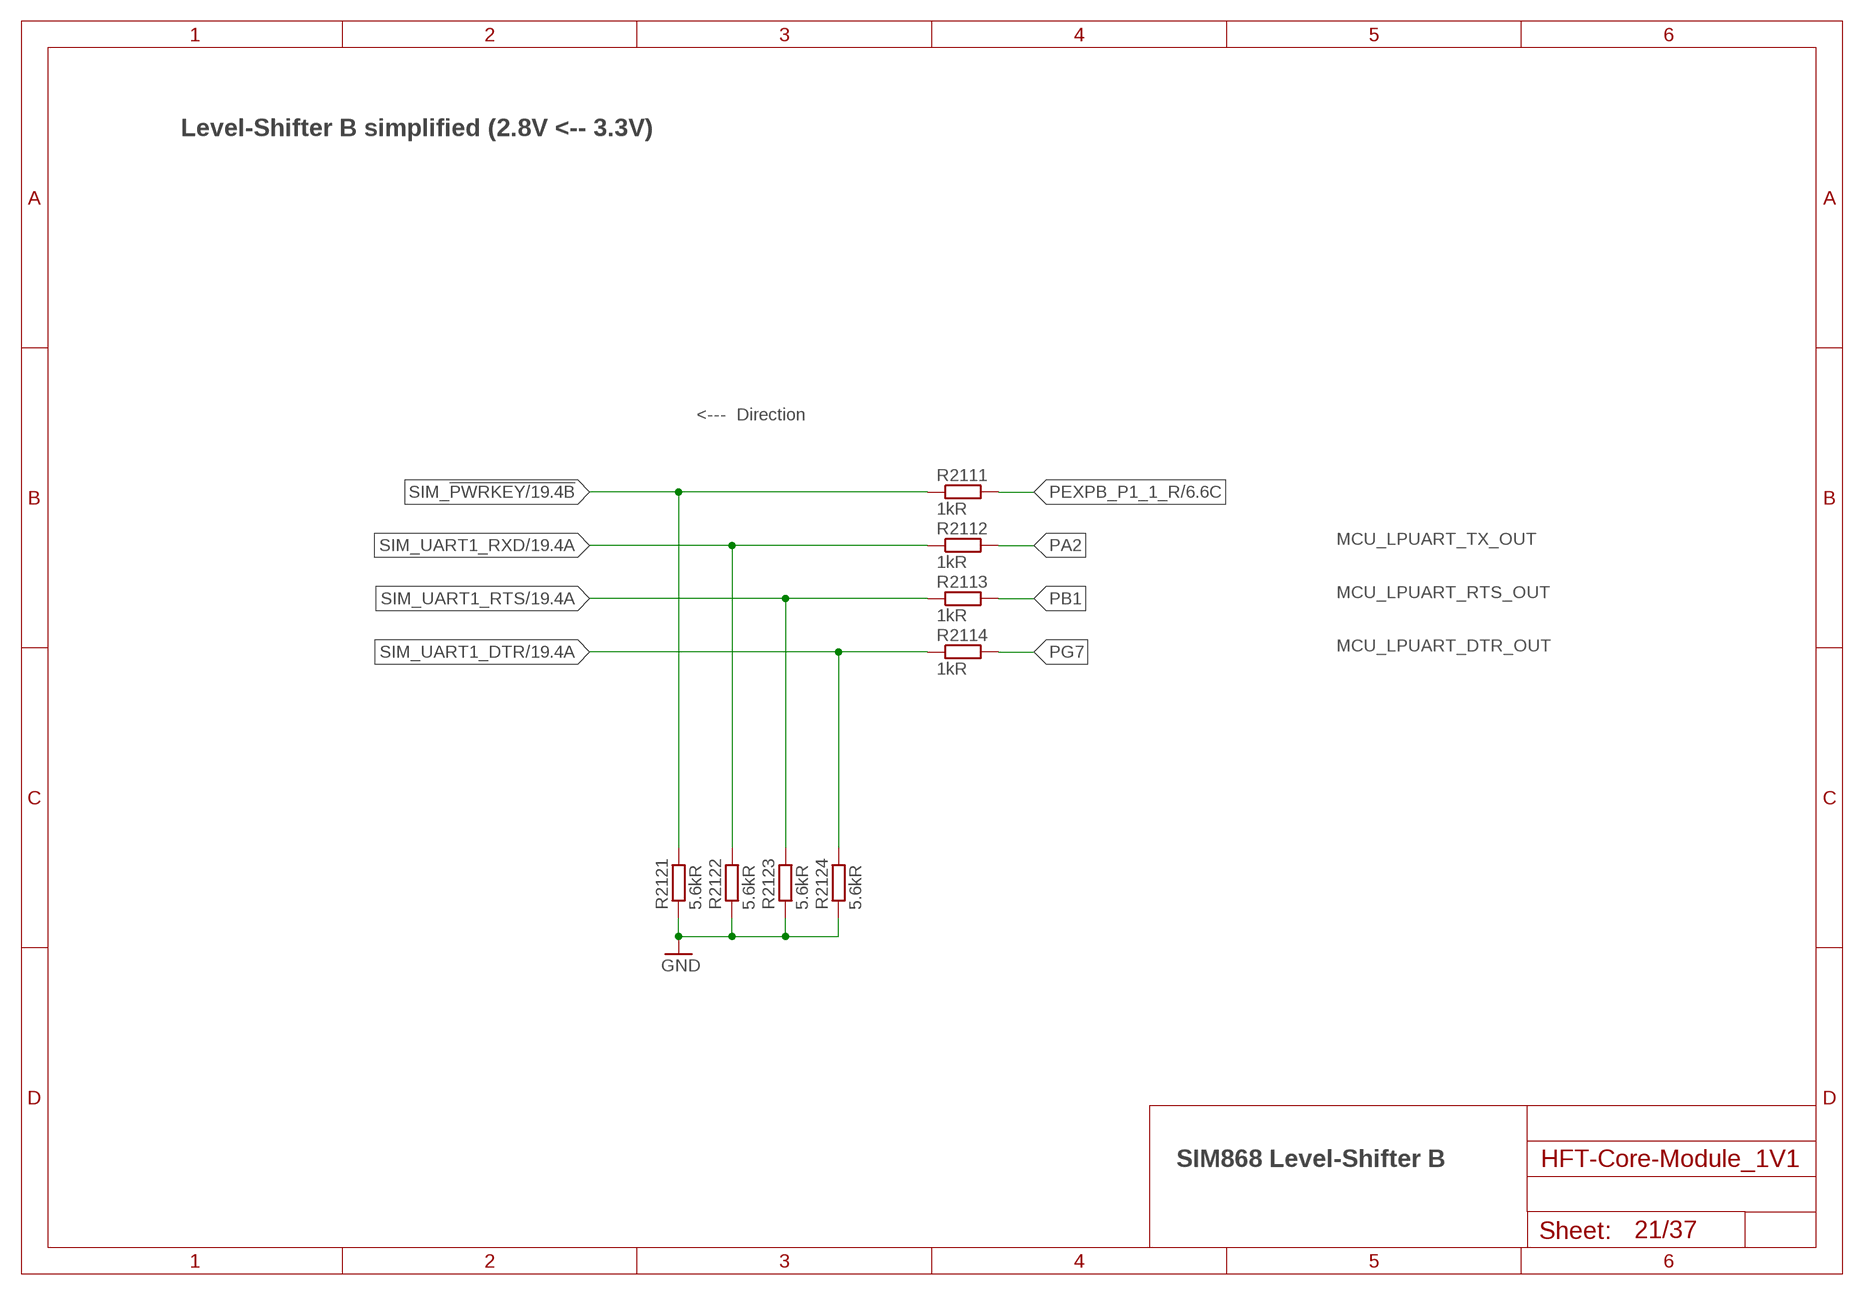
[diagram p20: schematic, sheet 21]

### Parts
R2111  1kR  R-EU_R0402  [R0402]
R2112  1kR  R-EU_R0402  [R0402]
R2113  1kR  R-EU_R0402  [R0402]
R2114  1kR  R-EU_R0402  [R0402]
R2121  5.6kR  R-EU_R0402  [R0402]
R2122  5.6kR  R-EU_R0402  [R0402]
R2123  5.6kR  R-EU_R0402  [R0402]
R2124  5.6kR  R-EU_R0402  [R0402]

### Nets
GND: R2121.1 R2122.1 R2123.1 R2124.1 ; also sheet 1,2,3,4,5,6,7,8,9,10,11,12,13,14,15,16,17,18,19,22,23,24,25,26,27,28,29,30,31,32,33,34,35,36,37
PA2: R2112.2 ; also sheet 1
PB1: R2113.2 ; also sheet 1
PEXPB_P1_1_R: R2111.2 ; also sheet 6
PG7: R2114.2 ; also sheet 1
SIM_!PWRKEY: R2111.1 R2121.2 ; also sheet 19
SIM_UART1_DTR: R2114.1 R2124.2 ; also sheet 19
SIM_UART1_RTS: R2113.1 R2123.2 ; also sheet 19
SIM_UART1_RXD: R2112.1 R2122.2 ; also sheet 19

### Notes on the sheet
- Level-Shifter B simplified (2.8V <-- 3.3V)
- <---  Direction
- MCU_LPUART_TX_OUT
- MCU_LPUART_RTS_OUT
- MCU_LPUART_DTR_OUT
- SIM868 Level-Shifter B

## Sheet 22 of 37: SPI3 - VHF/UHF SX1262 - ch 1
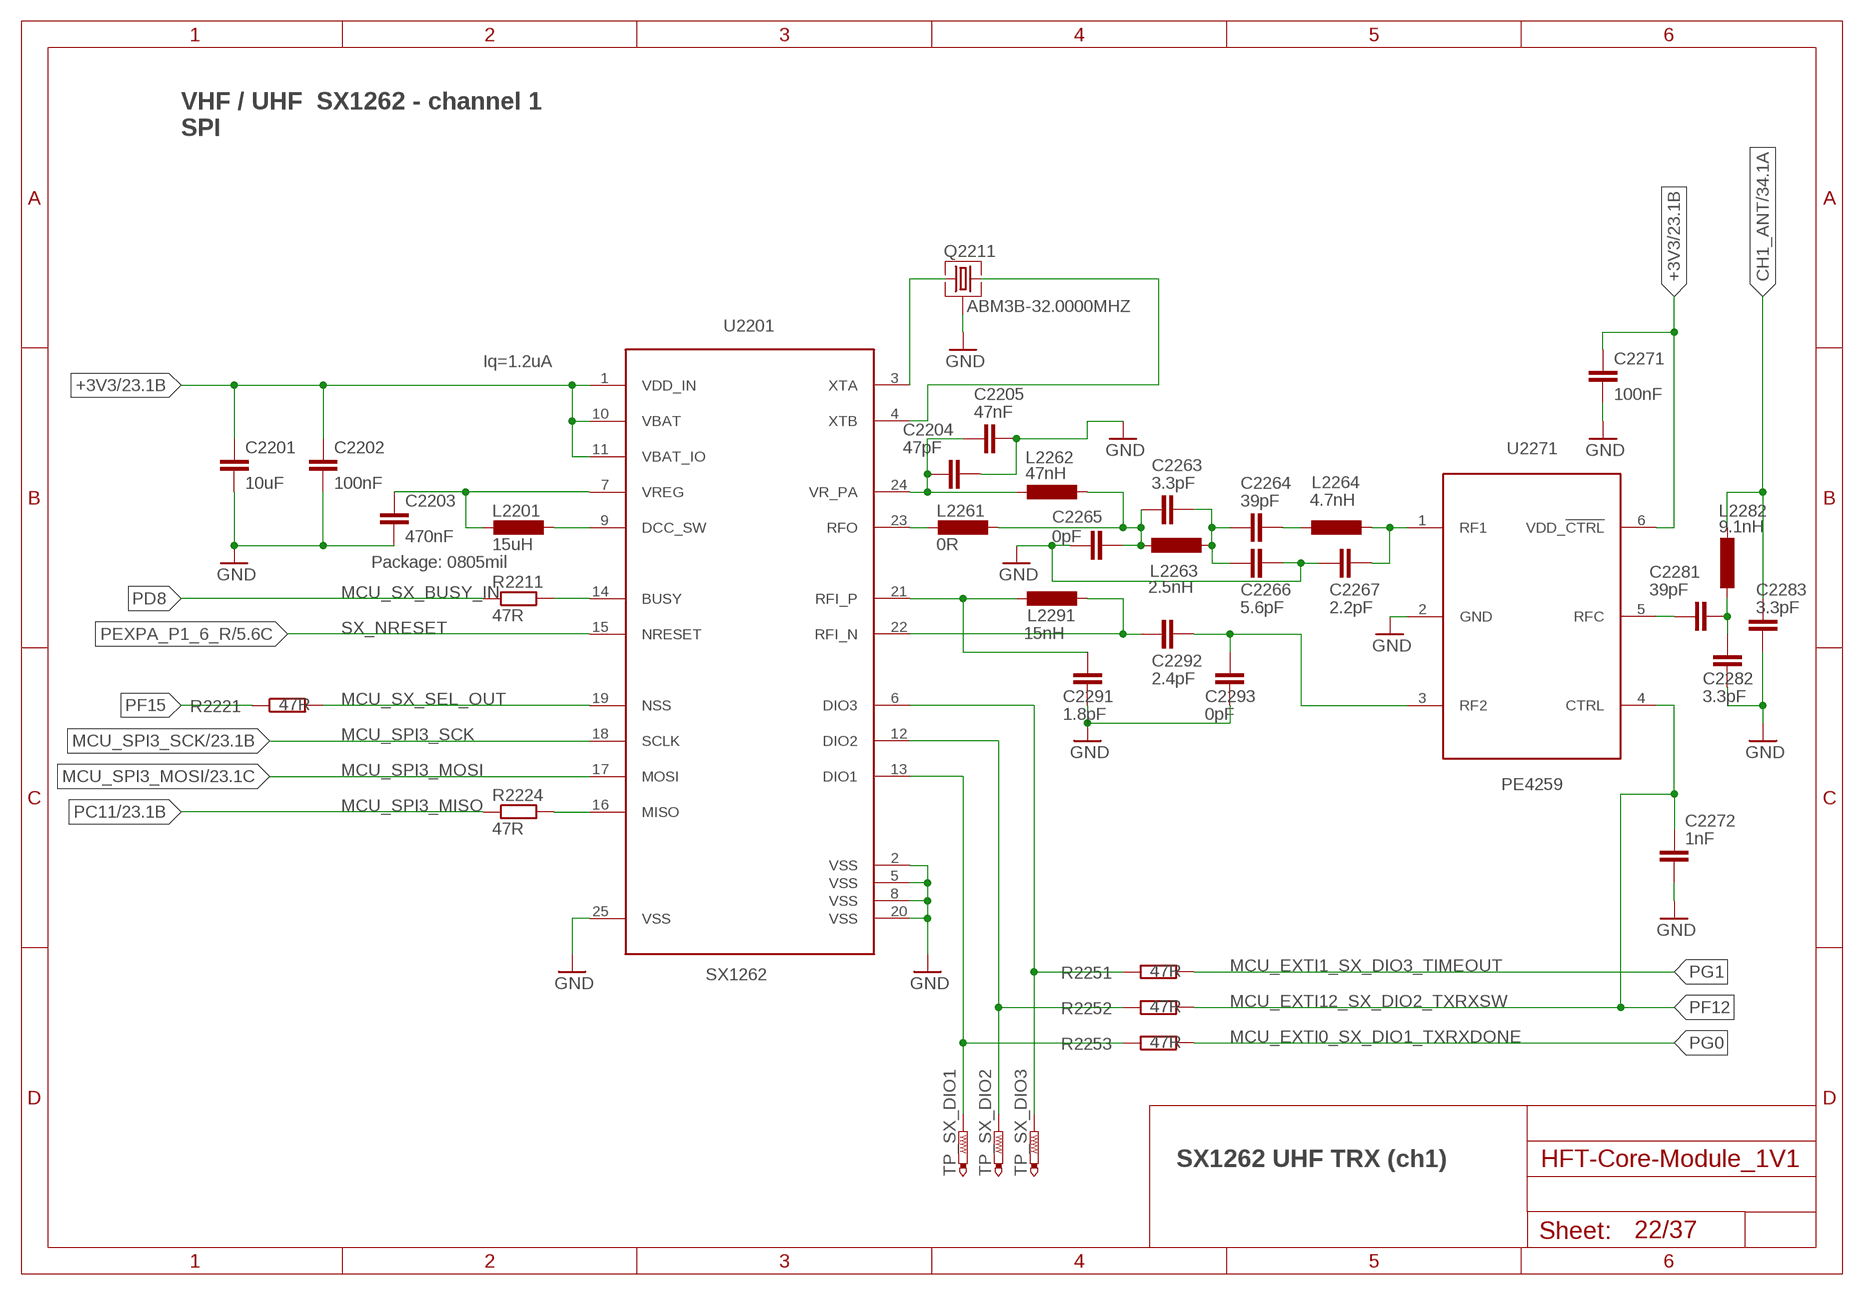
[diagram p21: schematic, sheet 22]

### Parts
C2201  10uF  C-EUC0402  [C0402]
C2202  100nF  C-EUC0402  [C0402]
C2203  470nF  C-EUC0402  [C0402]
C2204  47pF  C-EUC0402  [C0402]
C2205  47nF  C-EUC0402  [C0402]
C2263  3.3pF  C-EUC0402  [C0402]
C2264  39pF  C-EUC0402  [C0402]
C2265  0pF  C-EUC0402  [C0402]
C2266  5.6pF  C-EUC0402  [C0402]
C2267  2.2pF  C-EUC0402  [C0402]
C2271  100nF  C-EUC0402  [C0402]
C2272  1nF  C-EUC0402  [C0402]
C2281  39pF  C-EUC0402  [C0402]
C2282  3.3pF  C-EUC0402  [C0402]
C2283  3.3pF  C-EUC0402  [C0402]
C2291  1.8pF  C-EUC0402  [C0402]
C2292  2.4pF  C-EUC0402  [C0402]
C2293  0pF  C-EUC0402  [C0402]
L2201  15uH  L-EU3.00X3.00MM  [L_3.00MM_X_3.00MM]
L2261  0R  L-EUL0603  [L0603]
L2262  47nH  L-EUL0603  [L0603]
L2263  2.5nH  L-EUL0603  [L0603]
L2264  4.7nH  L-EUL0603  [L0603]
L2282  9.1nH  L-EUL0603  [L0603]
L2291  15nH  L-EUL0603  [L0603]
Q2211  ABM3B-32.0000MHZ  [ABM3B]
R2211  47R  R-EU_R0402  [R0402]
R2221  47R  R-EU_R0402  [R0402]
R2224  47R  R-EU_R0402  [R0402]
R2251  47R  R-EU_R0402  [R0402]
R2252  47R  R-EU_R0402  [R0402]
R2253  47R  R-EU_R0402  [R0402]
TP_SX_DIO1  PTR1TP06R  [TP06R]
TP_SX_DIO2  PTR1TP06R  [TP06R]
TP_SX_DIO3  PTR1TP06R  [TP06R]
U2201  SX1262  [QFN24-4X4-0P5-PAD]
U2271  PE4259  [SC-70_6-LEAD_2X1MM25_0P65]

### Nets
+3V3: C2201.1 C2202.1 C2271.1 U2201.1(VDD_IN) U2201.10(VBAT) U2201.11(VBAT_IO) U2271.6(VDD_!CTRL) ; also sheet 2,4,5,6,7,8,9,10,11,13,14,15,23,25,26,27,28,30,31,34,36
CH1_ANT: C2283.2 L2282.1 ; also sheet 34
GND: C2201.2 C2202.2 C2203.2 C2204.2 C2205.2 C2265.1 C2266.2 C2267.2 C2271.2 C2272.2 C2282.1 C2283.1 C2291.1 C2293.1 Q2211.2 Q2211.4 U2201.2(VSS) U2201.5(VSS) U2201.8(VSS) U2201.20(VSS) U2201.25(VSS) U2271.2(GND) ; also sheet 1,2,3,4,5,6,7,8,9,10,11,12,13,14,15,16,17,18,19,21,23,24,25,26,27,28,29,30,31,32,33,34,35,36,37
MCU_SPI3_MOSI: U2201.17(MOSI) ; also sheet 9,13,23
MCU_SPI3_SCK: U2201.18(SCLK) ; also sheet 9,13,23
MCU_SX_SEL_OUT: R2221.2 U2201.19(NSS)
PC11: R2224.1 ; also sheet 1,13,23
PD8: R2211.1 ; also sheet 1
PE_RFC: C2281.1 U2271.5(RFC)
PE_RFC_2: C2281.2 C2282.2 L2282.2
PEXPA_P1_6_R: U2201.15(NRESET) ; also sheet 5
PF12: C2272.1 R2252.2 U2271.4(CTRL) ; also sheet 1
PF15: R2221.1 ; also sheet 1
PG0: R2253.2 ; also sheet 1
PG1: R2251.2 ; also sheet 1
SX_BUSY: R2211.2 U2201.14(BUSY)
SX_DCC_SW: L2201.1 U2201.9(DCC_SW)
SX_DIO1: R2253.1 TP_SX_DIO1.TP U2201.13(DIO1)
SX_DIO2: R2252.1 TP_SX_DIO2.TP U2201.12(DIO2)
SX_DIO3: R2251.1 TP_SX_DIO3.TP U2201.6(DIO3)
SX_MISO: R2224.2 U2201.16(MISO)
SX_RFI_2: C2292.2 C2293.2 U2271.3(RF2)
SX_RFI_N: C2292.1 L2291.1 U2201.22(RFI_N)
SX_RFI_P: C2291.2 L2291.2 U2201.21(RFI_P)
SX_RFO: L2261.2 U2201.23(RFO)
SX_RFO_2: C2263.1 C2265.2 L2261.1 L2262.1 L2263.2
SX_RFO_3: C2263.2 C2264.1 C2266.1 L2263.1
SX_RFO_4: C2264.2 L2264.2
SX_RFO_5: C2267.1 L2264.1 U2271.1(RF1)
SX_VR_PA: C2204.1 C2205.1 L2262.2 U2201.24(VR_PA)
SX_VREG: C2203.1 L2201.2 U2201.7(VREG)
SX_XTA: Q2211.1 U2201.3(XTA)
SX_XTB: Q2211.3 U2201.4(XTB)

### Notes on the sheet
- VHF / UHF  SX1262 - channel 1
  SPI
- Iq=1.2uA
- Package: 0805mil
- MCU_SX_BUSY_IN
- SX_NRESET
- MCU_SPI3_MISO
- MCU_EXTI1_SX_DIO3_TIMEOUT
- MCU_EXTI12_SX_DIO2_TXRXSW
- MCU_EXTI0_SX_DIO1_TXRXDONE
- SX1262 UHF TRX (ch1)

## Sheet 23 of 37: SPI3 - VHF/UHF AX5243 - ch 2
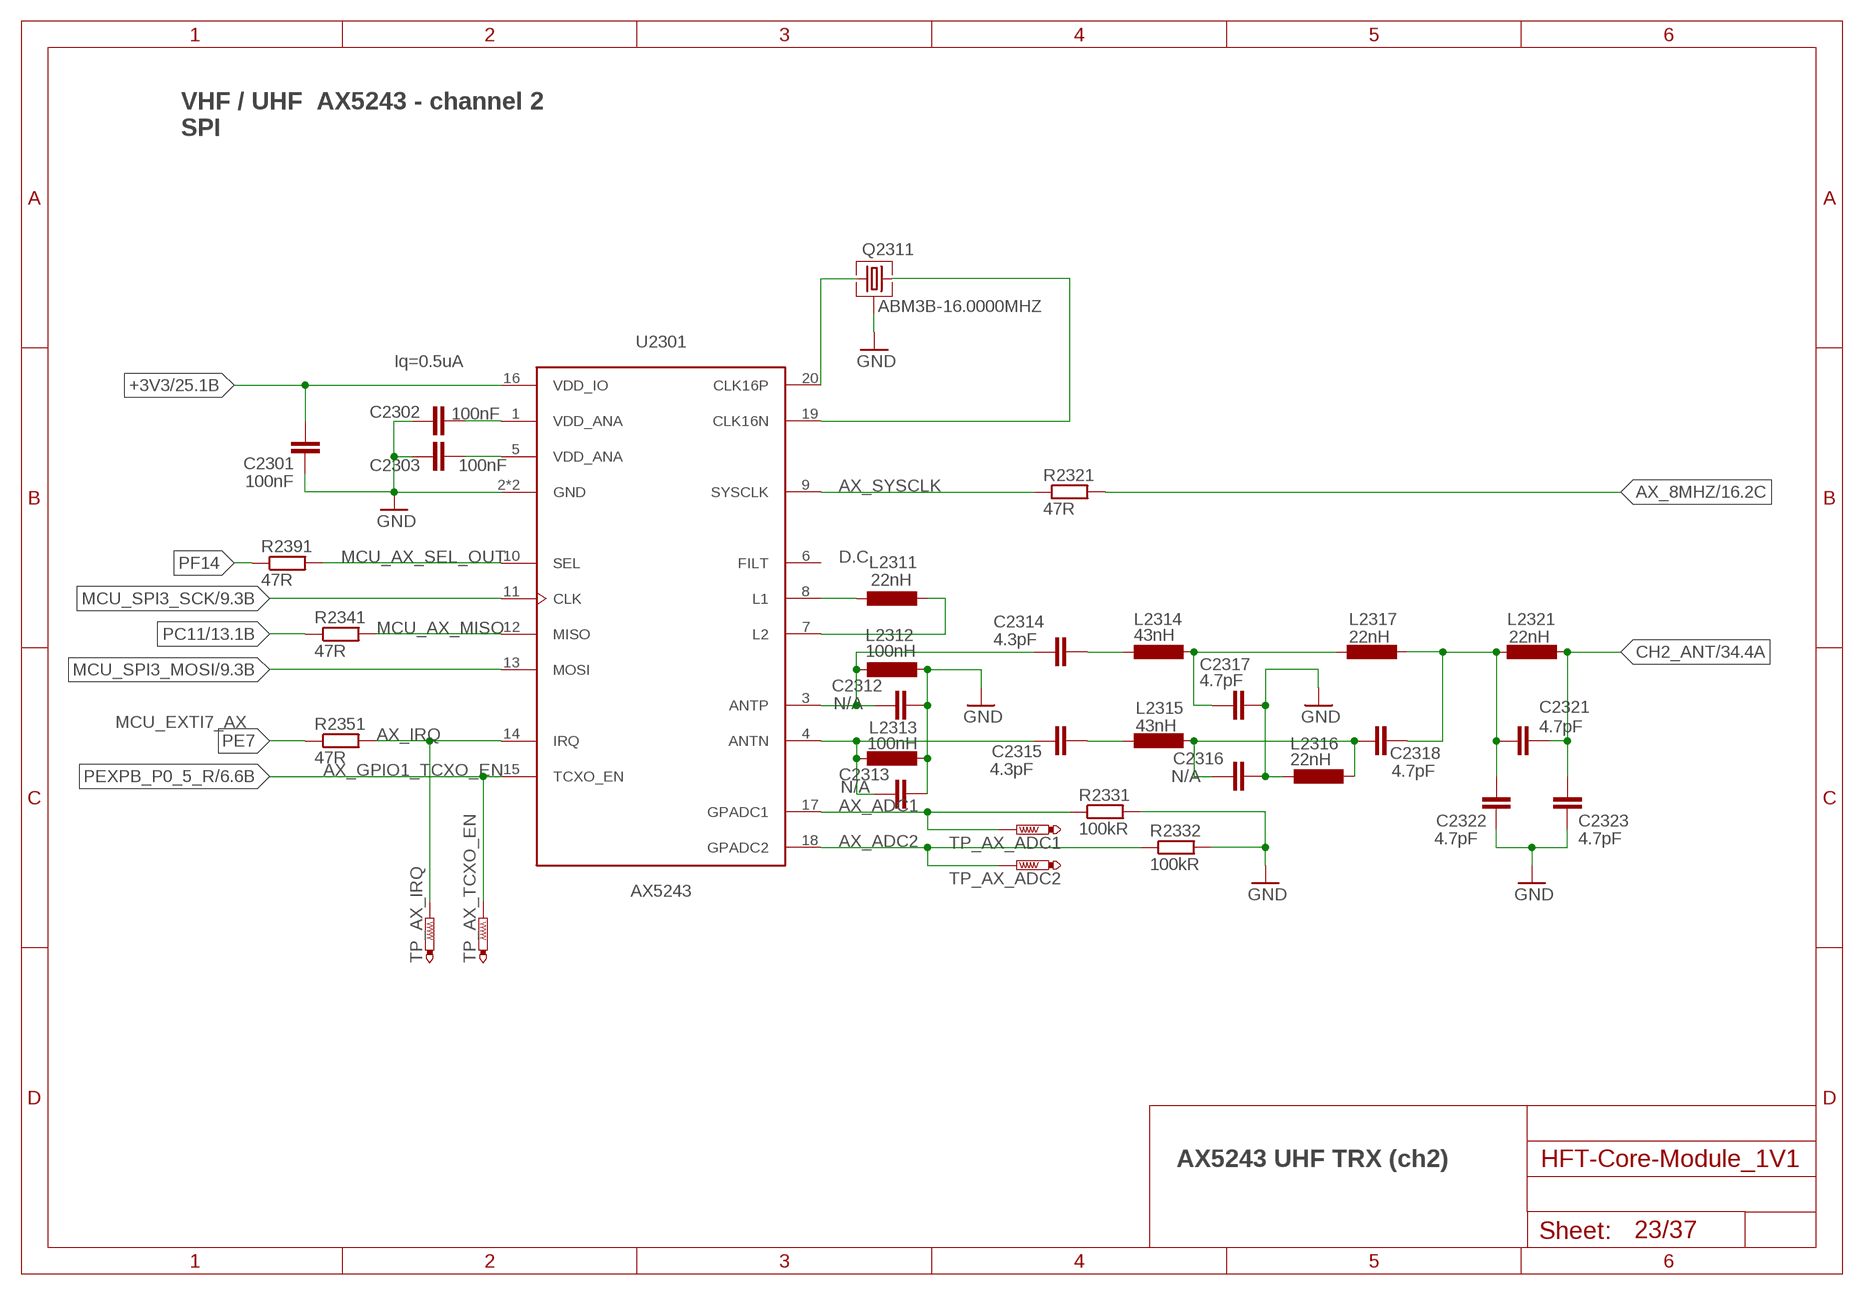
[diagram p22: schematic, sheet 23]

### Parts
C2301  100nF  C-EUC0402  [C0402]
C2302  100nF  C-EUC0402  [C0402]
C2303  100nF  C-EUC0402  [C0402]
C2312  N/A  C-EUC0402  [C0402]
C2313  N/A  C-EUC0402  [C0402]
C2314  4.3pF  C-EUC0402  [C0402]
C2315  4.3pF  C-EUC0402  [C0402]
C2316  N/A  C-EUC0402  [C0402]
C2317  4.7pF  C-EUC0402  [C0402]
C2318  4.7pF  C-EUC0402  [C0402]
C2321  4.7pF  C-EUC0402  [C0402]
C2322  4.7pF  C-EUC0402  [C0402]
C2323  4.7pF  C-EUC0402  [C0402]
L2311  22nH  L-EUL0603  [L0603]
L2312  100nH  L-EUL0603  [L0603]
L2313  100nH  L-EUL0603  [L0603]
L2314  43nH  L-EUL0603  [L0603]
L2315  43nH  L-EUL0603  [L0603]
L2316  22nH  L-EUL0603  [L0603]
L2317  22nH  L-EUL0603  [L0603]
L2321  22nH  L-EUL0603  [L0603]
Q2311  ABM3B-16.0000MHZ  [ABM3B]
R2321  47R  R-EU_R0402  [R0402]
R2331  100kR  R-EU_R0402  [R0402]
R2332  100kR  R-EU_R0402  [R0402]
R2341  47R  R-EU_R0402  [R0402]
R2351  47R  R-EU_R0402  [R0402]
R2391  47R  R-EU_R0402  [R0402]
TP_AX_ADC1  PTR1TP06R  [TP06R]
TP_AX_ADC2  PTR1TP06R  [TP06R]
TP_AX_IRQ  PTR1TP06R  [TP06R]
TP_AX_TCXO_EN  PTR1TP06R  [TP06R]
U2301  AX5243  [QFN20-4X4-0P5-PAD]

### Nets
+3V3: C2301.1 U2301.16(VDD_IO) ; also sheet 2,4,5,6,7,8,9,10,11,13,14,15,22,25,26,27,28,30,31,34,36
AX_8MHZ: R2321.2 ; also sheet 16
AX_ADC1: R2331.1 TP_AX_ADC1.TP U2301.17(GPADC1)
AX_ADC2: R2332.1 TP_AX_ADC2.TP U2301.18(GPADC2)
AX_ANTN: C2313.1 C2315.1 L2313.1 U2301.4(ANTN)
AX_ANTP: C2312.1 C2314.1 L2312.1 U2301.3(ANTP)
AX_B1: C2317.1 L2314.2 L2317.1
AX_B2: C2316.1 C2318.1 L2315.2 L2316.2
AX_CLK16A: Q2311.1 U2301.20(CLK16P)
AX_CLK16B: Q2311.3 U2301.19(CLK16N)
AX_COMB: C2318.2 C2321.1 C2322.1 L2317.2 L2321.1
AX_IRQ: R2351.2 TP_AX_IRQ.TP U2301.14(IRQ)
AX_L1: L2311.1 U2301.8(L1)
AX_L2: L2311.2 U2301.7(L2)
AX_SYSCLK: R2321.1 U2301.9(SYSCLK)
AX_T1: C2314.2 L2314.1
AX_T2: C2315.2 L2315.1
AX_VDD1: C2302.2 U2301.1(VDD_ANA)
AX_VDD5: C2303.2 U2301.5(VDD_ANA)
CH2_ANT: C2321.2 C2323.1 L2321.2 ; also sheet 34
GND: C2301.2 C2302.1 C2303.1 C2312.2 C2313.2 C2316.2 C2317.2 C2322.2 C2323.2 L2312.2 L2313.2 L2316.1 Q2311.2 Q2311.4 R2331.2 R2332.2 U2301.2(GND) U2301.21(GND) ; also sheet 1,2,3,4,5,6,7,8,9,10,11,12,13,14,15,16,17,18,19,21,22,24,25,26,27,28,29,30,31,32,33,34,35,36,37
MCU_AX_MISO: R2341.2 U2301.12(MISO)
MCU_AX_SEL_OUT: R2391.2 U2301.10(SEL)
MCU_SPI3_MOSI: U2301.13(MOSI) ; also sheet 9,13,22
MCU_SPI3_SCK: U2301.11(CLK) ; also sheet 9,13,22
PC11: R2341.1 ; also sheet 1,13,22
PE7: R2351.1 ; also sheet 1
PEXPB_P0_5_R: TP_AX_TCXO_EN.TP U2301.15(TCXO_EN) ; also sheet 6
PF14: R2391.1 ; also sheet 1
Unconnected: U2301.6(FILT)

### Notes on the sheet
- VHF / UHF  AX5243 - channel 2
  SPI
- Iq=0.5uA
- D.C.
- MCU_EXTI7_AX
- AX_GPIO1_TCXO_EN
- AX5243 UHF TRX (ch2)

## Sheet 24 of 37: 12V Down-Converter
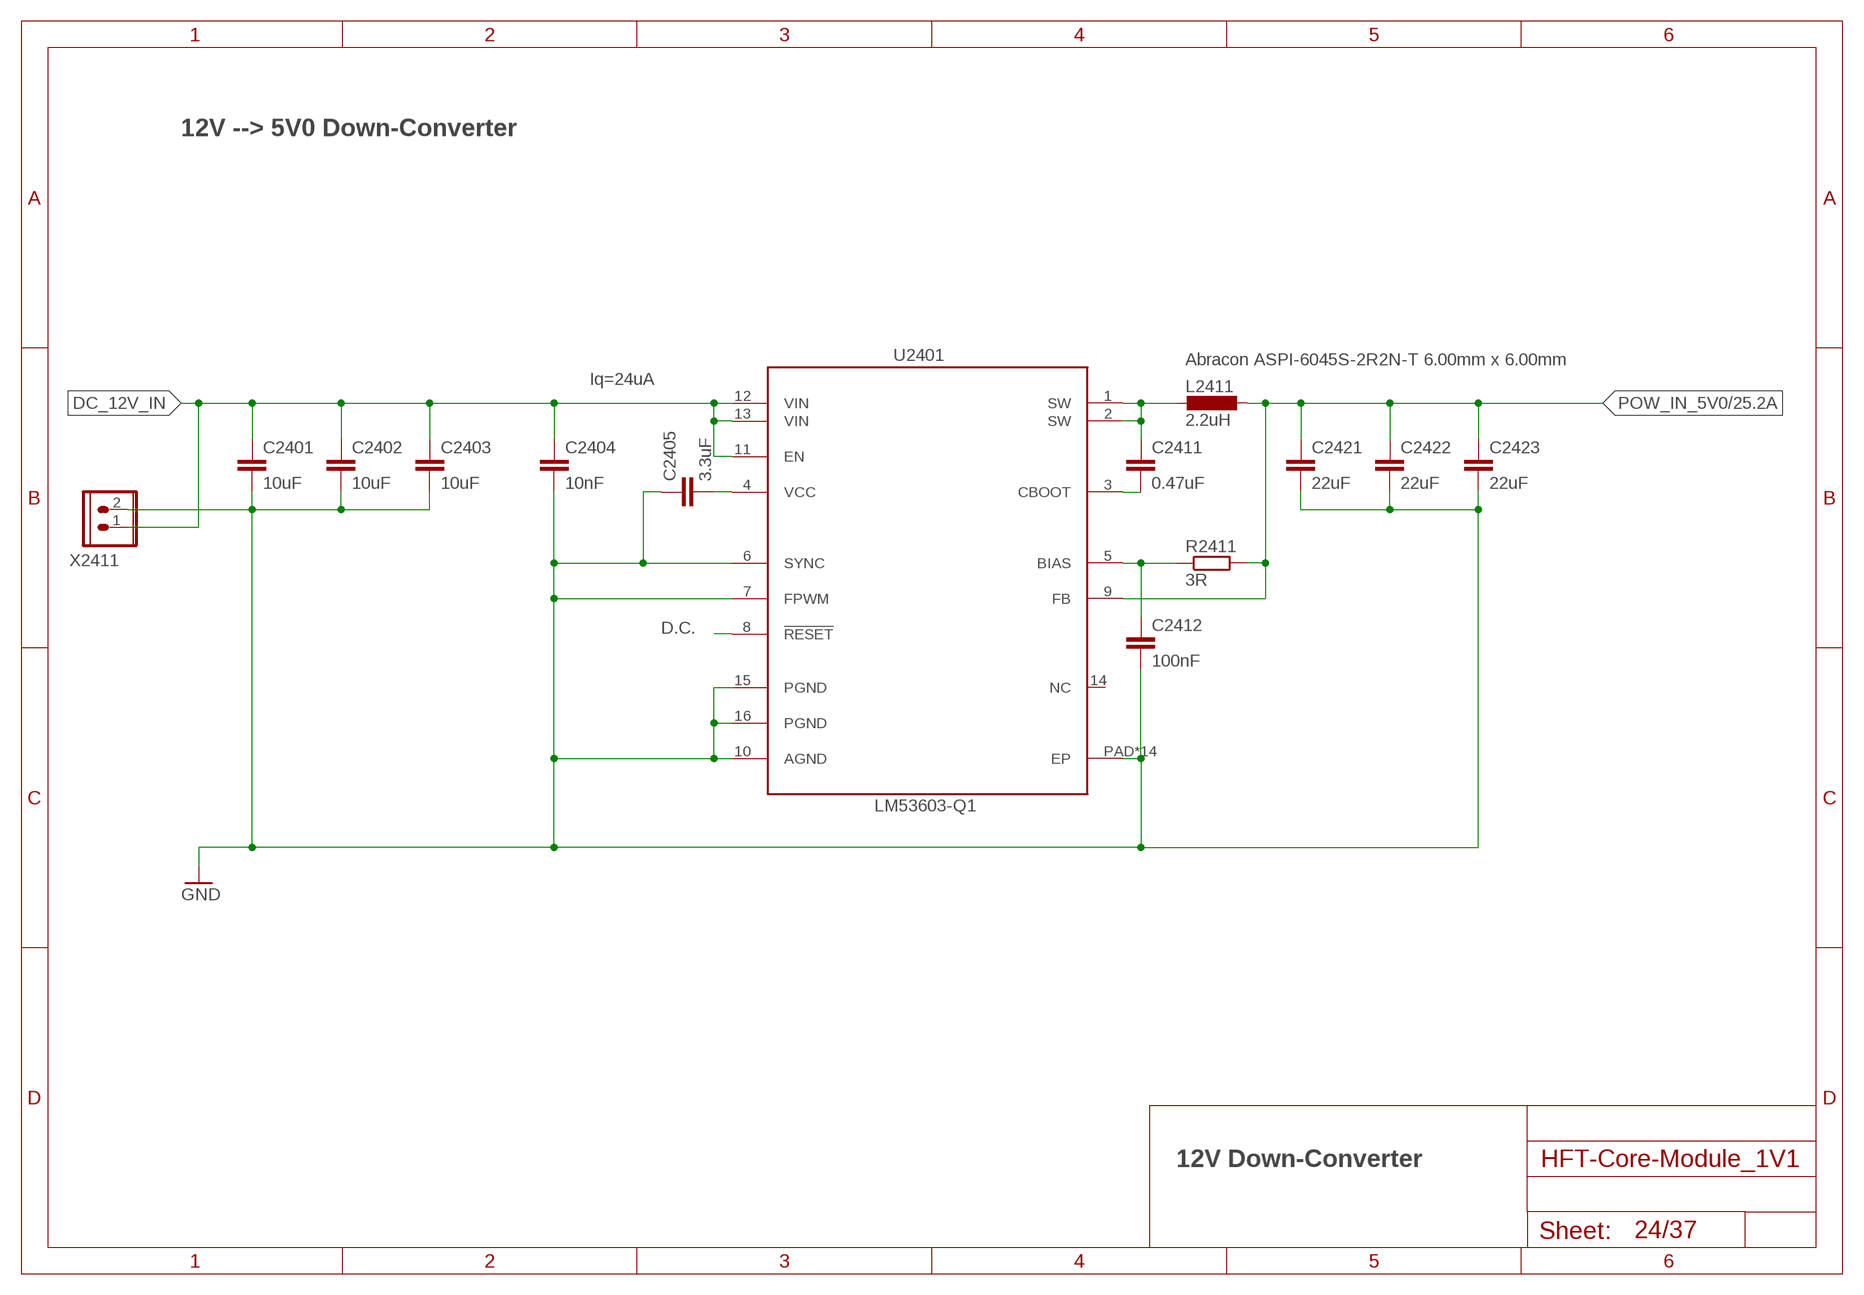
[diagram p23: schematic, sheet 24]

### Parts
C2401  10uF  C-EUC0402  [C0402]
C2402  10uF  C-EUC0402  [C0402]
C2403  10uF  C-EUC0402  [C0402]
C2404  10nF  C-EUC0402  [C0402]
C2405  3.3uF  C-EUC0402  [C0402]
C2411  0.47uF  C-EUC0402  [C0402]
C2412  100nF  C-EUC0402  [C0402]
C2421  22uF  C-EUC0402  [C0402]
C2422  22uF  C-EUC0402  [C0402]
C2423  22uF  C-EUC0402  [C0402]
L2411  2.2uH  L-EU6.00X6.00MM  [L_6.00MM_X_6.00MM]
R2411  3R  R-EU_R0402  [R0402]
U2401  LM53603-Q1  [HTSSOP16]
X2411  WIRE-TO-BOARD_5MM08_1X02  [WIRE-TO-BOARD_5MM08_1X02]

### Nets
DC_12V_IN: C2401.1 C2402.1 C2403.1 C2404.1 U2401.11(EN) U2401.12(VIN) U2401.13(VIN) X2411.1
GND: C2401.2 C2402.2 C2403.2 C2404.2 C2405.1 C2412.2 C2421.2 C2422.2 C2423.2 U2401.6(SYNC) U2401.7(FPWM) U2401.10(AGND) U2401.15(PGND) U2401.16(PGND) U2401.PAD1(EP) U2401.PAD2(EP) U2401.PAD3(EP) U2401.PAD4(EP) U2401.PAD5(EP) U2401.PAD6(EP) U2401.PAD7(EP) U2401.PAD8(EP) U2401.PAD9(EP) U2401.PAD10(EP) U2401.PAD11(EP) U2401.PAD12(EP) U2401.PAD13(EP) U2401.PAD(EP) X2411.2 ; also sheet 1,2,3,4,5,6,7,8,9,10,11,12,13,14,15,16,17,18,19,21,22,23,25,26,27,28,29,30,31,32,33,34,35,36,37
LM53603_!RESET: U2401.8(!RESET)
LM53603_BIAS: C2412.1 R2411.1 U2401.5(BIAS)
LM53603_CBOOT: C2411.2 U2401.3(CBOOT)
LM53603_SW: C2411.1 L2411.2 U2401.1(SW) U2401.2(SW)
LM53603_VCC: C2405.2 U2401.4(VCC)
POW_IN_5V0: C2421.1 C2422.1 C2423.1 L2411.1 R2411.2 U2401.9(FB) ; also sheet 25
Unconnected: U2401.14(NC)

### Notes on the sheet
- 12V --> 5V0 Down-Converter
- Abracon ASPI-6045S-2R2N-T 6.00mm x 6.00mm
- Iq=24uA
- D.C.
- 12V Down-Converter